# Altium project H3_PROTOTYPE_DDR3_16X2_V3_0_20141113.PrjPcb (part 1 of 2)
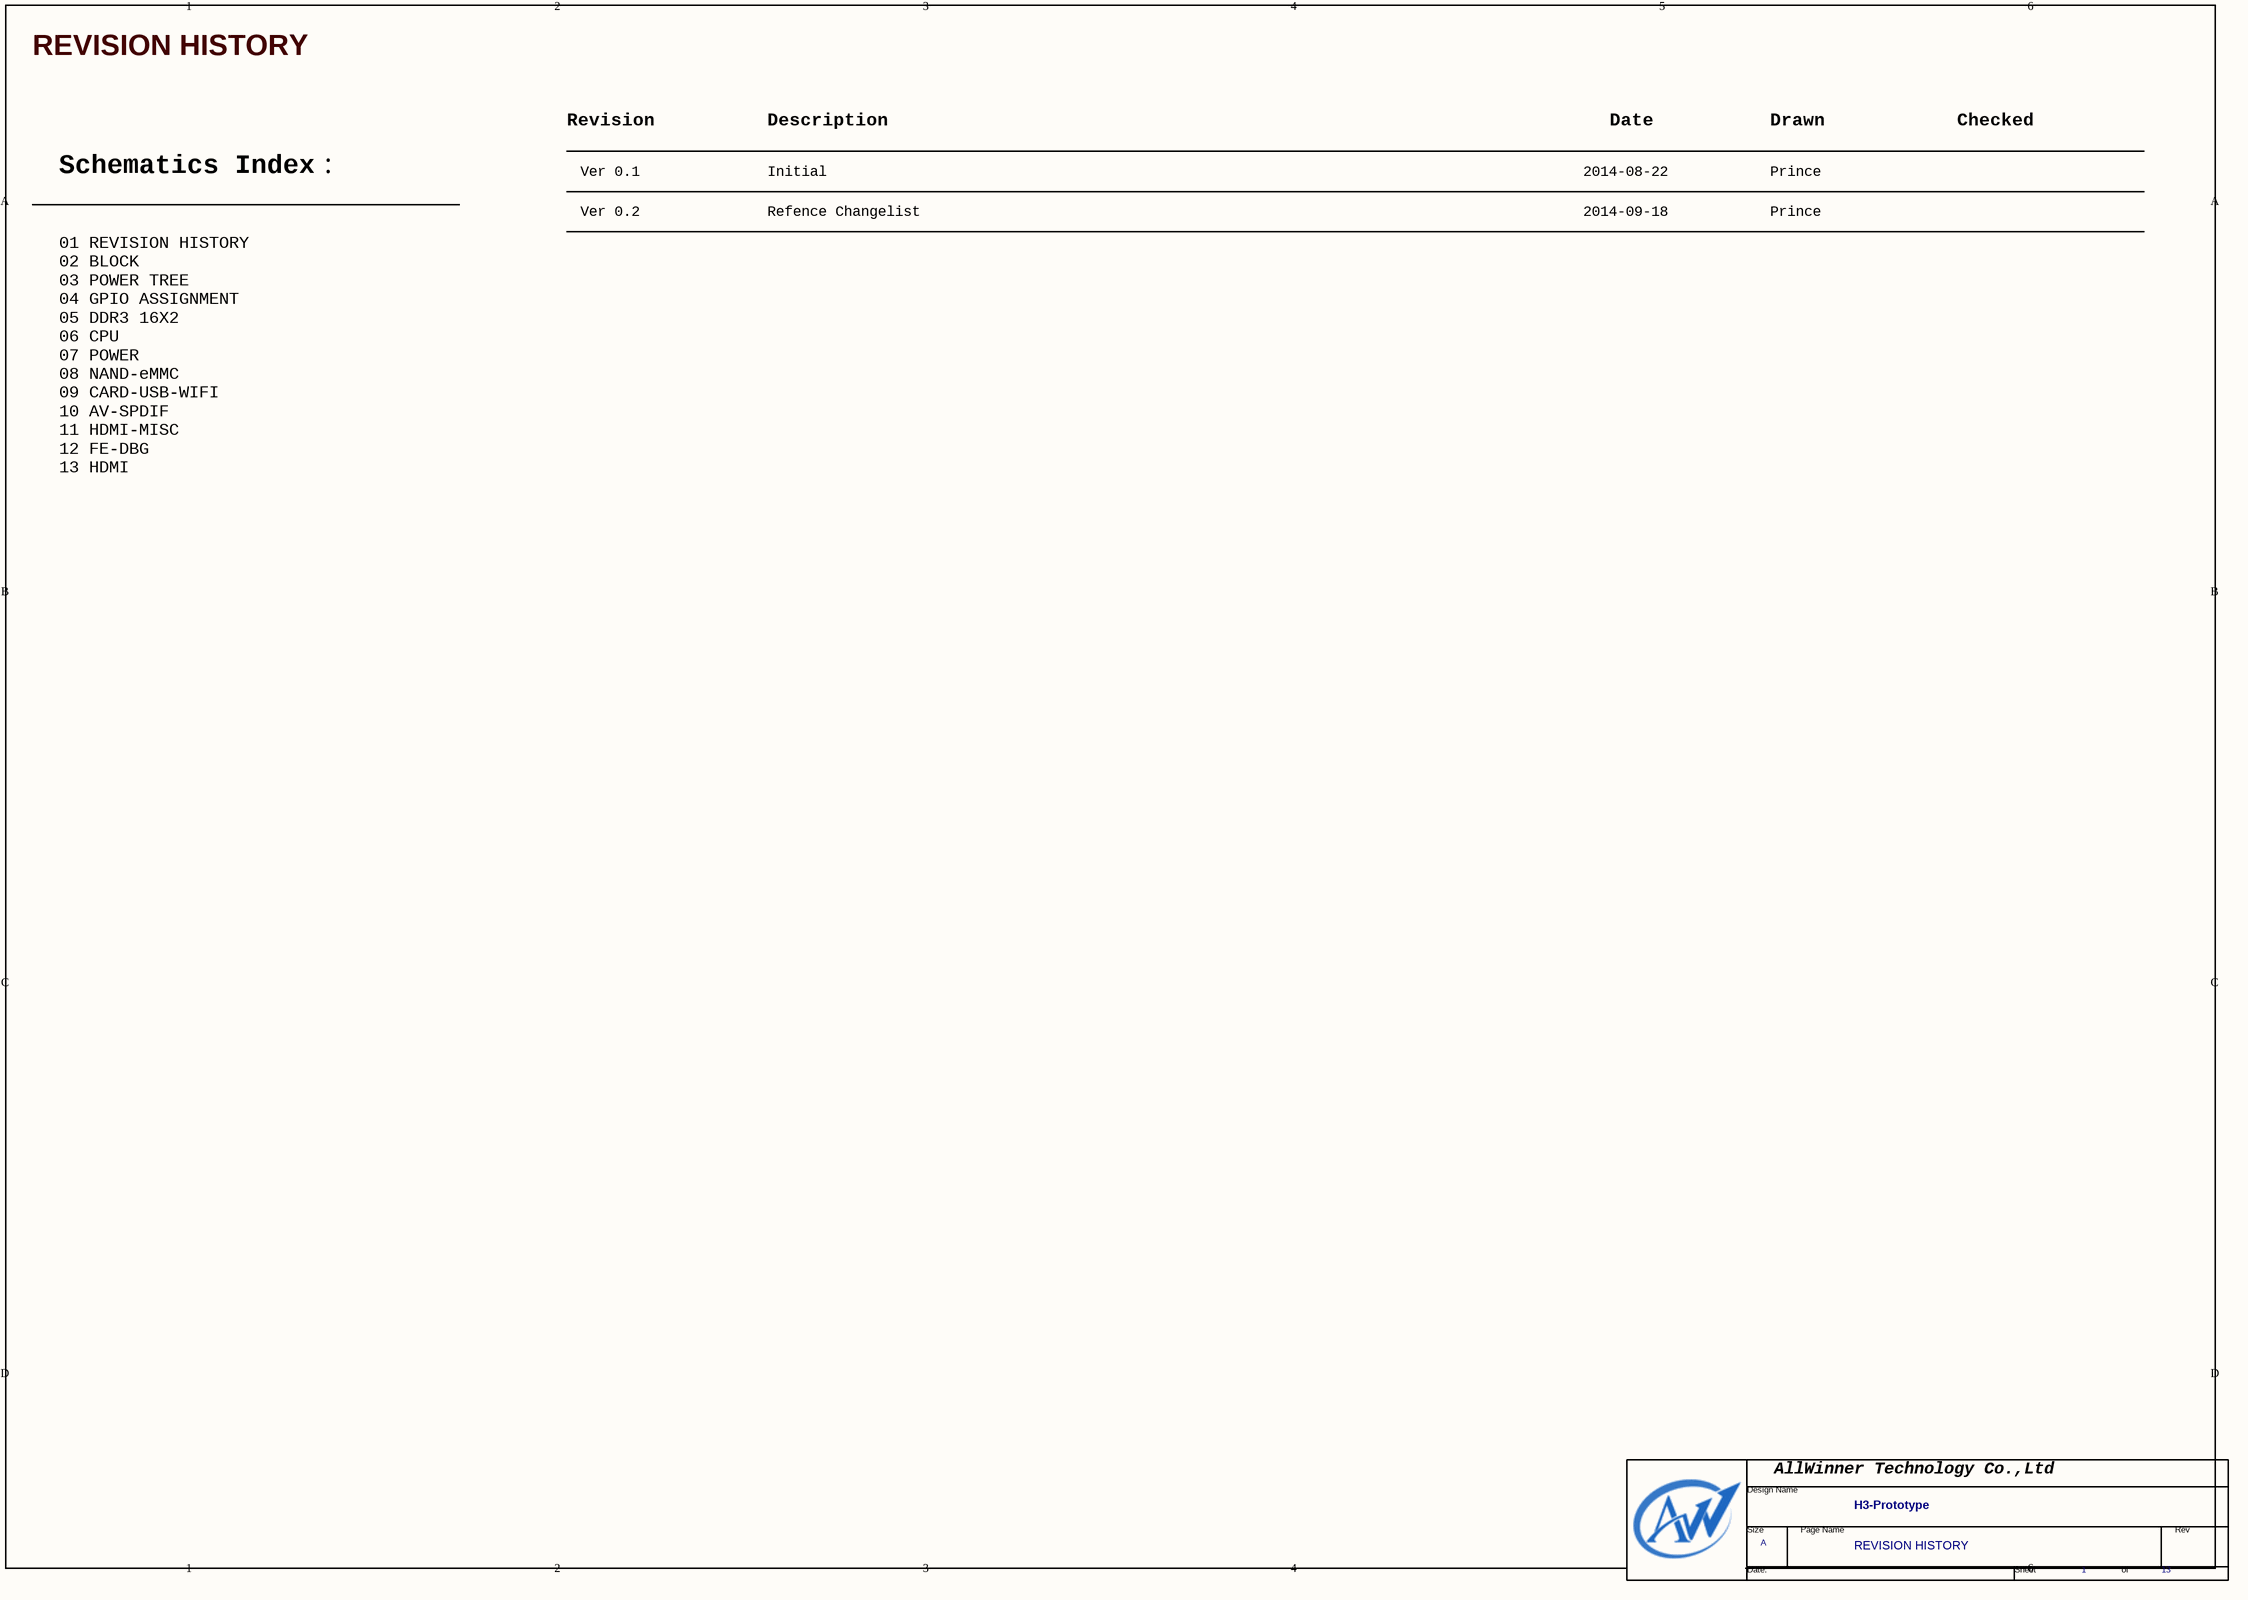
[diagram p0: 01 REVISION HISTORY.SchDoc]
13 sheets, 383 parts. Net scope: global (net labels, ports and power ports of the same name join across sheets).
Sheets:
  01 REVISION HISTORY.SchDoc
  02 BLOCK.SchDoc
  03 POWER TREE.SchDoc
  04 GPIO ASSIGNMENT.SchDoc
  05 DDR3 16X2.SchDoc
  06 CPU.SchDoc
  07 POWER.SchDoc
  08 NAND-eMMC.SchDoc
  09 CARD-USB-WIFI.SchDoc
  10 AV-SPDIF.SchDoc
  11 MISC.SchDoc
  12 FE-DBG.SchDoc
  13 HDMI.SchDoc

## Sheet 01 REVISION HISTORY.SchDoc
size 420 x 297 mm

### Parts
(Parts that share a designator on the sheet are numbered #1, #2 ... from top to bottom, then left to right.)
*#1  Page Count: 13  Page Number: 1  Page Size: A  Title: H3-Prototype  Doc: REVISION HISTORY  (hidden comment: TitleBlock0-AW)  (graphical)

### Notes on the sheet
- REVISION HISTORY
- Revision
- Description
- Date
- Drawn
- Checked
- Schematics Index：
- Ver 0.1
- Initial
- 2014-08-22
- Prince
- 01 REVISION HISTORY
  02 BLOCK
  03 POWER TREE
  04 GPIO ASSIGNMENT
  05 DDR3 16X2
  06 CPU
  07 POWER
  08 NAND-eMMC
  09 CARD-USB-WIFI
  10 AV-SPDIF
  11 HDMI-MISC
  12 FE-DBG
  13 HDMI
- Ver 0.2
- Refence Changelist
- 2014-09-18
- (in symbol TitleBlock0-AW) AllWinner Technology Co.,Ltd; Design Name; Size; Page Name; Rev; Date:; Sheet; of

### Library data of the parts
*#1 = TitleBlock0-AW: RevCode: 0.1; Page Create Date: March  8, 1995

## Sheet 02 BLOCK.SchDoc
size 420 x 297 mm
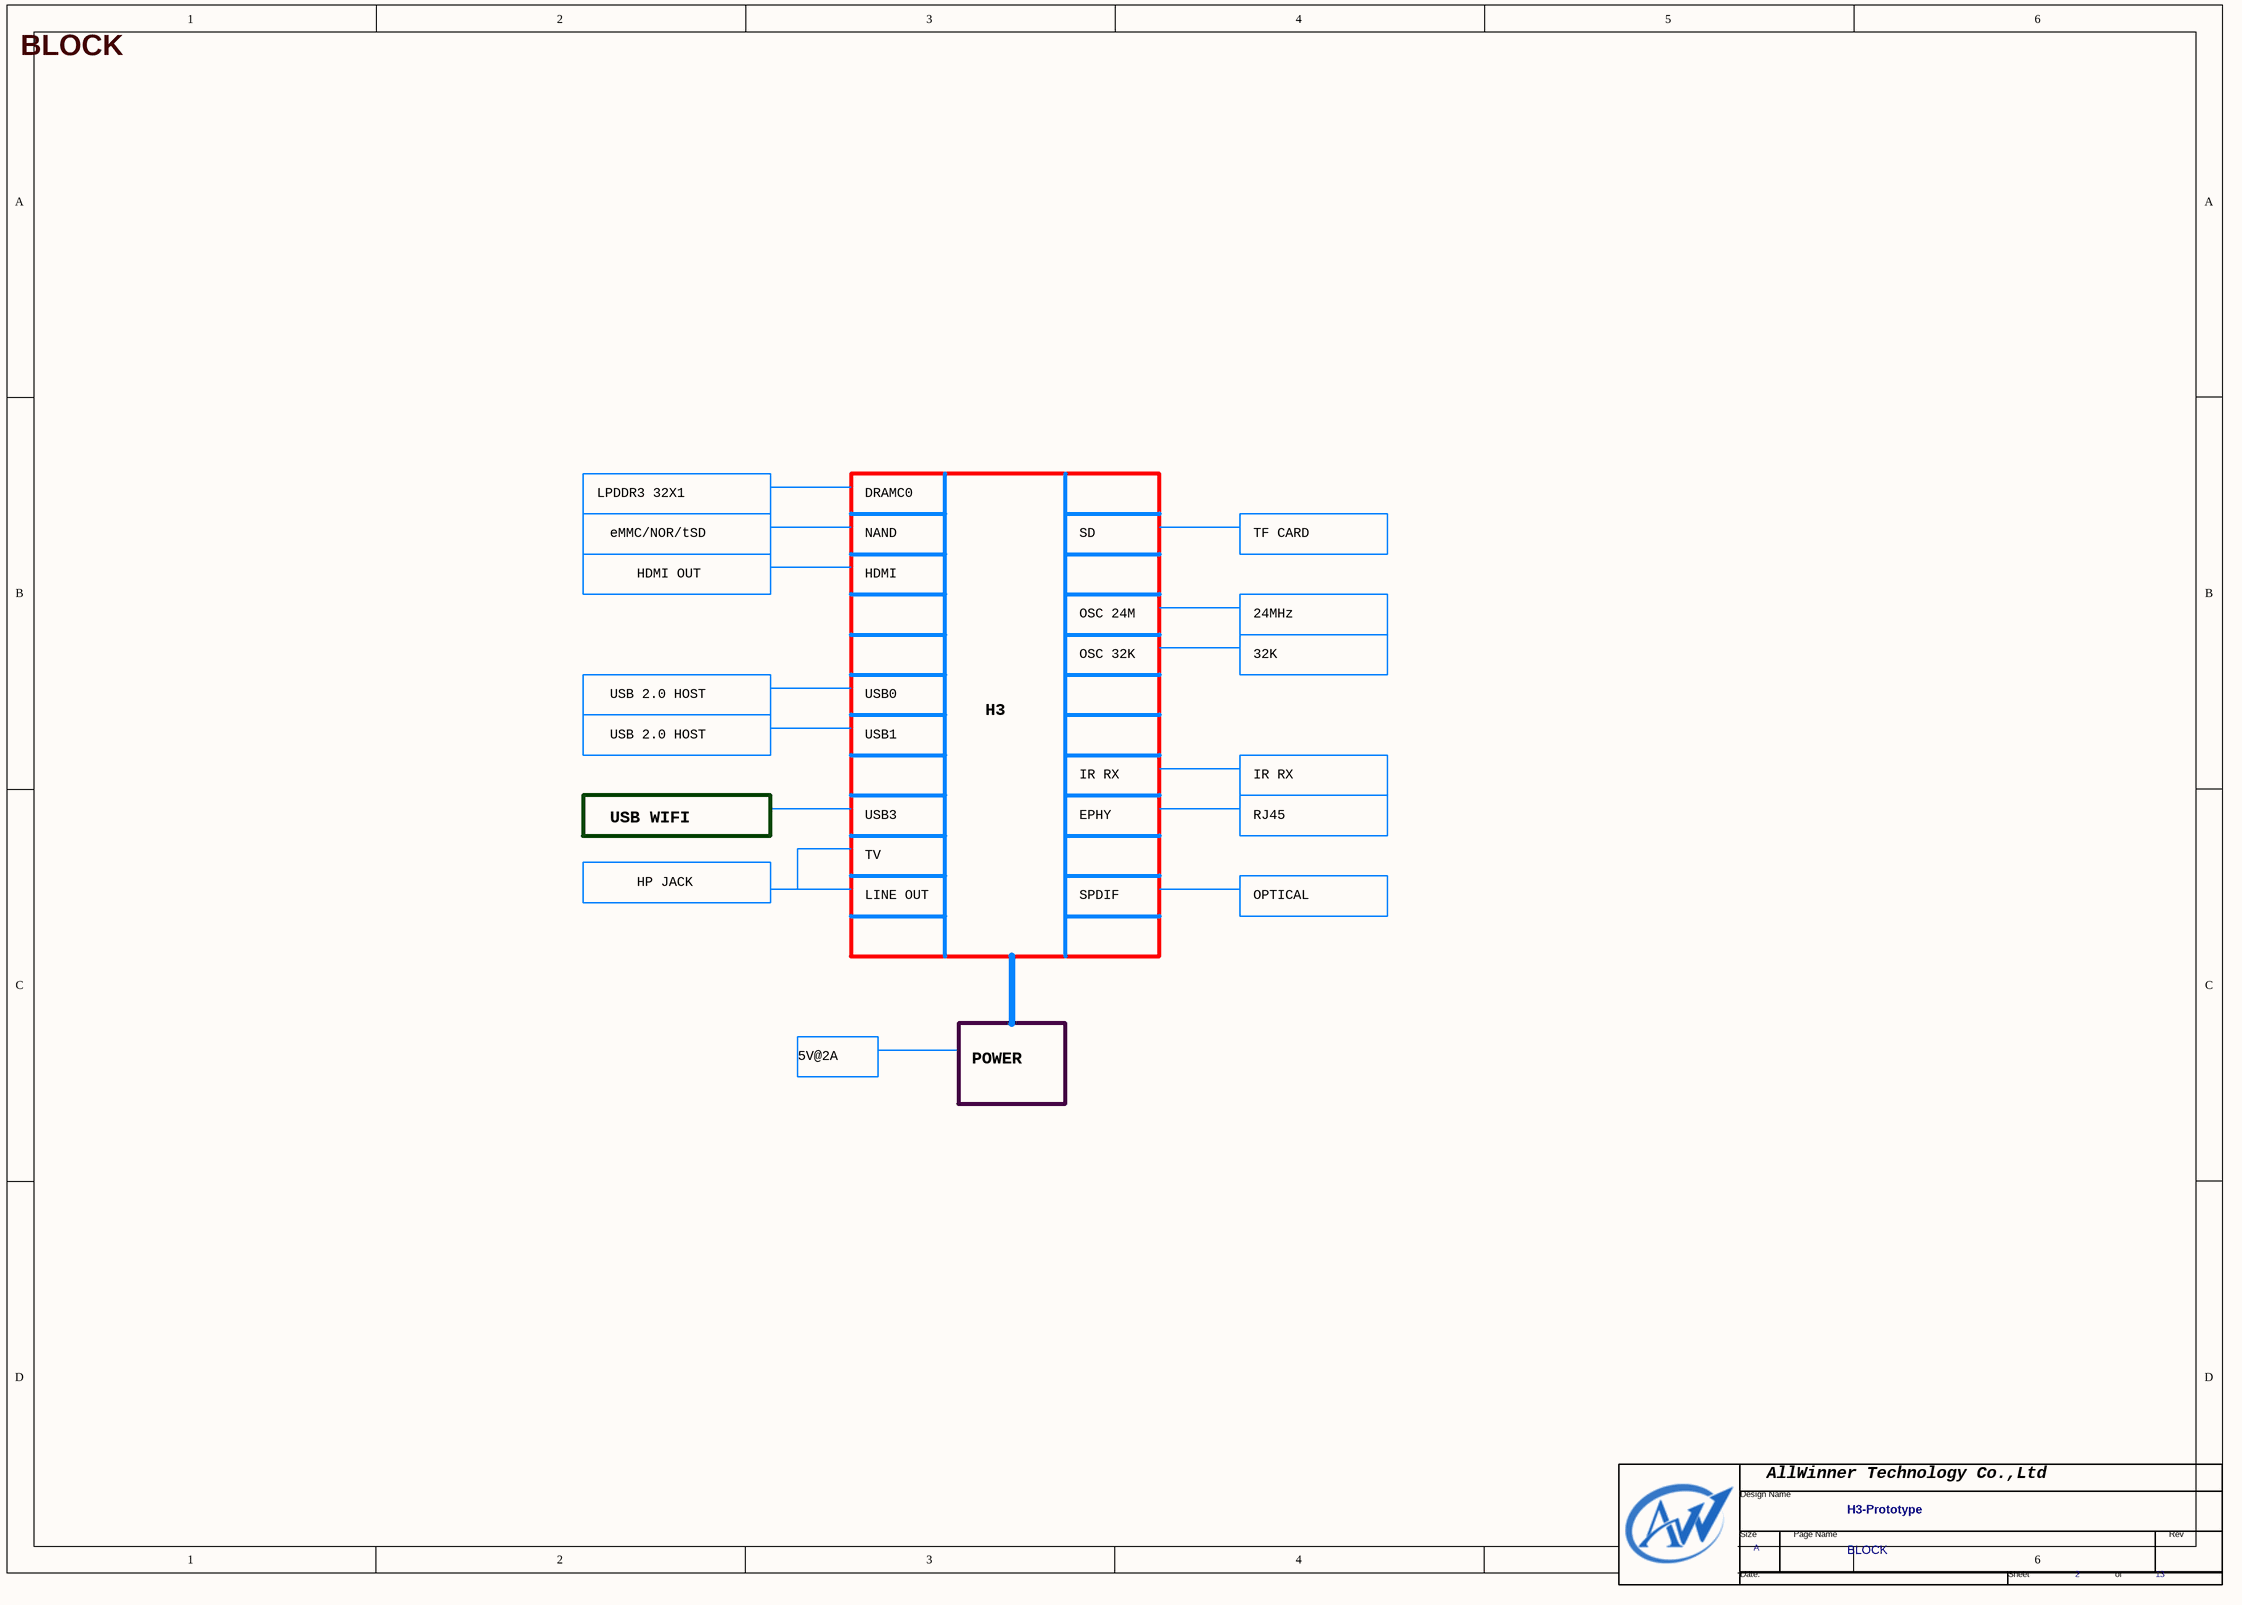
[diagram p1: 02 BLOCK.SchDoc]

### Parts
(Parts that share a designator on the sheet are numbered #1, #2 ... from top to bottom, then left to right.)
*#2  Page Count: 13  Page Number: 2  Page Size: A  Title: H3-Prototype  Doc: BLOCK  (hidden comment: TitleBlock0-AW)  (graphical)

### Notes on the sheet
- BLOCK
- LPDDR3 32X1
- DRAMC0
- eMMC/NOR/tSD
- HDMI OUT
- NAND
- HDMI
- SD
- TF CARD
- OSC 24M
- OSC 32K
- 24MHz
- 32K
- USB 2.0 HOST
- USB0
- H3
- USB1
- IR RX
- USB WIFI
- USB3
- TV
- EPHY
- RJ45
- HP JACK
- LINE OUT
- SPDIF
- OPTICAL
- 5V@2A
- POWER
- (in symbol TitleBlock0-AW) AllWinner Technology Co.,Ltd; Design Name; Size; Page Name; Rev; Date:; Sheet; of

### Library data of the parts
*#2 = TitleBlock0-AW: Page Create Date: March  8, 1995

## Sheet 03 POWER TREE.SchDoc
size 420 x 297 mm
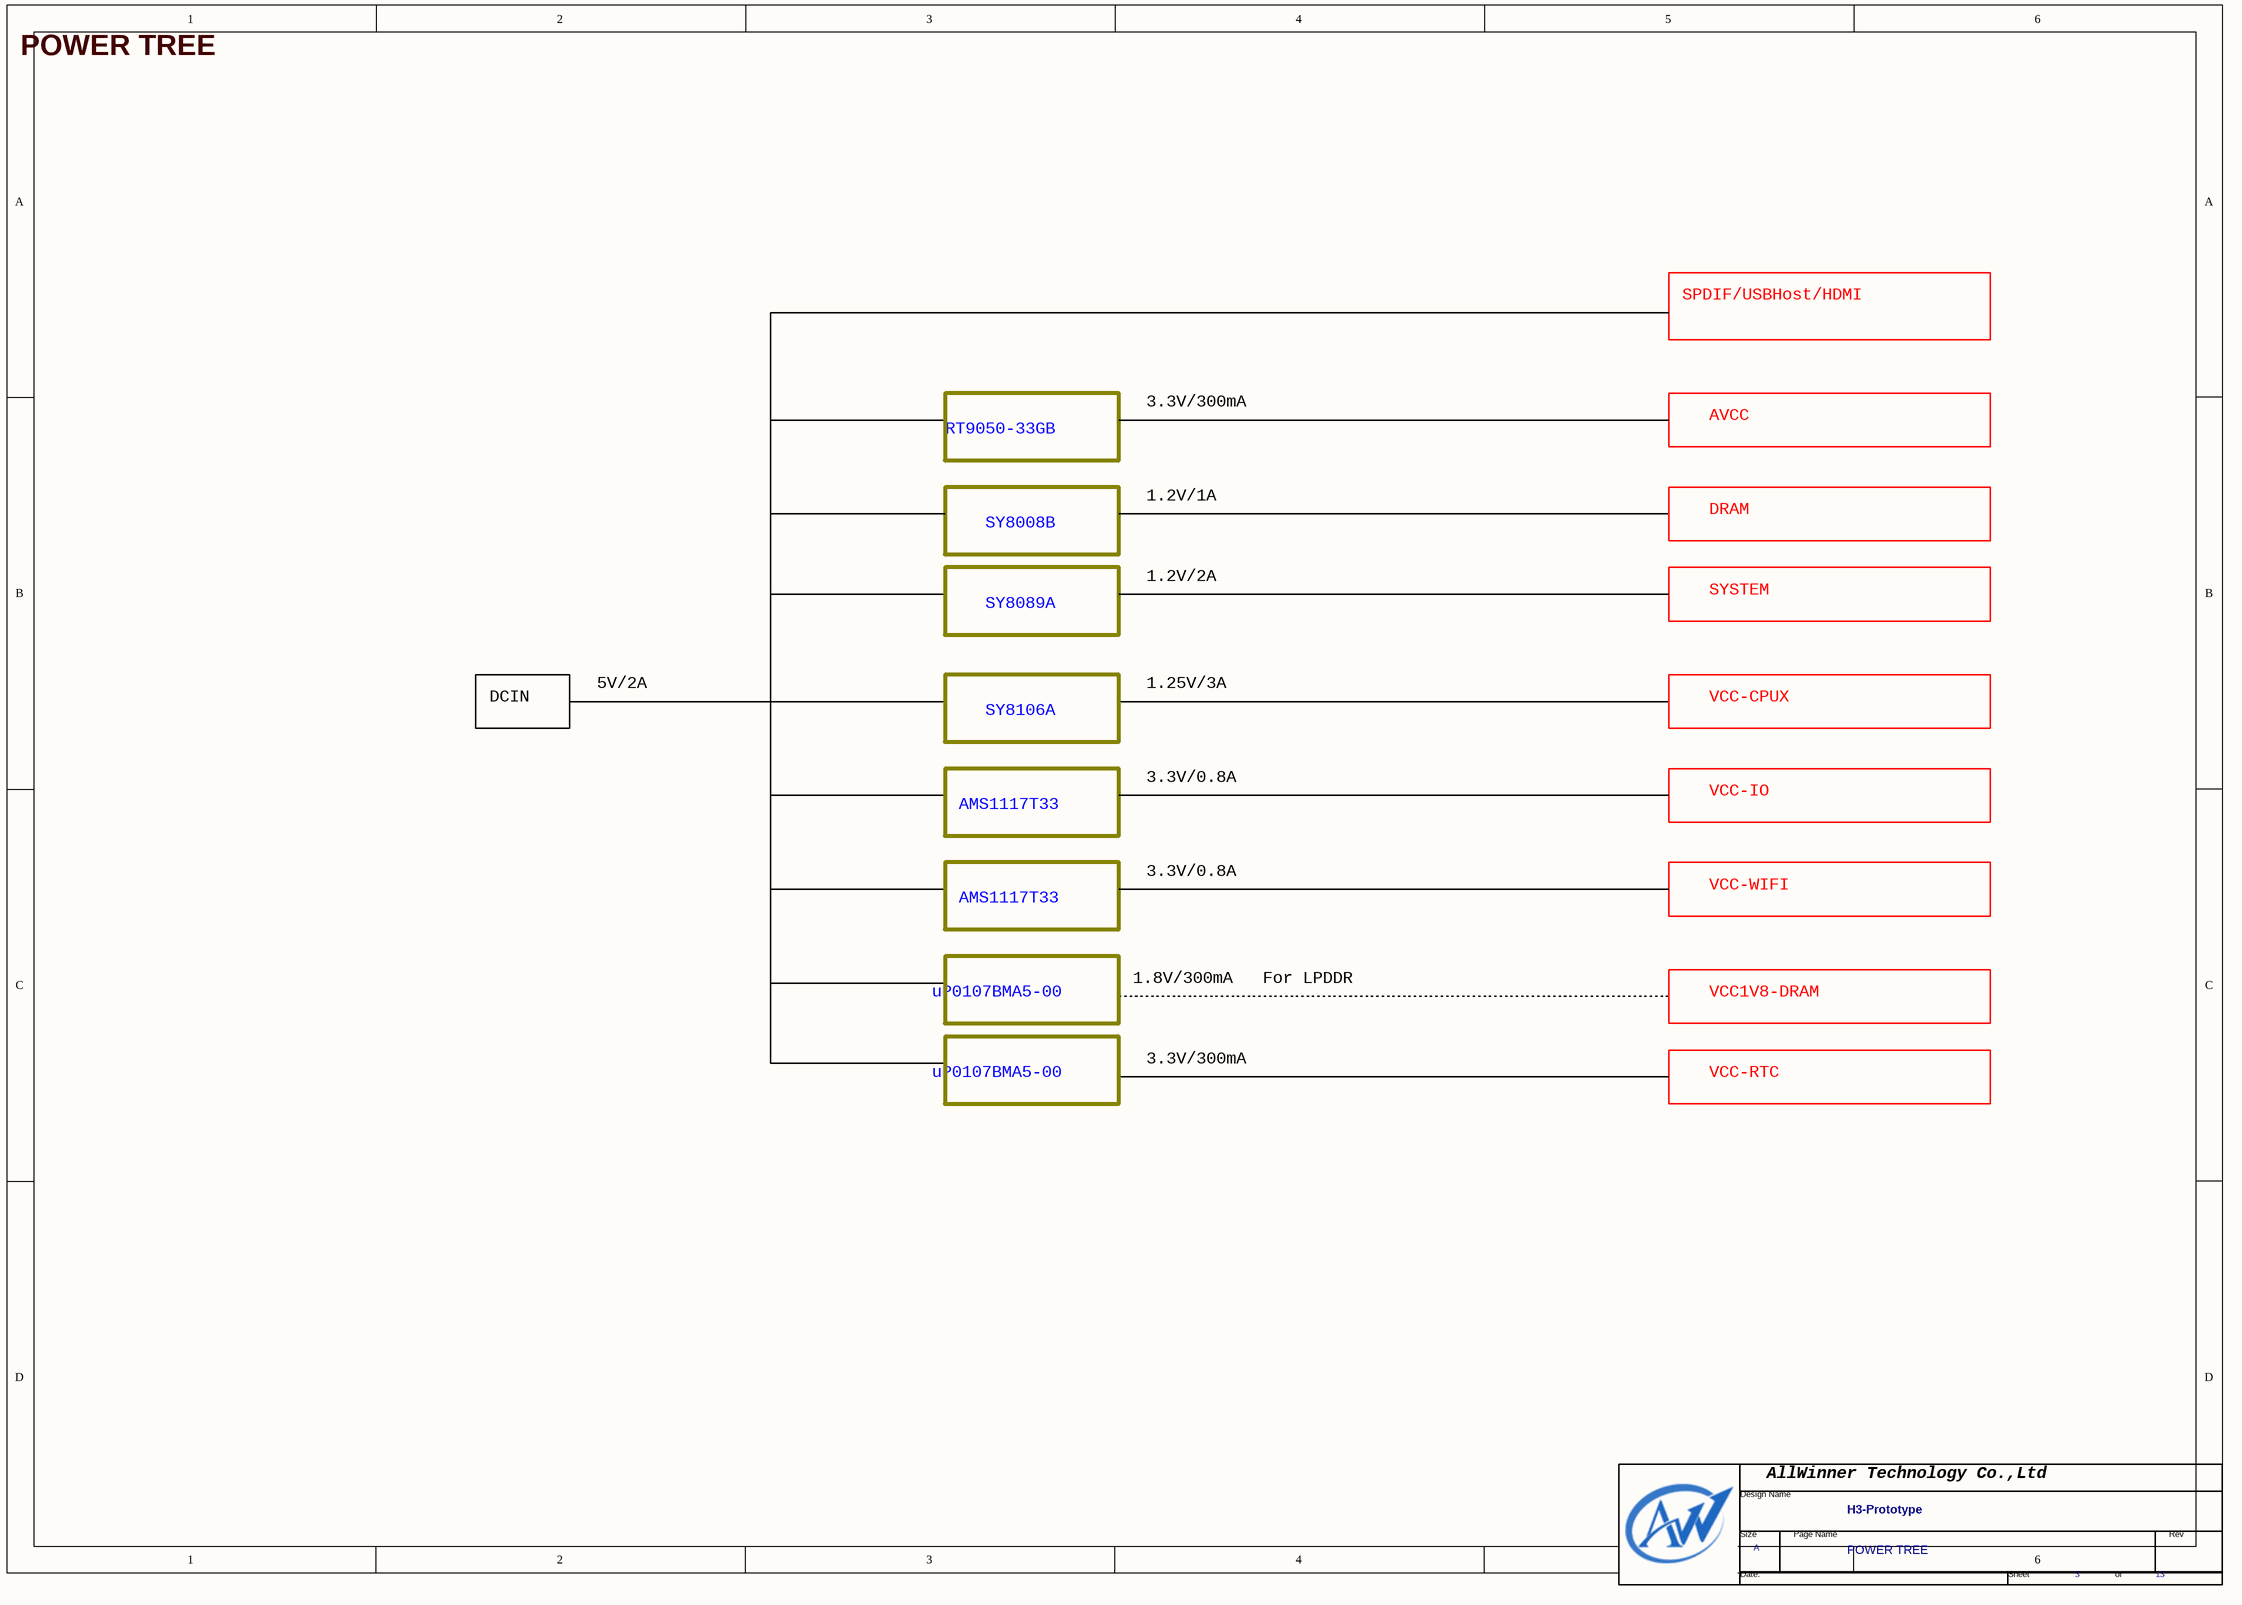
[diagram p2: 03 POWER TREE.SchDoc]

### Parts
(Parts that share a designator on the sheet are numbered #1, #2 ... from top to bottom, then left to right.)
*#3  Page Count: 13  Page Number: 3  Page Size: A  Title: H3-Prototype  Doc: POWER TREE  (hidden comment: TitleBlock0-AW)  (graphical)

### Notes on the sheet
- POWER TREE
- SPDIF/USBHost/HDMI
- RT9050-33GB
- 3.3V/300mA
- AVCC
- SY8008B
- 1.2V/1A
- DRAM
- 1.2V/2A
- SYSTEM
- SY8089A
- DCIN
- 5V/2A
- SY8106A
- 1.25V/3A
- VCC-CPUX
- 3.3V/0.8A
- VCC-IO
- AMS1117T33
- VCC-WIFI
- uP0107BMA5-00
- 1.8V/300mA   For LPDDR
- VCC1V8-DRAM
- VCC-RTC
- (in symbol TitleBlock0-AW) AllWinner Technology Co.,Ltd; Design Name; Size; Page Name; Rev; Date:; Sheet; of

### Library data of the parts
*#3 = TitleBlock0-AW: Page Create Date: March  8, 1995

## Sheet 04 GPIO ASSIGNMENT.SchDoc
size 420 x 297 mm
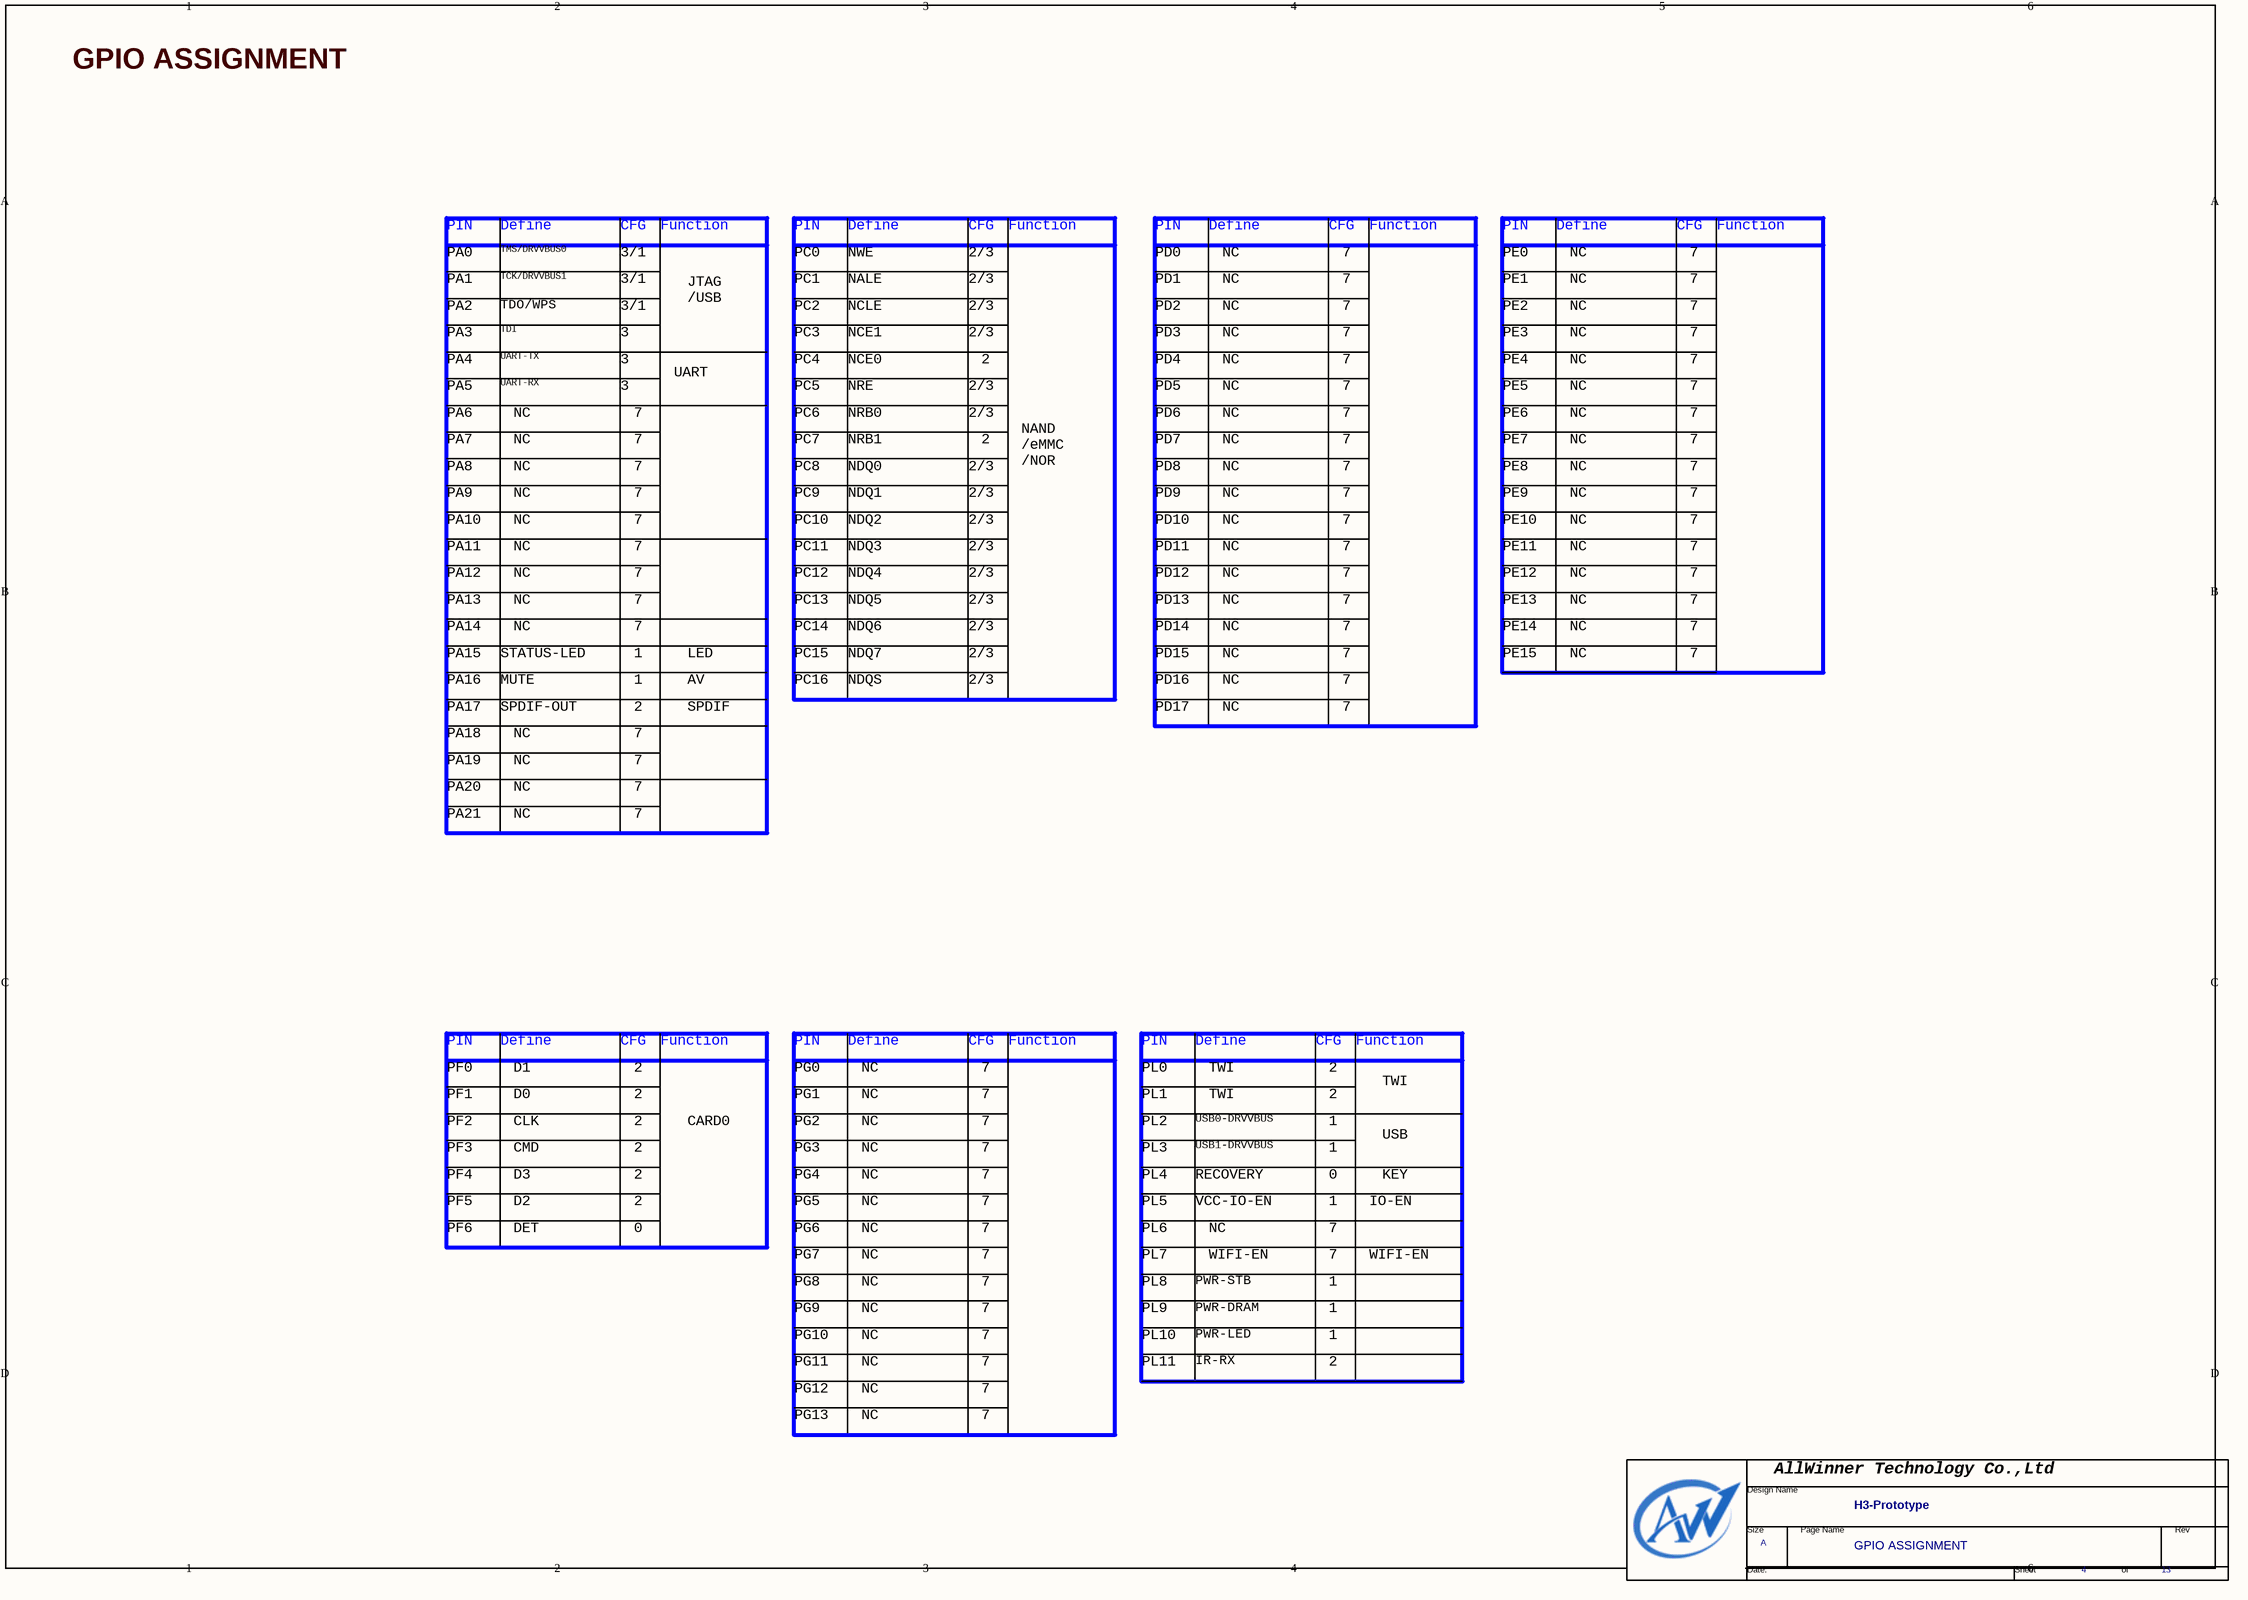
[diagram p3: 04 GPIO ASSIGNMENT.SchDoc]

### Parts
(Parts that share a designator on the sheet are numbered #1, #2 ... from top to bottom, then left to right.)
*#4  Page Count: 13  Page Number: 4  Page Size: A  Title: H3-Prototype  Doc: GPIO ASSIGNMENT  (hidden comment: TitleBlock0-AW)  (graphical)

### Notes on the sheet
- GPIO ASSIGNMENT
- PIN
- PA0
- Define
- TMS/DRVVBUS0
- CFG
- 3/1
- Function
- PC0
- NWE
- 2/3
- PD0
- NC
- 7
- PE0
- PA1
- PA2
- TCK/DRVVBUS1
- TDO/WPS
- JTAG
  /USB
- PC1
- PC2
- NALE
- NCLE
- PD1
- PD2
- PE1
- PE2
- PA3
- PA4
- PA5
- TDI
- UART-TX
- UART-RX
- 3
- UART
- PC3
- PC4
- PC5
- NCE1
- NCE0
- NRE
- 2
- PD3
- PD4
- PD5
- PE3
- PE4
- PE5
- PA6
- PA7
- PC6
- PC7
- NRB0
- NRB1
- NAND
  /eMMC
  /NOR
- PD6
- PD7
- PE6
- PE7
- PA8
- PA9
- PA10
- PC8
- PC9
- PC10
- NDQ1
- NDQ2
- NDQ0
- PD8
- PD9
- PD10
- PE8
- PE9
- PE10
- PA11
- PA12
- PC11
- PC12
- NDQ3
- NDQ4
- PD11
- PD12
- PE11
- PE12
- PA13
- PA14
- PA15
- STATUS-LED
- 1
- LED
- PC13
- PC14
- PC15
- NDQ5
- NDQ6
- NDQ7
- PD13
- PD14
- PD15
- PE13
- PE14
- PE15
- PA16
- PA17
- SPDIF-OUT
- MUTE
- SPDIF
- AV
- PC16
- NDQS
- PD16
- PD17
- PA18
- PA19
- PA20
- PA21
- PF0
- PF1
- PF2
- D0
- D1
- CLK
- CARD0
- PG0
- PG1
- PG2
- PL0
- PL1
- PL2
- USB0-DRVVBUS
- TWI
- PF3
- PF4
- D3
- CMD
- PG3
- PG4
- PL3
- PL4
- RECOVERY
- USB1-DRVVBUS
- 0
- KEY
- USB
- PF6
- PF5
- D2
- DET
- PG5
- PG6
- PG7
- PL5
- PL6
- PL7
- VCC-IO-EN
- WIFI-EN
- IO-EN
- PG8
- PG9
- PL8
- PL9
- PWR-DRAM
- PWR-STB
- PG10
- PG11
- PG12
- PL10
- PL11
- IR-RX
- PWR-LED
- PG13
- (in symbol TitleBlock0-AW) AllWinner Technology Co.,Ltd; Design Name; Size; Page Name; Rev; Date:; Sheet; of

### Library data of the parts
*#4 = TitleBlock0-AW: Page Create Date: March  8, 1995

## Sheet 05 DDR3 16X2.SchDoc
size 420 x 297 mm
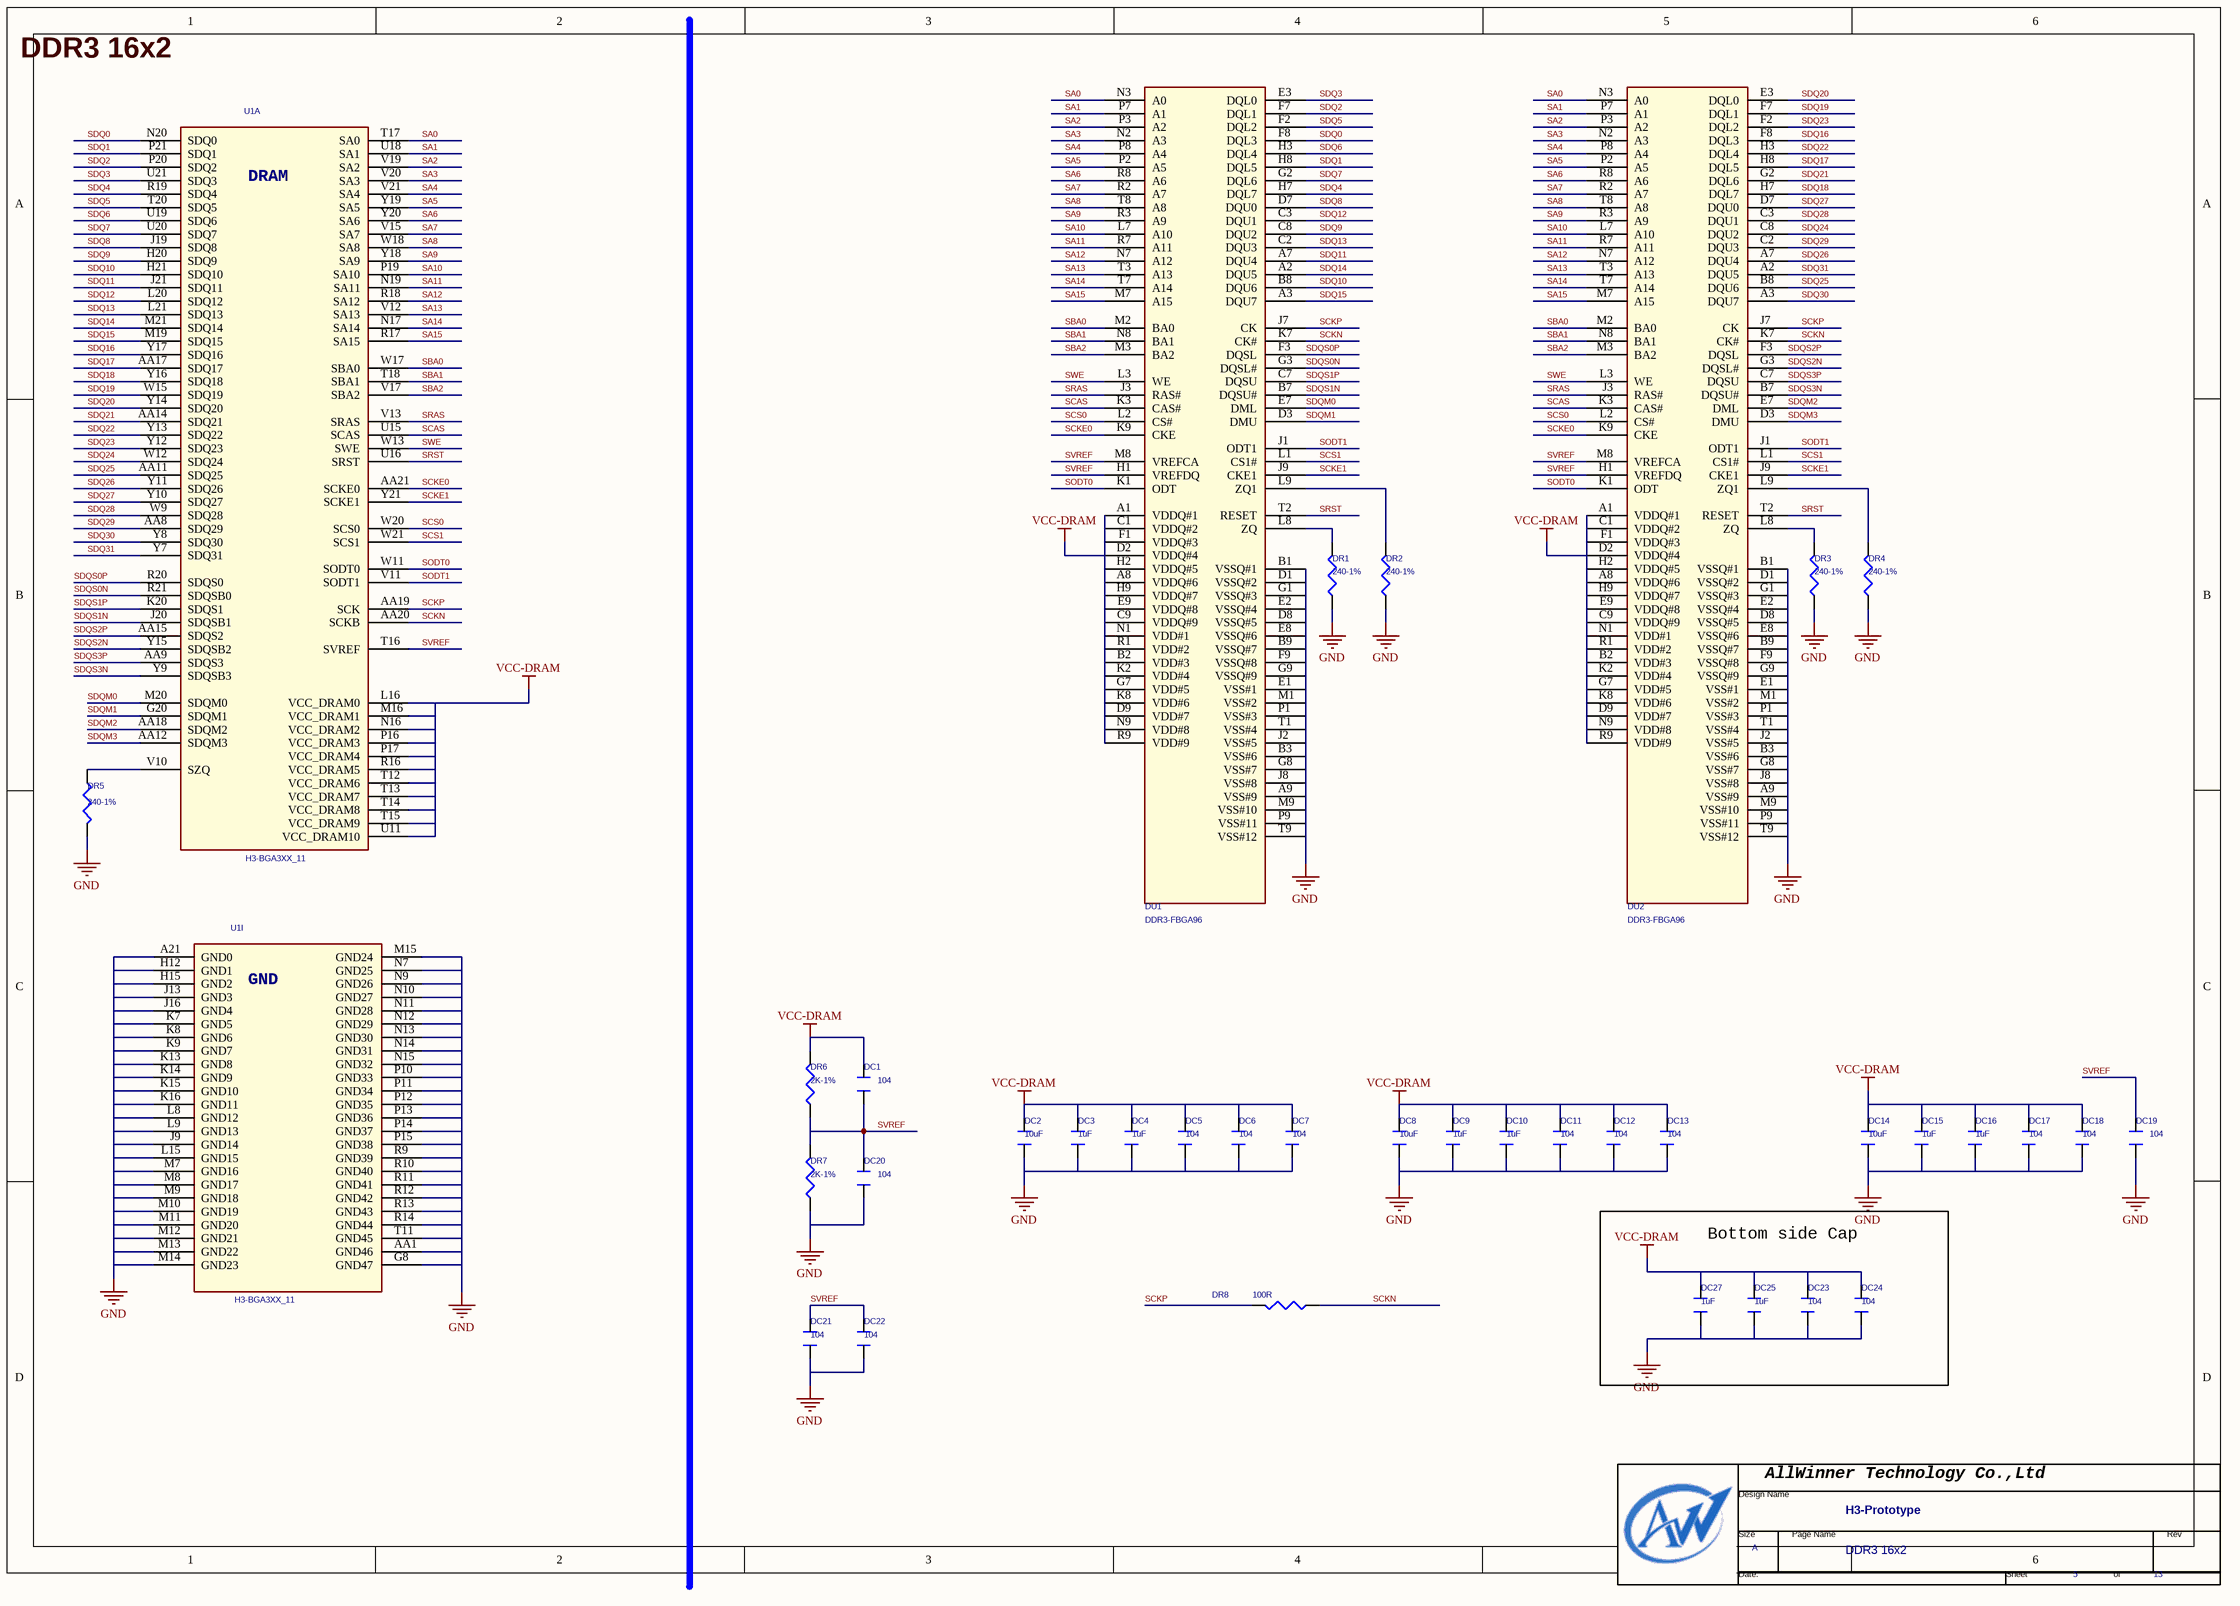
[diagram p4: 05 DDR3 16X2.SchDoc]

### Parts
(Parts that share a designator on the sheet are numbered #1, #2 ... from top to bottom, then left to right.)
*#5  Page Count: 13  Page Number: 5  Page Size: A  Title: H3-Prototype  Doc: DDR3 16x2  (hidden comment: TitleBlock0-AW)  (graphical)
DC1  104  [C0402]
DC2  10uF  [C0603]
DC3  1uF  [C0402]
DC4  1uF  [C0402]
DC5  104  [C0402]
DC6  104  [C0402]
DC7  104  [C0402]
DC8  10uF  [C0603]
DC9  1uF  [C0402]
DC10  1uF  [C0402]
DC11  104  [C0402]
DC12  104  [C0402]
DC13  104  [C0402]
DC14  10uF  [C0603]
DC15  1uF  [C0402]
DC16  1uF  [C0402]
DC17  104  [C0402]
DC18  104  [C0402]
DC19  104  [C0402]
DC20  104  [C0402]
DC21  104  [C0402]
DC22  104  [C0402]
DC23  104  [C0402]
DC24  104  [C0402]
DC25  1uF  [C0402]
DC27  1uF  [C0402]
DR1  240-1%  [R0402]
DR2  240-1%  [R0402]
DR3  240-1%  [R0402]
DR4  240-1%  [R0402]
DR5  240-1%  [R0402]
DR6  2K-1%  [R0402]
DR7  2K-1%  [R0402]
DR8  100R  [R0402]
DU1  DDR3-FBGA96  [FBGA96C80P9X13]
DU2  DDR3-FBGA96  [FBGA96C80P9X13]
U1  H3-BGA3XX_11  [BGA347P0_65B14X14]  (parts A,I of 9)

### Blocks framed on the sheet
Bottom side Cap: DC23-DC25 DC27

### Nets
GND: DC2.1 DC3.1 DC4.1 DC5.1 DC6.1 DC7.1 DC8.1 DC9.1 DC10.1 DC11.1 DC12.1 DC13.1 DC14.1 DC15.1 DC16.1 DC17.1 DC18.1 DC19.1 DC20.1 DC21.1 DC22.1 DC23.1 DC24.1 DC25.1 DC27.1 DR1.1 DR2.1 DR3.1 DR4.1 DR5.2 DR7.1 DU1.A9(VSS#9) DU1.B1(VSSQ#1) DU1.B3(VSS#6) DU1.B9(VSSQ#7) DU1.D1(VSSQ#2) DU1.D8(VSSQ#5) DU1.E1(VSS#1) DU1.E2(VSSQ#4) DU1.E8(VSSQ#6) DU1.F9(VSSQ#8) DU1.G1(VSSQ#3) DU1.G8(VSS#7) DU1.G9(VSSQ#9) DU1.J2(VSS#5) DU1.J8(VSS#8) DU1.M1(VSS#2) DU1.M9(VSS#10) DU1.P1(VSS#3) DU1.P9(VSS#11) DU1.T1(VSS#4) DU1.T9(VSS#12) DU2.A9(VSS#9) DU2.B1(VSSQ#1) DU2.B3(VSS#6) DU2.B9(VSSQ#7) DU2.D1(VSSQ#2) DU2.D8(VSSQ#5) DU2.E1(VSS#1) DU2.E2(VSSQ#4) DU2.E8(VSSQ#6) DU2.F9(VSSQ#8) DU2.G1(VSSQ#3) DU2.G8(VSS#7) DU2.G9(VSSQ#9) DU2.J2(VSS#5) DU2.J8(VSS#8) DU2.M1(VSS#2) DU2.M9(VSS#10) DU2.P1(VSS#3) DU2.P9(VSS#11) DU2.T1(VSS#4) DU2.T9(VSS#12) U1.A21(GND0) U1.AA1(GND46) U1.G8(GND47) U1.H12(GND1) U1.H15(GND2) U1.J9(GND14) U1.J13(GND3) U1.J16(GND4) U1.K7(GND5) U1.K8(GND6) U1.K9(GND7) U1.K13(GND8) U1.K14(GND9) U1.K15(GND10) U1.K16(GND11) U1.L8(GND12) U1.L9(GND13) U1.L15(GND15) U1.M7(GND16) U1.M8(GND17) U1.M9(GND18) U1.M10(GND19) U1.M11(GND20) U1.M12(GND21) U1.M13(GND22) U1.M14(GND23) U1.M15(GND24) U1.N7(GND25) U1.N9(GND26) U1.N10(GND27) U1.N11(GND28) U1.N12(GND29) U1.N13(GND30) U1.N14(GND31) U1.N15(GND32) U1.P10(GND33) U1.P11(GND34) U1.P12(GND35) U1.P13(GND36) U1.P14(GND37) U1.P15(GND38) U1.R9(GND39) U1.R10(GND40) U1.R11(GND41) U1.R12(GND42) U1.R13(GND43) U1.R14(GND44) U1.T11(GND45)
VCC-DRAM: DC1.2 DC2.2 DC3.2 DC4.2 DC5.2 DC6.2 DC7.2 DC8.2 DC9.2 DC10.2 DC11.2 DC12.2 DC13.2 DC14.2 DC15.2 DC16.2 DC17.2 DC18.2 DC23.2 DC24.2 DC25.2 DC27.2 DR6.2 DU1.A1(VDDQ#1) DU1.A8(VDDQ#6) DU1.B2(VDD#3) DU1.C1(VDDQ#2) DU1.C9(VDDQ#9) DU1.D2(VDDQ#4) DU1.D9(VDD#7) DU1.E9(VDDQ#8) DU1.F1(VDDQ#3) DU1.G7(VDD#5) DU1.H2(VDDQ#5) DU1.H9(VDDQ#7) DU1.K2(VDD#4) DU1.K8(VDD#6) DU1.N1(VDD#1) DU1.N9(VDD#8) DU1.R1(VDD#2) DU1.R9(VDD#9) DU2.A1(VDDQ#1) DU2.A8(VDDQ#6) DU2.B2(VDD#3) DU2.C1(VDDQ#2) DU2.C9(VDDQ#9) DU2.D2(VDDQ#4) DU2.D9(VDD#7) DU2.E9(VDDQ#8) DU2.F1(VDDQ#3) DU2.G7(VDD#5) DU2.H2(VDDQ#5) DU2.H9(VDDQ#7) DU2.K2(VDD#4) DU2.K8(VDD#6) DU2.N1(VDD#1) DU2.N9(VDD#8) DU2.R1(VDD#2) DU2.R9(VDD#9) U1.L16(VCC_DRAM0) U1.M16(VCC_DRAM1) U1.N16(VCC_DRAM2) U1.P16(VCC_DRAM3) U1.P17(VCC_DRAM4) U1.R16(VCC_DRAM5) U1.T12(VCC_DRAM6) U1.T13(VCC_DRAM7) U1.T14(VCC_DRAM8) U1.T15(VCC_DRAM9) U1.U11(VCC_DRAM10)
SA0: DU1.N3(A0) DU2.N3(A0) U1.T17(SA0)
SA1: DU1.P7(A1) DU2.P7(A1) U1.U18(SA1)
SA2: DU1.P3(A2) DU2.P3(A2) U1.V19(SA2)
SA3: DU1.N2(A3) DU2.N2(A3) U1.V20(SA3)
SA4: DU1.P8(A4) DU2.P8(A4) U1.V21(SA4)
SA5: DU1.P2(A5) DU2.P2(A5) U1.Y19(SA5)
SA6: DU1.R8(A6) DU2.R8(A6) U1.Y20(SA6)
SA7: DU1.R2(A7) DU2.R2(A7) U1.V15(SA7)
SA8: DU1.T8(A8) DU2.T8(A8) U1.W18(SA8)
SA9: DU1.R3(A9) DU2.R3(A9) U1.Y18(SA9)
SA10: DU1.L7(A10) DU2.L7(A10) U1.P19(SA10)
SA11: DU1.R7(A11) DU2.R7(A11) U1.N19(SA11)
SA12: DU1.N7(A12) DU2.N7(A12) U1.R18(SA12)
SA13: DU1.T3(A13) DU2.T3(A13) U1.V12(SA13)
SA14: DU1.T7(A14) DU2.T7(A14) U1.N17(SA14)
SA15: DU1.M7(A15) DU2.M7(A15) U1.R17(SA15)
SBA0: DU1.M2(BA0) DU2.M2(BA0) U1.W17(SBA0)
SBA1: DU1.N8(BA1) DU2.N8(BA1) U1.T18(SBA1)
SBA2: DU1.M3(BA2) DU2.M3(BA2) U1.V17(SBA2)
SCAS: DU1.K3(CAS#) DU2.K3(CAS#) U1.U15(SCAS)
SCKE0: DU1.K9(CKE) DU2.K9(CKE) U1.AA21(SCKE0)
SCKE1: DU1.J9(CKE1) DU2.J9(CKE1) U1.Y21(SCKE1)
SCKN: DR8.1 DU1.K7(CK#) DU2.K7(CK#) U1.AA20(SCKB)
SCKP: DR8.2 DU1.J7(CK) DU2.J7(CK) U1.AA19(SCK)
SCS0: DU1.L2(CS#) DU2.L2(CS#) U1.W20(SCS0)
SCS1: DU1.L1(CS1#) DU2.L1(CS1#) U1.W21(SCS1)
SDQ0: DU1.F8(DQL3) U1.N20(SDQ0)
SDQ1: DU1.H8(DQL5) U1.P21(SDQ1)
SDQ2: DU1.F7(DQL1) U1.P20(SDQ2)
SDQ3: DU1.E3(DQL0) U1.U21(SDQ3)
SDQ4: DU1.H7(DQL7) U1.R19(SDQ4)
SDQ5: DU1.F2(DQL2) U1.T20(SDQ5)
SDQ6: DU1.H3(DQL4) U1.U19(SDQ6)
SDQ7: DU1.G2(DQL6) U1.U20(SDQ7)
SDQ8: DU1.D7(DQU0) U1.J19(SDQ8)
SDQ9: DU1.C8(DQU2) U1.H20(SDQ9)
SDQ10: DU1.B8(DQU6) U1.H21(SDQ10)
SDQ11: DU1.A7(DQU4) U1.J21(SDQ11)
SDQ12: DU1.C3(DQU1) U1.L20(SDQ12)
SDQ13: DU1.C2(DQU3) U1.L21(SDQ13)
SDQ14: DU1.A2(DQU5) U1.M21(SDQ14)
SDQ15: DU1.A3(DQU7) U1.M19(SDQ15)
SDQ16: DU2.F8(DQL3) U1.Y17(SDQ16)
SDQ17: DU2.H8(DQL5) U1.AA17(SDQ17)
SDQ18: DU2.H7(DQL7) U1.Y16(SDQ18)
SDQ19: DU2.F7(DQL1) U1.W15(SDQ19)
SDQ20: DU2.E3(DQL0) U1.Y14(SDQ20)
SDQ21: DU2.G2(DQL6) U1.AA14(SDQ21)
SDQ22: DU2.H3(DQL4) U1.Y13(SDQ22)
SDQ23: DU2.F2(DQL2) U1.Y12(SDQ23)
SDQ24: DU2.C8(DQU2) U1.W12(SDQ24)
SDQ25: DU2.B8(DQU6) U1.AA11(SDQ25)
SDQ26: DU2.A7(DQU4) U1.Y11(SDQ26)
SDQ27: DU2.D7(DQU0) U1.Y10(SDQ27)
SDQ28: DU2.C3(DQU1) U1.W9(SDQ28)
SDQ29: DU2.C2(DQU3) U1.AA8(SDQ29)
SDQ30: DU2.A3(DQU7) U1.Y8(SDQ30)
SDQ31: DU2.A2(DQU5) U1.Y7(SDQ31)
SDQM0: DU1.E7(DML) U1.M20(SDQM0)
SDQM1: DU1.D3(DMU) U1.G20(SDQM1)
SDQM2: DU2.E7(DML) U1.AA18(SDQM2)
SDQM3: DU2.D3(DMU) U1.AA12(SDQM3)
SDQS0N: DU1.G3(DQSL#) U1.R21(SDQSB0)
SDQS0P: DU1.F3(DQSL) U1.R20(SDQS0)
SDQS1N: DU1.B7(DQSU#) U1.J20(SDQSB1)
SDQS1P: DU1.C7(DQSU) U1.K20(SDQS1)
SDQS2N: DU2.G3(DQSL#) U1.Y15(SDQSB2)
SDQS2P: DU2.F3(DQSL) U1.AA15(SDQS2)
SDQS3N: DU2.B7(DQSU#) U1.Y9(SDQSB3)
SDQS3P: DU2.C7(DQSU) U1.AA9(SDQS3)
SODT0: DU1.K1(ODT) DU2.K1(ODT) U1.W11(SODT0)
SODT1: DU1.J1(ODT1) DU2.J1(ODT1) U1.V11(SODT1)
SRAS: DU1.J3(RAS#) DU2.J3(RAS#) U1.V13(SRAS)
SRST: DU1.T2(RESET) DU2.T2(RESET) U1.U16(SRST)
SVREF: DC1.1 DC19.2 DC20.2 DC21.2 DC22.2 DR6.1 DR7.2 DU1.H1(VREFDQ) DU1.M8(VREFCA) DU2.H1(VREFDQ) DU2.M8(VREFCA) U1.T16(SVREF)
SWE: DU1.L3(WE) DU2.L3(WE) U1.W13(SWE)
NetDR1_2: DR1.2 DU1.L8(ZQ)
NetDR2_2: DR2.2 DU1.L9(ZQ1)
NetDR3_2: DR3.2 DU2.L8(ZQ)
NetDR4_2: DR4.2 DU2.L9(ZQ1)
NetDR5_1: DR5.1 U1.V10(SZQ)

### Notes on the sheet
- DDR3 16x2
- (in symbol H3-BGA3XX_12, part A) DRAM
- (in symbol H3-BGA3XX_12, part I) GND
- (in symbol TitleBlock0-AW) AllWinner Technology Co.,Ltd; Design Name; Size; Page Name; Rev; Date:; Sheet; of

### Library data of the parts
DC1 DC19 DC20 = CAPACITOR_0_Dup4: PAGE: 1
DC2-DC18 DC21-DC25 DC27 = CAPACITOR_0_Dup5: PAGE: 2
DR1-DR5 DR8 = R_Dup4
DR6 DR7 = ?_0
DU1 DU2 = DDR3_1
U1 = H3-BGA3XX_12
*#5 = TitleBlock0-AW: Page Create Date: March  8, 1995

## Sheet 06 CPU.SchDoc
size 420 x 297 mm
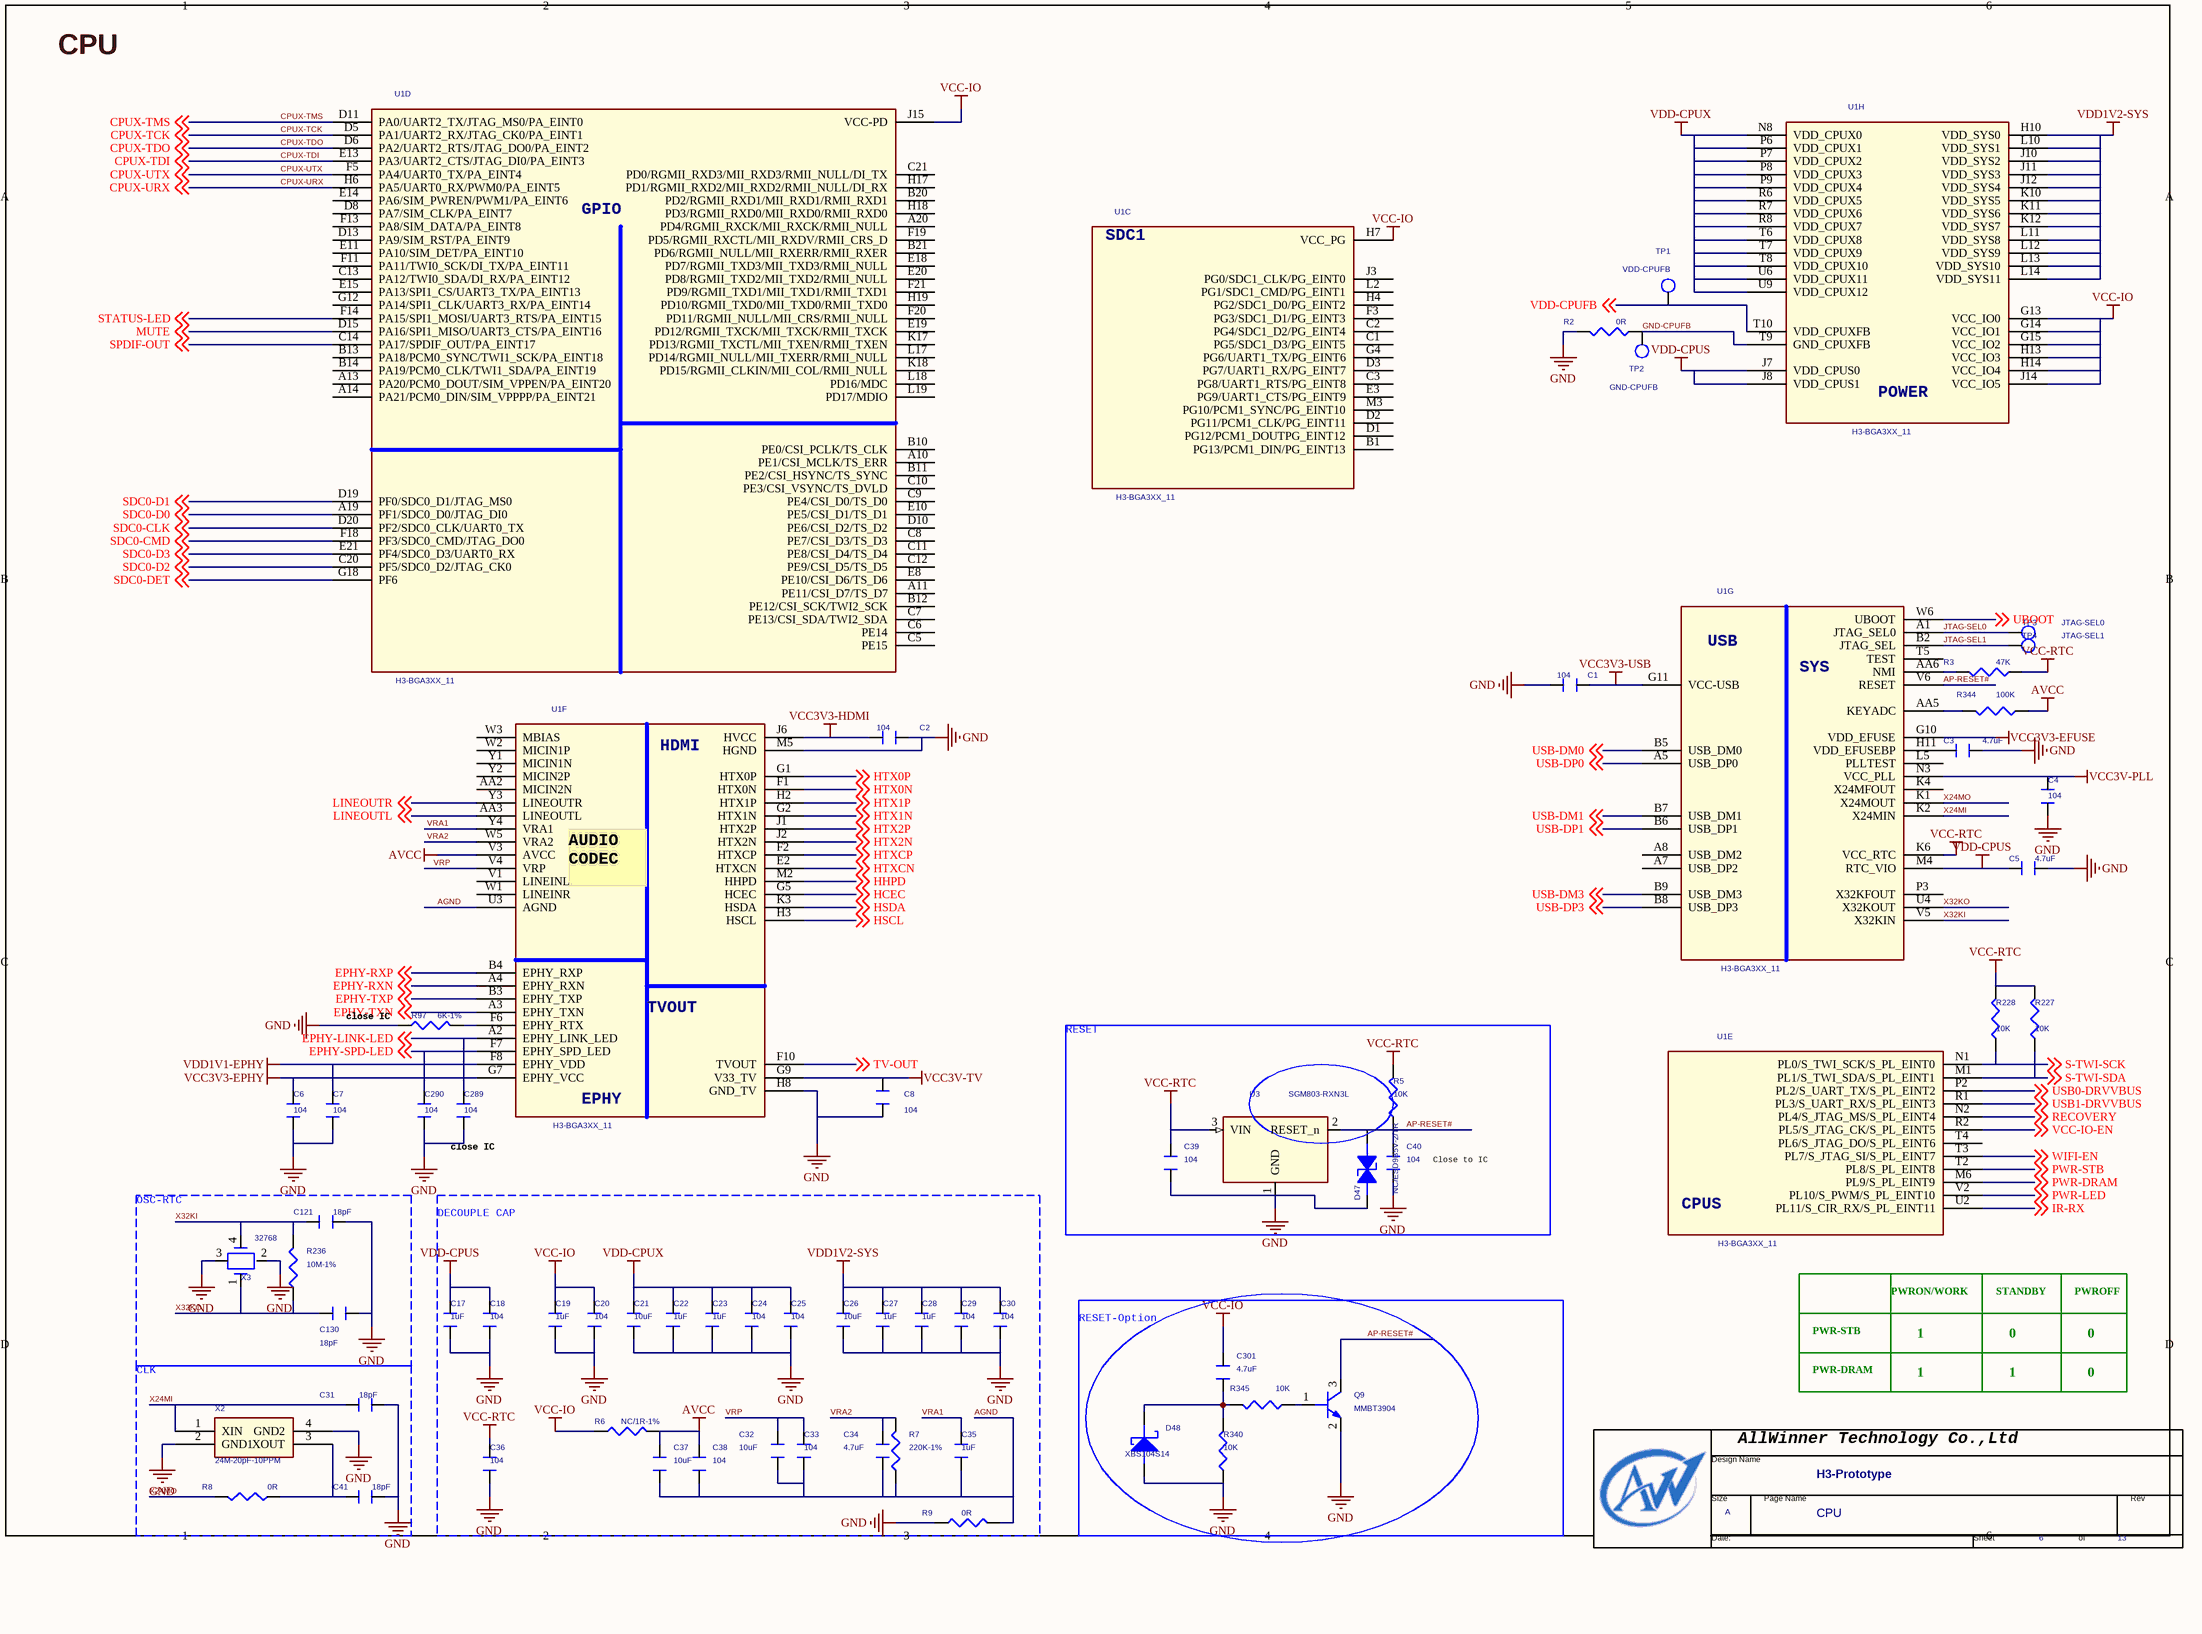
[diagram p5: 06 CPU.SchDoc]

### Parts
(Parts that share a designator on the sheet are numbered #1, #2 ... from top to bottom, then left to right.)
*#6  Page Count: 13  Page Number: 6  Page Size: A  Title: H3-Prototype  Doc: CPU  (hidden comment: TitleBlock0-AW)  (graphical)
C1  104  [C0402]
C2  104  [C0402]
C3  4.7uF  [C0402]
C4  104  [C0402]
C5  4.7uF  [C0402]
C6  104  [C0402]
C7  104  [C0402]
C8  104  [C0402]
C17  1uF  [C0402]
C18  104  [C0402]
C19  1uF  [C0402]
C20  104  [C0402]
C21  10uF  [C0603]
C22  1uF  [C0402]
C23  1uF  [C0402]
C24  104  [C0402]
C25  104  [C0402]
C26  10uF  [C0603]
C27  1uF  [C0402]
C28  1uF  [C0402]
C29  104  [C0402]
C30  104  [C0402]
C31  18pF  [C0402]
C32  10uF  [C0603]
C33  104  [C0402]
C34  4.7uF  [C0402]
C35  1uF  [C0402]
C36  104  [C0402]
C37  10uF  [C0603]
C38  104  [C0402]
C39  104  [C0402]
C40  104  [C0402]
C41  18pF  [C0402]
C121  18pF  [C0402]
C130  18pF  [C0402]
C289  104  [C0402]
C290  104  [C0402]
C301  4.7uF  [C0402]
D47  NC/ESD9B5V-2/TR  [C0402]
D48  XBS104S14  [SOD123]
Q9  MMBT3904  [SOT-23]
R2  0R  [R0402]
R3  47K  [R0402]
R5  10K  [0805]
R6  NC/1R-1%  [R0402]
R7  220K-1%  [R0402]
R8  0R  [R0402]
R9  0R  [R0402]
R97  6K-1%  [0805]
R227  10K  [R0402]
R228  10K  [R0402]
R236  10M-1%  [R0402]
R340  10K  [0805]
R344  100K  [R0402]
R345  10K  [0805]
TP1  VDD-CPUFB  [TP_SMD]
TP2  GND-CPUFB  [TP_SMD]
TP3  JTAG-SEL0  [TP_SMD]
TP4  JTAG-SEL1  [TP_SMD]
U1  H3-BGA3XX_11  [BGA347P0_65B14X14]  (parts C,D,E,F,G,H of 9)
U3  SGM803-RXN3L  [SOT-23]
X2  24M-20pF-10PPM  [CRY-3225]
X3  32768  [XCOL-3]

### Blocks framed on the sheet
RESET: C39 C40 D47 R5 U3
DECOUPLE CAP: C17-C30 C32-C38 R6 R7 R9
RESET-Option: C301 D48 Q9 R340 R345

### Nets
AVCC: C37.2 C38.2 R6.2 R344.1 U1.V3(AVCC)
GND: C1.1 C2.2 C3.2 C4.1 C5.2 C6.1 C7.1 C8.2 C17.1 C18.1 C19.1 C20.1 C21.1 C22.1 C23.1 C24.1 C25.1 C26.1 C27.1 C28.1 C29.1 C30.1 C31.1 C36.1 C39.1 C40.1 C41.1 C121.1 C130.1 C289.1 C290.1 D47.2(CATHODE) D48.A Q9.2(E) R2.2 R9.1 R97.1 R340.1 U1.H8(GND_TV) U1.M5(HGND) U3.1(GND) X2.2(GND1) X2.4(GND2) X3.2 X3.3(Shield)
VCC3V-PLL: C4.2 U1.N3(VCC_PLL)
VCC3V-TV: C8.1 U1.G9(V33_TV)
VCC-IO: C1.2 C2.1 C6.2 C19.2 C20.2 C301.2 R6.1 U1.G7(EPHY_VCC) U1.G10(VDD_EFUSE) U1.G11(VCC-USB) U1.G13(VCC_IO0) U1.G14(VCC_IO1) U1.G15(VCC_IO2) U1.H7(VCC_PG) U1.H13(VCC_IO3) U1.H14(VCC_IO4) U1.J6(HVCC) U1.J14(VCC_IO5) U1.J15(VCC-PD)  [also labelled VCC3V3-EFUSE, VCC3V3-EPHY, VCC3V3-HDMI, VCC3V3-USB]  [project net HDMI-3V]
VCC-RTC: C36.2 C39.2 R3.1 R5.2 R227.2 R228.2 U1.K6(VCC_RTC) U3.3(VIN)  [project net VCC-IR]
VDD1V1-EPHY: C7.2 U1.F8(EPHY_VDD)
VDD1V2-SYS: C26.2 C27.2 C28.2 C29.2 C30.2 U1.H10(VDD_SYS0) U1.J10(VDD_SYS2) U1.J11(VDD_SYS3) U1.J12(VDD_SYS4) U1.K10(VDD_SYS5) U1.K11(VDD_SYS6) U1.K12(VDD_SYS7) U1.L10(VDD_SYS1) U1.L11(VDD_SYS8) U1.L12(VDD_SYS9) U1.L13(VDD_SYS10) U1.L14(VDD_SYS11)
VDD-CPUS: C5.1 C17.2 C18.2 U1.J7(VDD_CPUS0) U1.J8(VDD_CPUS1) U1.M4(RTC_VIO)
VDD-CPUX: C21.2 C22.2 C23.2 C24.2 C25.2 U1.N8(VDD_CPUX0) U1.P6(VDD_CPUX1) U1.P7(VDD_CPUX2) U1.P8(VDD_CPUX3) U1.P9(VDD_CPUX4) U1.R6(VDD_CPUX5) U1.R7(VDD_CPUX6) U1.R8(VDD_CPUX7) U1.T6(VDD_CPUX8) U1.T7(VDD_CPUX9) U1.T8(VDD_CPUX10) U1.U6(VDD_CPUX11) U1.U9(VDD_CPUX12)
AGND: C32.1 C33.1 C34.1 C35.1 C37.1 C38.1 R7.1 R9.2 U1.U3(AGND)
AP-RESET#: C40.2 D47.1(ANODE) Q9.3(C) R5.1 U1.V6(RESET) U3.2(RESET_n)
CPUX-TCK: U1.D5(PA1/UART2_RX/JTAG_CK0/PA_EINT1) ; off-sheet CPUX-TCK
CPUX-TDI: U1.E13(PA3/UART2_CTS/JTAG_DI0/PA_EINT3) ; off-sheet CPUX-TDI
CPUX-TDO: U1.D6(PA2/UART2_RTS/JTAG_DO0/PA_EINT2) ; off-sheet CPUX-TDO
CPUX-TMS: U1.D11(PA0/UART2_TX/JTAG_MS0/PA_EINT0) ; off-sheet CPUX-TMS
CPUX-URX: U1.H6(PA5/UART0_RX/PWM0/PA_EINT5) ; off-sheet CPUX-URX
CPUX-UTX: U1.F5(PA4/UART0_TX/PA_EINT4) ; off-sheet CPUX-UTX
EPHY-LINK-LED: C289.2 U1.A2(EPHY_LINK_LED) ; off-sheet EPHY-LINK-LED
EPHY-RXN: U1.A4(EPHY_RXN) ; off-sheet EPHY-RXN
EPHY-RXP: U1.B4(EPHY_RXP) ; off-sheet EPHY-RXP
EPHY-SPD-LED: C290.2 U1.F7(EPHY_SPD_LED) ; off-sheet EPHY-SPD-LED
EPHY-TXN: U1.A3(EPHY_TXN) ; off-sheet EPHY-TXN
EPHY-TXP: U1.B3(EPHY_TXP) ; off-sheet EPHY-TXP
GND-CPUFB: R2.1 TP2.1(TP) U1.T9(GND_CPUXFB)
HCEC: U1.G5(HCEC) ; off-sheet HCEC
HHPD: U1.M2(HHPD) ; off-sheet HHPD  [project net TX1-HPD]
HSCL: U1.H3(HSCL) ; off-sheet HSCL  [project net TX1-DSCL]
HSDA: U1.K3(HSDA) ; off-sheet HSDA  [project net TX1-DSDA]
HTX0N: U1.F1(HTX0N) ; off-sheet HTX0N  [project net TX1-0-]
HTX0P: U1.G1(HTX0P) ; off-sheet HTX0P  [project net TX1-0+]
HTX1N: U1.G2(HTX1N) ; off-sheet HTX1N  [project net TX1-1-]
HTX1P: U1.H2(HTX1P) ; off-sheet HTX1P  [project net TX1-1+]
HTX2N: U1.J2(HTX2N) ; off-sheet HTX2N  [project net TX1-2-]
HTX2P: U1.J1(HTX2P) ; off-sheet HTX2P  [project net TX1-2+]
HTXCN: U1.E2(HTXCN) ; off-sheet HTXCN  [project net TX1-C-]
HTXCP: U1.F2(HTXCP) ; off-sheet HTXCP  [project net TX1-C+]
IR-RX: U1.U2(PL11/S_CIR_RX/S_PL_EINT11) ; off-sheet IR-RX
JTAG-SEL0: TP3.1(TP) U1.A1(JTAG_SEL0)
JTAG-SEL1: TP4.1(TP) U1.B2(JTAG_SEL)
LINEOUTL: U1.AA3(LINEOUTL) ; off-sheet LINEOUTL
LINEOUTR: U1.Y3(LINEOUTR) ; off-sheet LINEOUTR
MUTE: U1.D15(PA16/SPI1_MISO/UART3_CTS/PA_EINT16) ; off-sheet MUTE
PWR-DRAM: U1.M6(PL9/S_PL_EINT9) ; off-sheet PWR-DRAM
PWR-LED: U1.V2(PL10/S_PWM/S_PL_EINT10) ; off-sheet PWR-LED
PWR-STB: U1.T2(PL8/S_PL_EINT8) ; off-sheet PWR-STB
RECOVERY: U1.N2(PL4/S_JTAG_MS/S_PL_EINT4) ; off-sheet RECOVERY
S-TWI-SCK: R228.1 U1.N1(PL0/S_TWI_SCK/S_PL_EINT0) ; off-sheet S-TWI-SCK
S-TWI-SDA: R227.1 U1.M1(PL1/S_TWI_SDA/S_PL_EINT1) ; off-sheet S-TWI-SDA
SDC0-CLK: U1.D20(PF2/SDC0_CLK/UART0_TX) ; off-sheet SDC0-CLK
SDC0-CMD: U1.F18(PF3/SDC0_CMD/JTAG_DO0) ; off-sheet SDC0-CMD
SDC0-D0: U1.A19(PF1/SDC0_D0/JTAG_DI0) ; off-sheet SDC0-D0
SDC0-D1: U1.D19(PF0/SDC0_D1/JTAG_MS0) ; off-sheet SDC0-D1
SDC0-D2: U1.C20(PF5/SDC0_D2/JTAG_CK0) ; off-sheet SDC0-D2
SDC0-D3: U1.E21(PF4/SDC0_D3/UART0_RX) ; off-sheet SDC0-D3
SDC0-DET: U1.G18(PF6) ; off-sheet SDC0-DET
SPDIF-OUT: U1.C14(PA17/SPDIF_OUT/PA_EINT17) ; off-sheet SPDIF-OUT
STATUS-LED: U1.F14(PA15/SPI1_MOSI/UART3_RTS/PA_EINT15) ; off-sheet STATUS-LED
TV-OUT: U1.F10(TVOUT) ; off-sheet TV-OUT
UBOOT: U1.W6(UBOOT) ; off-sheet UBOOT
USB0-DRVVBUS: U1.P2(PL2/S_UART_TX/S_PL_EINT2) ; off-sheet USB0-DRVVBUS
USB1-DRVVBUS: U1.R1(PL3/S_UART_RX/S_PL_EINT3) ; off-sheet USB1-DRVVBUS
USB-DM0: U1.B5(USB_DM0) ; off-sheet USB-DM0
USB-DM1: U1.B7(USB_DM1) ; off-sheet USB-DM1
USB-DM3: U1.B9(USB_DM3) ; off-sheet USB-DM3
USB-DP0: U1.A5(USB_DP0) ; off-sheet USB-DP0
USB-DP1: U1.B6(USB_DP1) ; off-sheet USB-DP1
USB-DP3: U1.B8(USB_DP3) ; off-sheet USB-DP3
VCC-IO-EN: U1.R2(PL5/S_JTAG_CK/S_PL_EINT5) ; off-sheet VCC-IO-EN
VDD-CPUFB: TP1.1(TP) U1.T10(VDD_CPUXFB) ; off-sheet VDD-CPUFB
VRA1: C35.2 U1.Y4(VRA1)
VRA2: C34.2 R7.2 U1.W5(VRA2)
VRP: C32.2 C33.2 U1.V4(VRP)
WIFI-EN: U1.T3(PL7/S_JTAG_SI/S_PL_EINT7) ; off-sheet WIFI-EN
X24MI: C31.2 U1.K2(X24MIN) X2.1(XIN)
X24MO: R8.2 U1.K1(X24MOUT)
X32KI: C121.2 R236.2 U1.V5(X32KIN) X3.4
X32KO: C130.2 R236.1 U1.U4(X32KOUT) X3.1
NetC3_1: C3.1 U1.H11(VDD_EFUSEBP)
NetC41_2: C41.2 R8.1 X2.3(XOUT)
NetC301_1: C301.1 D48.C R340.2 R345.2
NetQ9_1: Q9.1(B) R345.1
NetR3_2: R3.2 U1.AA6(NMI)
NetR97_2: R97.2 U1.F6(EPHY_RTX)
NetR344_2: R344.2 U1.AA5(KEYADC)

Not connected (* = marked no-connect by the designer): U1 A7(USB_DP2) A8(USB_DM2) A10(PE1/CSI_MCLK/TS_ERR) A11(PE11/CSI_D7/TS_D7) A13(PA20/PCM0_DOUT/SIM_VPPEN/PA_EINT20) A14(PA21/PCM0_DIN/SIM_VPPPP/PA_EINT21) A20(PD4/RGMII_RXCK/MII_RXCK/RMII_NULL) AA2(MICIN2N) B1(PG13/PCM1_DIN/PG_EINT13) B10(PE0/CSI_PCLK/TS_CLK) B11(PE2/CSI_HSYNC/TS_SYNC) B12(PE12/CSI_SCK/TWI2_SCK) B13(PA18/PCM0_SYNC/TWI1_SCK/PA_EINT18) B14(PA19/PCM0_CLK/TWI1_SDA/PA_EINT19) B20(PD2/RGMII_RXD1/MII_RXD1/RMII_RXD1) B21(PD6/RGMII_NULL/MII_RXERR/RMII_RXER) C1(PG5/SDC1_D3/PG_EINT5) C2(PG4/SDC1_D2/PG_EINT4) C3(PG8/UART1_RTS/PG_EINT8) C5(PE15) C6(PE14) C7(PE13/CSI_SDA/TWI2_SDA) C8(PE7/CSI_D3/TS_D3) C9(PE4/CSI_D0/TS_D0) C10(PE3/CSI_VSYNC/TS_DVLD) C11(PE8/CSI_D4/TS_D4) C12(PE9/CSI_D5/TS_D5) C13(PA12/TWI0_SDA/DI_RX/PA_EINT12) C21(PD0/RGMII_RXD3/MII_RXD3/RMII_NULL/DI_TX) D1(PG12/PCM1_DOUTPG_EINT12) D2(PG11/PCM1_CLK/PG_EINT11) D3(PG7/UART1_RX/PG_EINT7) D8(PA7/SIM_CLK/PA_EINT7) D10(PE6/CSI_D2/TS_D2) D13(PA9/SIM_RST/PA_EINT9) E3(PG9/UART1_CTS/PG_EINT9) E8(PE10/CSI_D6/TS_D6) E10(PE5/CSI_D1/TS_D1) E11(PA10/SIM_DET/PA_EINT10) E14(PA6/SIM_PWREN/PWM1/PA_EINT6) E15(PA13/SPI1_CS/UART3_TX/PA_EINT13) E18(PD7/RGMII_TXD3/MII_TXD3/RMII_NULL) E19(PD12/RGMII_TXCK/MII_TXCK/RMII_TXCK) E20(PD8/RGMII_TXD2/MII_TXD2/RMII_NULL) F3(PG3/SDC1_D1/PG_EINT3) F11(PA11/TWI0_SCK/DI_TX/PA_EINT11) F13(PA8/SIM_DATA/PA_EINT8) F19(PD5/RGMII_RXCTL/MII_RXDV/RMII_CRS_D) F20(PD11/RGMII_NULL/MII_CRS/RMII_NULL) F21(PD9/RGMII_TXD1/MII_TXD1/RMII_TXD1) G4(PG6/UART1_TX/PG_EINT6) G12(PA14/SPI1_CLK/UART3_RX/PA_EINT14) H4(PG2/SDC1_D0/PG_EINT2) H17(PD1/RGMII_RXD2/MII_RXD2/RMII_NULL/DI_RX) H18(PD3/RGMII_RXD0/MII_RXD0/RMII_RXD0) H19(PD10/RGMII_TXD0/MII_TXD0/RMII_TXD0) J3(PG0/SDC1_CLK/PG_EINT0) K4(X24MFOUT) K17(PD13/RGMII_TXCTL/MII_TXEN/RMII_TXEN) K18(PD15/RGMII_CLKIN/MII_COL/RMII_NULL) L2(PG1/SDC1_CMD/PG_EINT1) L5(PLLTEST) L17(PD14/RGMII_NULL/MII_TXERR/RMII_NULL) L18(PD16/MDC) L19(PD17/MDIO) M3(PG10/PCM1_SYNC/PG_EINT10) P3(X32KFOUT) T4(PL6/S_JTAG_DO/S_PL_EINT6) T5(TEST) V1(LINEINL) W1(LINEINR) W2(MICIN1P) W3(MBIAS) Y1(MICIN1N) Y2(MICIN2P)

### Notes on the sheet
- CPU
- (near R97) close IC
- close IC
- Close to IC
- OSC-RTC
- PWRON/WORK
- STANDBY
- PWROFF
- PWR-STB
- 1
- 0
- CLK
- PWR-DRAM
- (in symbol H3-BGA3XX_12, part C) SDC1
- (in symbol H3-BGA3XX_12, part D) GPIO
- (in symbol H3-BGA3XX_12, part E) CPUS
- (in symbol H3-BGA3XX_12, part F) HDMI; AUDIO / CODEC; EPHY
- (in symbol H3-BGA3XX_12, part G) USB; SYS
- (in symbol H3-BGA3XX_12, part H) POWER
- (in symbol TitleBlock0-AW) AllWinner Technology Co.,Ltd; Design Name; Size; Page Name; Rev; Date:; Sheet; of

### Library data of the parts
C1-C8 C17-C30 C33-C36 C289 C290 = CAPACITOR_0_Dup5
C31 C32 C38 C41 C121 C130 = CAPACITOR_0_Dup5: PAGE: 2
C37 = CAPACITOR_0_Dup2: PAGE: 1
C39 C40 C301 = CAPACITOR_0_Dup1: PAGE: 6
D47 = 1_1.5KE100A_Dup1: 1ST PART DESCRIPTION: WILL ESD9B5V Bidirection ESD Protection
D48 = DIODE_SCHOTTKY_1
Q9 = NPN
R2 R3 R7-R9 R236 = R_Dup3
R5 R340 R345 = R1 0805_Dup1: PAGE: 6
R6 R227 R228 R344 = R_Dup4
R97 = R1_0805_Dup2
TP1-TP4 = T_POINT_R
U1 = H3-BGA3XX_12
U3 = MAX809RD_0: PAGE: 6
X2 = CRYSTAL-4_0: Crystal 24MHz 20pF 10ppm  -30 to +85; PART NUMBER: 7M24000004; Vendor: TXC; SPREADWIN PN: U3000019A
X3 = CRYSTAL_XCOL-3_2
*#6 = TitleBlock0-AW: Page Create Date: March  8, 1995

## Sheet 07 POWER.SchDoc
size 420 x 297 mm
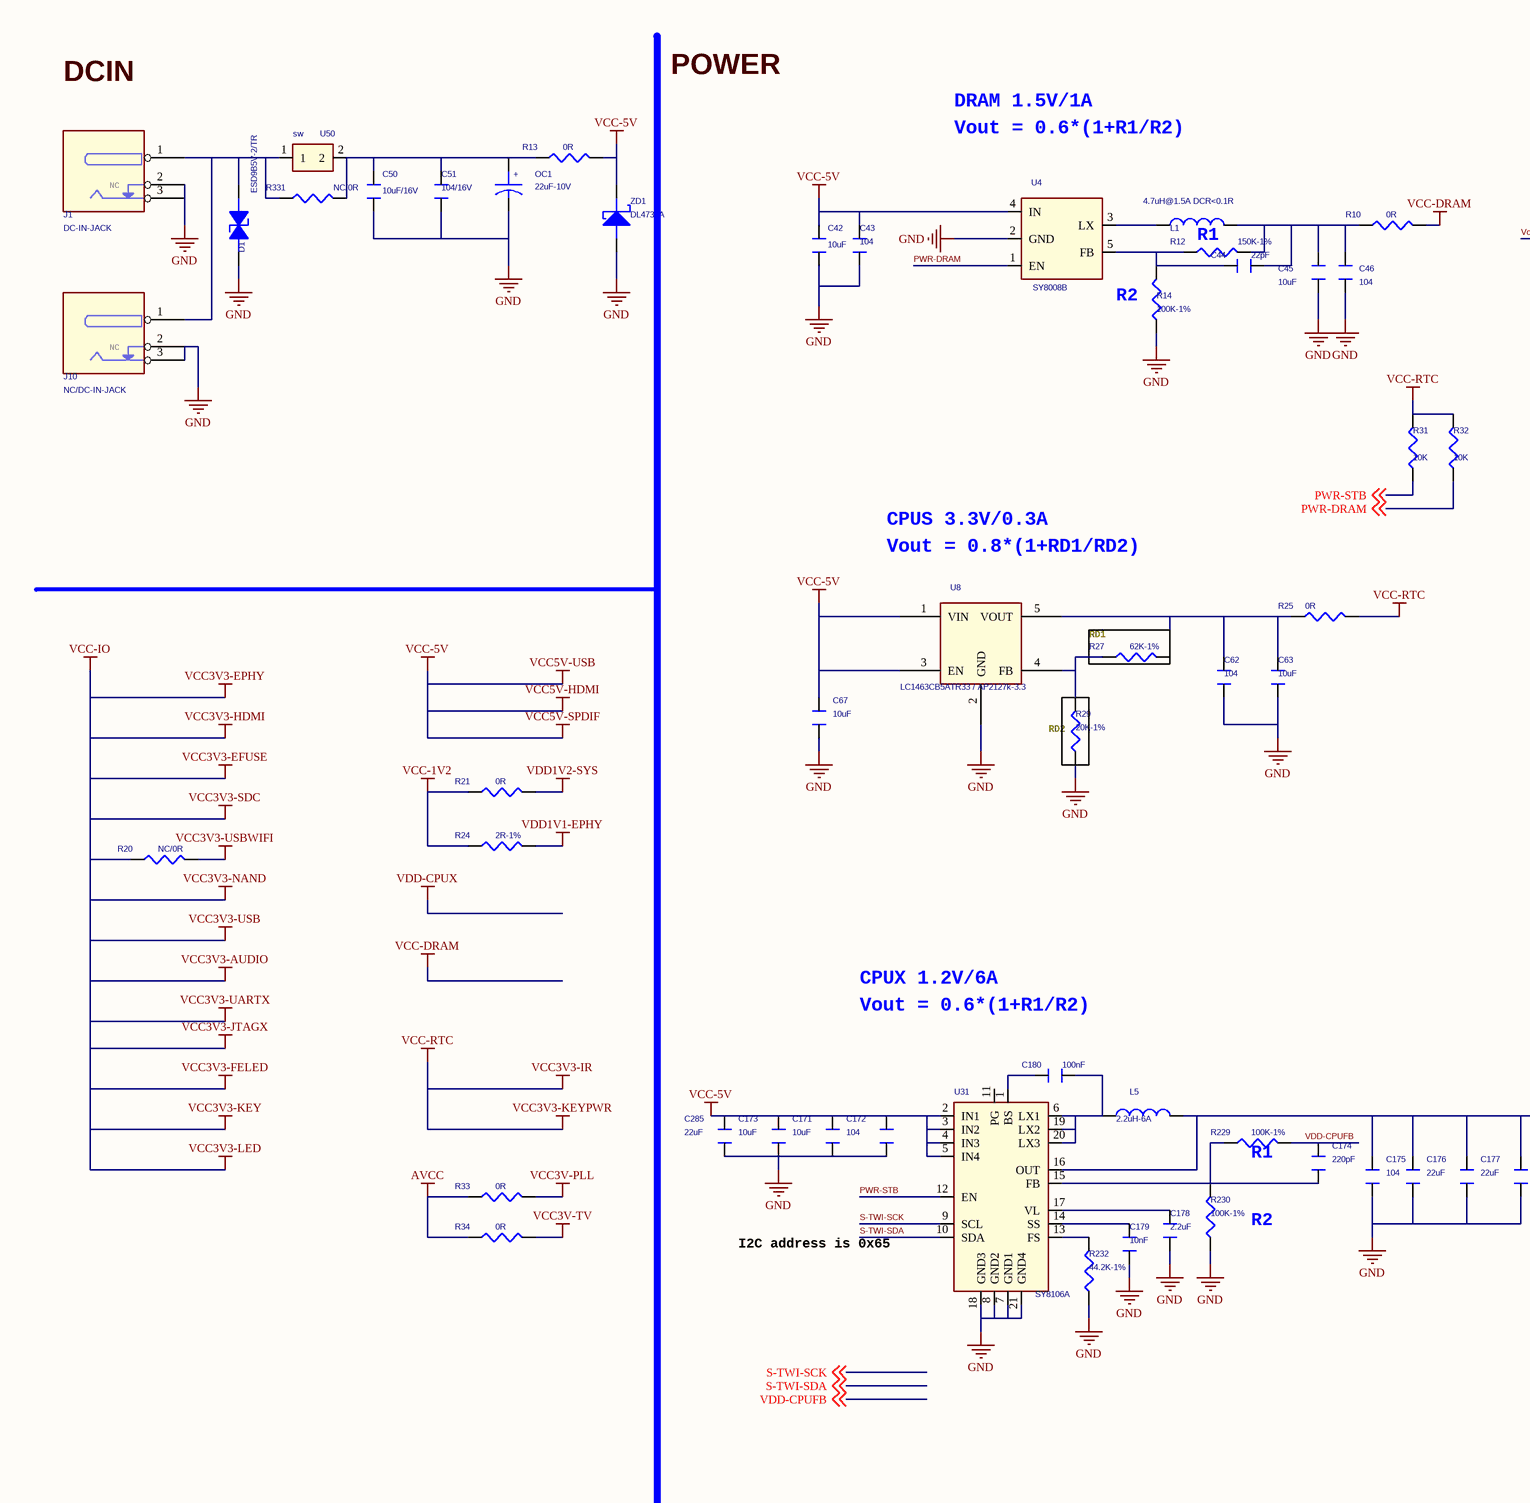
[diagram p6: 07 POWER.SchDoc, top left]
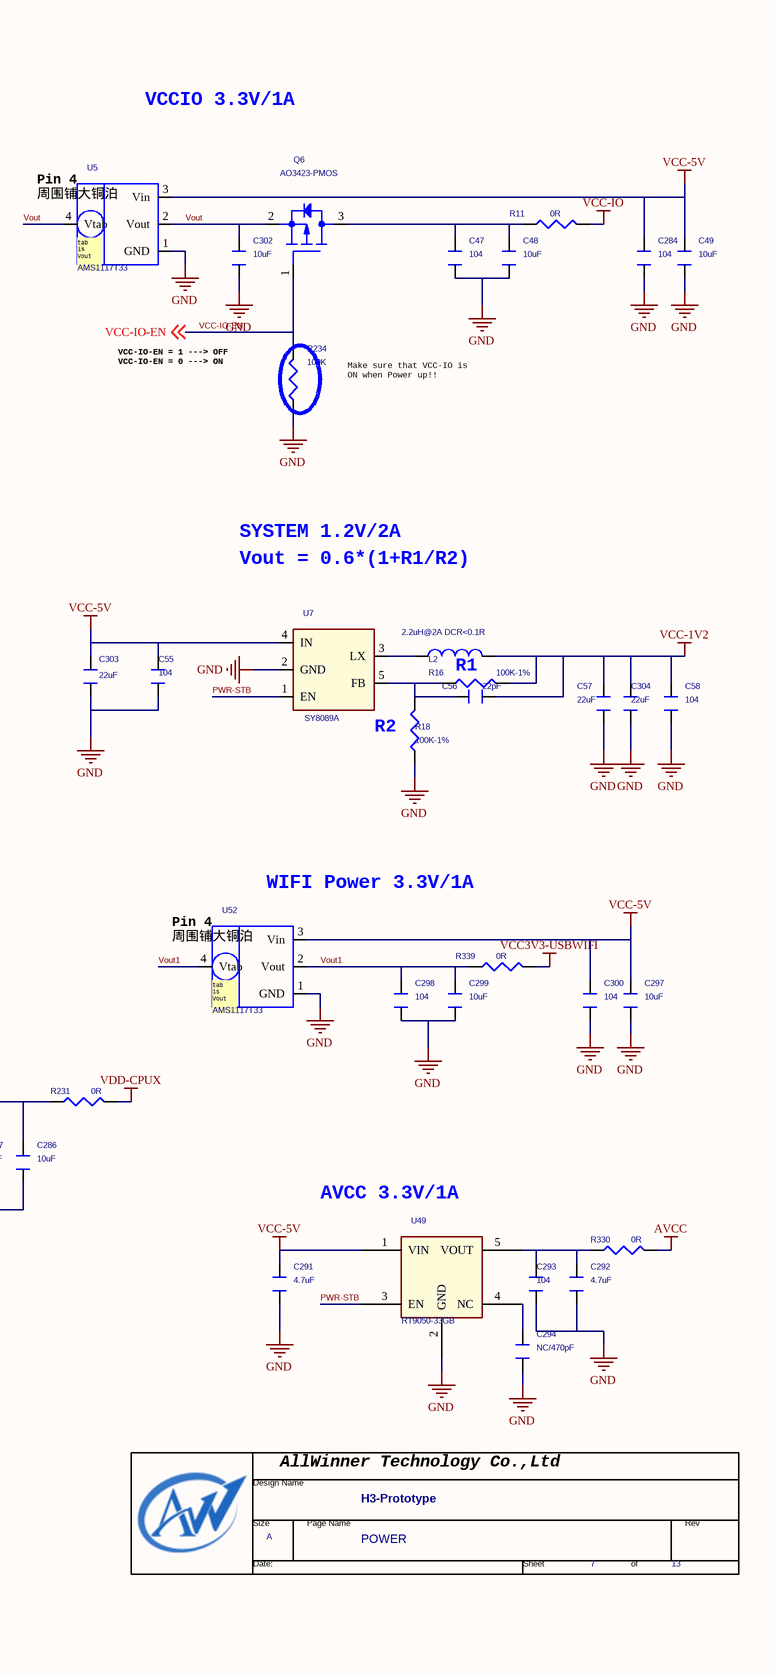
[diagram p7: 07 POWER.SchDoc, top right]
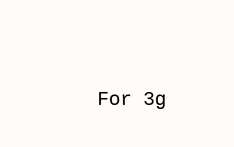
[diagram p8: 07 POWER.SchDoc, bottom left]

### Parts
(Parts that share a designator on the sheet are numbered #1, #2 ... from top to bottom, then left to right.)
*#7  Page Count: 13  Page Number: 7  Page Size: A  Title: H3-Prototype  Doc: POWER  (hidden comment: TitleBlock0-AW)  (graphical)
C42  10uF  [C0805]
C43  104  [C0402]
C44  22pF  [C0402]
C45  10uF  [C0805]
C46  104  [C0402]
C47  104  [C0402]
C48  10uF  [C0805]
C49  10uF  [C0805]
C50  10uF/16V  [C0805]
C51  104/16V  [C0402]
C55  104  [C0402]
C56  22pF  [C0402]
C57  22uF  [C0805]
C58  104  [C0402]
C62  104  [C0402]
C63  10uF  [C0805]
C67  10uF  [C0805]
C171  10uF  [C0805]
C172  104  [C0402]
C173  10uF  [C0805]
C174  220pF  [C0402]
C175  104  [C0402]
C176  22uF  [C0805]
C177  22uF  [C0805]
C178  2.2uF  [C0402]
C179  10nF  [C0402]
C180  100nF  [C0402]
C284  104  [C0402]
C285  22uF  [C0805]
C286  10uF  [C0805]
C291  4.7uF  [C0603]
C292  4.7uF  [C0603]
C293  104  [C0402]
C294  NC/470pF  [C0402]
C297  10uF  [C0805]
C298  104  [C0402]
C299  10uF  [C0805]
C300  104  [C0402]
C302  10uF  [C0805]
C303  22uF  [C0805]
C304  22uF  [C0805]
D1  ESD9B5V-2/TR  [C0402]
J1  DC-IN-JACK  [MJACK5PIN]
J10  NC/DC-IN-JACK  [MJACK5PIN]
L1  4.7uH@1.5A DCR<0.1R  [CD32]
L2  2.2uH@2A DCR<0.1R  [CD32]
L5  2.2uH-6A  [CD75]
OC1  22uF-10V  [C1210]
Q6  AO3423-PMOS  [SOT-23]
R10  0R  [R0603]
R11  0R  [R0603]
R12  150K-1%  [R0402]
R13  0R  [R0805]
R14  100K-1%  [R0402]
R16  100K-1%  [R0402]
R18  100K-1%  [R0402]
R20  NC/0R  [R0603]
R21  0R  [R0805]
R24  2R-1%  [R0402]
R25  0R  [R0603]
R27  62K-1%  [R0402]
R29  20K-1%  [R0402]
R31  10K  [R0402]
R32  10K  [R0402]
R33  0R  [R0603]
R34  0R  [R0603]
R229  100K-1%  [R0402]
R230  100K-1%  [R0402]
R231  0R  [R0603]
R232  44.2K-1%  [R0402]
R234  100K  [0805]
R330  0R  [R0603]
R331  NC/0R  [R1206]
R339  0R  [R0603]
U4  SY8008B  [SOT23-5]
U5  AMS1117T33  [SOT-223]
U7  SY8089A  [SOT23-5]
U8  LC1463CB5ATR33 / AP2127k-3.3  [SOT23-5]
U31  SY8106A  [QFN21P0_45B3_00X3_00H0_90]
U49  RT9050-33GB  [SOT23-5]
U50  sw  [XH-2-2_54]
U52  AMS1117T33  [SOT-223]
ZD1  DL4735A  [SOD123]

### Nets
AVCC: R33.1 R34.1 R330.2
GND: C42.2 C43.2 C45.2 C46.2 C47.1 C48.1 C49.1 C50.2 C51.2 C55.2 C57.2 C58.2 C62.1 C63.1 C67.1 C171.2 C172.2 C173.2 C175.1 C176.1 C177.1 C178.1 C179.1 C284.1 C285.2 C286.1 C291.1 C292.1 C293.1 C294.1 C297.1 C298.1 C299.1 C300.1 C302.1 C303.2 C304.2 D1.2(CATHODE) J1.2(GND0) J1.3(GND1) J10.2(GND0) J10.3(GND1) OC1.2 R14.1 R18.1 R29.1 R230.1 R232.1 R234.1 U4.2(GND) U5.1(GND) U7.2(GND) U8.2(GND) U31.7(GND1) U31.8(GND2) U31.18(GND3) U31.21(GND4) U49.2(GND) U52.1(GND) ZD1.A
VCC3V3-USBWIFI: R20.2 R339.2  [project net VCC-WIFI-IO]
VCC3V-PLL: R33.2
VCC3V-TV: R34.2
VCC-1V2: C56.2 C57.1 C58.1 C304.1 L2.2 R16.2 R21.1 R24.1
VCC-5V: C42.1 C43.1 C49.2 C55.1 C67.2 C171.1 C172.1 C173.1 C284.2 C285.1 C291.2 C297.2 C300.2 C303.1 R13.2 U4.4(IN) U5.3(Vin) U7.4(IN) U8.1(VIN) U8.3(EN) U31.2(IN1) U31.3(IN2) U31.4(IN3) U31.5(IN4) U49.1(VIN) U52.3(Vin) ZD1.C  [also labelled VCC5V-HDMI, VCC5V-SPDIF, VCC5V-USB]  [project net SPDIF-5V]
VCC-DRAM: R10.2
VCC-IO: R11.2 R20.1  [also labelled VCC3V3-AUDIO, VCC3V3-EFUSE, VCC3V3-EPHY, VCC3V3-FELED, VCC3V3-HDMI, VCC3V3-JTAGX, VCC3V3-KEY, VCC3V3-LED, VCC3V3-NAND, VCC3V3-SDC, VCC3V3-UARTX, VCC3V3-USB]  [project net HDMI-3V]
VCC-RTC: R25.2 R31.2 R32.2  [also labelled VCC3V3-IR, VCC3V3-KEYPWR]  [project net VCC-IR]
VDD1V1-EPHY: R24.2
VDD1V2-SYS: R21.2
VDD-CPUX: R231.2
PWR-DRAM: R32.1 U4.1(EN) ; off-sheet PWR-DRAM
PWR-STB: R31.1 U7.1(EN) U31.12(EN) U49.3(EN) ; off-sheet PWR-STB
S-TWI-SCK: U31.9(SCL) ; off-sheet S-TWI-SCK
S-TWI-SDA: U31.10(SDA) ; off-sheet S-TWI-SDA
VCC-IO-EN: Q6.1(GATE) R234.2 ; off-sheet VCC-IO-EN
VDD-CPUFB: C174.2 R229.2 ; off-sheet VDD-CPUFB
Vout: C302.2 Q6.2(SOURCE) U5.2(Vout) U5.4(Vtab)
Vout1: C298.2 C299.2 R339.1 U52.2(Vout) U52.4(Vtab)
NetC44_1: C44.1 R12.1 R14.2 U4.5(FB)
NetC44_2: C44.2 C45.1 C46.1 L1.2 R10.1 R12.2
NetC47_2: C47.2 C48.2 Q6.3(DRAIN) R11.1
NetC50_1: C50.1 C51.1 OC1.1 R13.1 R331.2 U50.2
NetC56_1: C56.1 R16.1 R18.2 U7.5(FB)
NetC62_2: C62.2 C63.2 R25.1 R27.2 U8.5(VOUT)
NetC174_1: C174.1 R229.1 R230.2 U31.15(FB)
NetC175_2: C175.2 C176.2 C177.2 C286.2 L5.2 R231.1 U31.16(OUT)
NetC178_2: C178.2 U31.17(VL)
NetC179_2: C179.2 U31.14(SS)
NetC180_1: C180.1 L5.1 U31.6(LX1) U31.19(LX2) U31.20(LX3)
NetC180_2: C180.2 U31.1(BS)
NetC292_2: C292.2 C293.2 R330.1 U49.5(VOUT)
NetC294_2: C294.2 U49.4(NC)
NetD1_1: D1.1(ANODE) J1.1(IN) J10.1(IN) R331.1 U50.1
NetL1_1: L1.1 U4.3(LX)
NetL2_1: L2.1 U7.3(LX)
NetR27_1: R27.1 R29.2 U8.4(FB)
NetR232_2: R232.2 U31.13(FS)

Not connected (* = marked no-connect by the designer): U31 11(PG)

### Notes on the sheet
- DCIN
- POWER
- DRAM 1.5V/1A
- VCCIO 3.3V/1A
- Vout = 0.6*(1+R1/R2)
- (near U5) Pin 4
  周围铺大铜泊
- (near L1) R1
- R2
- (near R234) VCC-IO-EN = 1 ---> OFF
  VCC-IO-EN = 0 ---> ON
- Make sure that VCC-IO is
  ON when Power up!!
- CPUS 3.3V/0.3A
- Vout = 0.8*(1+RD1/RD2)
- SYSTEM 1.2V/2A
- (near R27) RD1
- (near R29) RD2
- (near L2) R1
- (near U52) Pin 4
  周围铺大铜泊
- (near U52) WIFI Power 3.3V/1A
- CPUX 1.2V/6A
- (near R229) R1
- I2C address is 0x65
- (near U49) AVCC 3.3V/1A
- For 3g
- (in symbol AMS1117T33_2) tab / is / Vout
- (in symbol CAPACITOR_POL_0) +
- (in symbol PHONEJack_DCIN_0) NC
- (in symbol TitleBlock0-AW) AllWinner Technology Co.,Ltd; Design Name; Size; Page Name; Rev; Date:; Sheet; of

### Library data of the parts
C42 C45 C50 C57 C171 C173 C285 C303 = CAPACITOR_1: PAGE: 1
C43 C44 C46 C51 C55 C56 C58 C172 C304 = CAPACITOR_1_Dup1: PAGE: 1
C47-C49 C62 C63 C67 C174-C180 C284 C286 C291-C294 C297-C300 C302 = CAPACITOR
D1 = 1_1.5KE100A_Dup1: as D47 on sheet 06 CPU
J1 J10 = PHONEJack_DCIN_0: SDTSourceLibName: c:\tmp\LM4560.LIB; 02 DESC: CONN,  Power Jack F; 01 IPN: -; 03 MAN: -; 04 MPN: -
L1 L2 = INDUCTOR_1
L5 = INDUCTOR_5: RoHS Power Inductor 22uH 300mA H<1.8MM,CD32
OC1 = CAPACITOR_POL_0
Q6 = PMOS_0
R10-R13 R16 R20 R21 R24 R25 R31-R34 R231 R330 R331 R339 = R_Dup4
R14 R18 R27 R29 R229 R230 R232 = R_Dup3
R234 = R1_0805
U4 U7 = SY8088
U5 U52 = AMS1117T33_2
U8 = uP0107_0
U31 = SY8106a_0
U49 = RT9050
ZD1 = DIODE_SCHOTTKY_3
*#7 = TitleBlock0-AW: Page Create Date: March  8, 1995

## Sheet 08 NAND-eMMC.SchDoc
size 420 x 297 mm
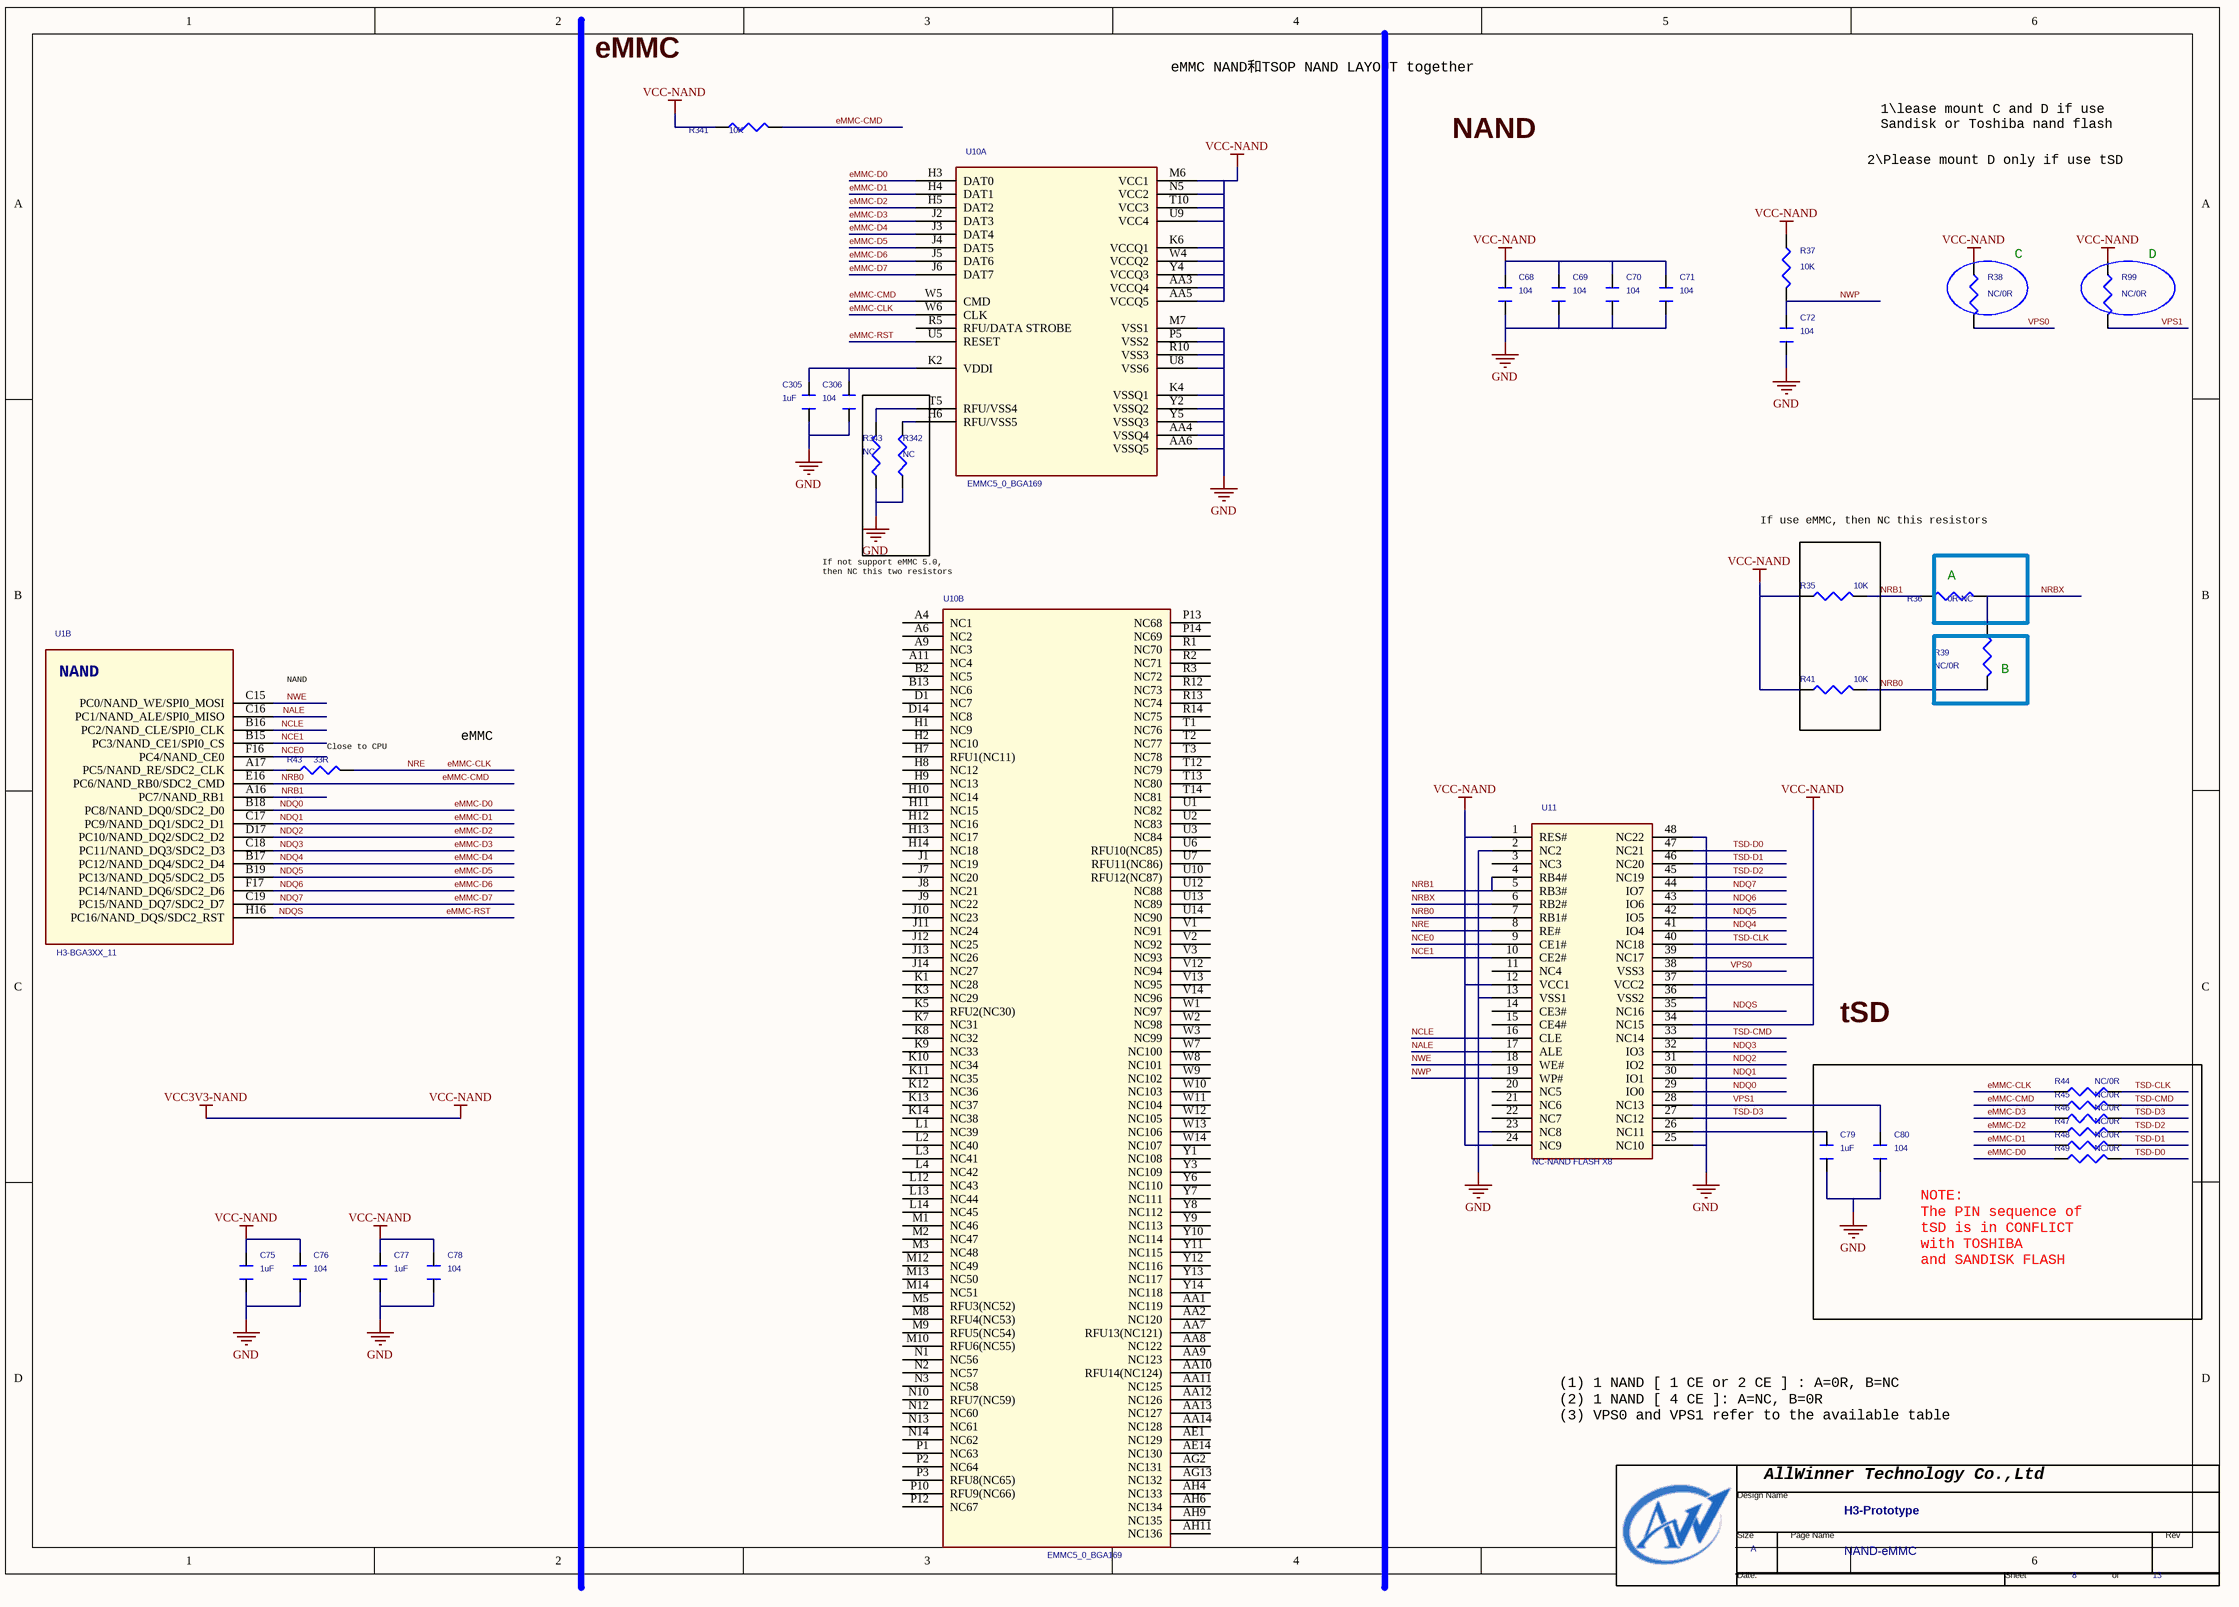
[diagram p9: 08 NAND-eMMC.SchDoc]

### Parts
(Parts that share a designator on the sheet are numbered #1, #2 ... from top to bottom, then left to right.)
*#8  Page Count: 13  Page Number: 8  Page Size: A  Title: H3-Prototype  Doc: NAND-eMMC  (hidden comment: TitleBlock0-AW)  (graphical)
C68  104  [C0402]
C69  104  [C0402]
C70  104  [C0402]
C71  104  [C0402]
C72  104  [C0402]
C75  1uF  [C0402]
C76  104  [C0402]
C77  1uF  [C0402]
C78  104  [C0402]
C79  1uF  [C0402]
C80  104  [C0402]
C305  1uF  [C0402]
C306  104  [C0402]
R35  10K  [R0402]
R36  0R-NC  [R0402]
R37  10K  [R0402]
R38  NC/0R  [R0402]
R39  NC/0R  [R0402]
R41  10K  [R0402]
R43  33R  [R0402]
R44  NC/0R  [R0402]
R45  NC/0R  [R0402]
R46  NC/0R  [R0402]
R47  NC/0R  [R0402]
R48  NC/0R  [R0402]
R49  NC/0R  [R0402]
R99  NC/0R  [R0402]
R341  10K  [R0402]
R342  NC  [R0402]
R343  NC  [R0402]
U1  H3-BGA3XX_11  [BGA347P0_65B14X14]  (part B of 9)
U10  EMMC5_0_BGA169  [BGA169P0_50B12_00X16_00H1_00]  (parts A,B of 2)
U11  NC-NAND FLASH X8  [TSOP-48]

### Blocks framed on the sheet
A: R36
B: R39

### Nets
GND: C68.1 C69.1 C70.1 C71.1 C72.1 C75.1 C76.1 C77.1 C78.1 C79.1 C80.1 C305.1 C306.1 R342.1 R343.1 U10.AA4(VSSQ4) U10.AA6(VSSQ5) U10.K4(VSSQ1) U10.M7(VSS1) U10.P5(VSS2) U10.R10(VSS3) U10.U8(VSS6) U10.Y2(VSSQ2) U10.Y5(VSSQ3) U11.2(NC2) U11.13(VSS1) U11.23(NC8) U11.25(NC10) U11.36(VSS2) U11.48(NC22)
VCC-NAND: C68.2 C69.2 C70.2 C71.2 C75.2 C76.2 C77.2 C78.2 R35.1 R37.1 R38.1 R41.1 R99.1 R341.1 U10.AA3(VCCQ4) U10.AA5(VCCQ5) U10.K6(VCCQ1) U10.M6(VCC1) U10.N5(VCC2) U10.T10(VCC3) U10.U9(VCC4) U10.W4(VCCQ2) U10.Y4(VCCQ3) U11.1(RES#) U11.12(VCC1) U11.24(NC9) U11.34(NC15) U11.37(VCC2) U11.39(NC17)  [also labelled VCC3V3-NAND]  [project net HDMI-3V]
eMMC-CLK: R43.2 R44.1 U10.W6(CLK) U11.8(RE#)  [also labelled NRE]
eMMC-CMD: R39.2 R41.2 R45.1 R341.2 U1.E16(PC6/NAND_RB0/SDC2_CMD) U10.W5(CMD) U11.7(RB1#)  [also labelled NRB0]
eMMC-D0: R49.1 U1.B18(PC8/NAND_DQ0/SDC2_D0) U10.H3(DAT0) U11.29(IO0)  [also labelled NDQ0]
eMMC-D1: R48.1 U1.C17(PC9/NAND_DQ1/SDC2_D1) U10.H4(DAT1) U11.30(IO1)  [also labelled NDQ1]
eMMC-D2: R47.1 U1.D17(PC10/NAND_DQ2/SDC2_D2) U10.H5(DAT2) U11.31(IO2)  [also labelled NDQ2]
eMMC-D3: R46.1 U1.C18(PC11/NAND_DQ3/SDC2_D3) U10.J2(DAT3) U11.32(IO3)  [also labelled NDQ3]
eMMC-D4: U1.B17(PC12/NAND_DQ4/SDC2_D4) U10.J3(DAT4) U11.41(IO4)  [also labelled NDQ4]
eMMC-D5: U1.B19(PC13/NAND_DQ5/SDC2_D5) U10.J4(DAT5) U11.42(IO5)  [also labelled NDQ5]
eMMC-D6: U1.F17(PC14/NAND_DQ6/SDC2_D6) U10.J5(DAT6) U11.43(IO6)  [also labelled NDQ6]
eMMC-D7: U1.C19(PC15/NAND_DQ7/SDC2_D7) U10.J6(DAT7) U11.44(IO7)  [also labelled NDQ7]
eMMC-RST: U1.H16(PC16/NAND_DQS/SDC2_RST) U10.U5(RESET) U11.35(NC16)  [also labelled NDQS]
NALE: U1.C16(PC1/NAND_ALE/SPI0_MISO) U11.17(ALE)
NCE0: U1.F16(PC4/NAND_CE0) U11.9(CE1#)
NCE1: U1.B15(PC3/NAND_CE1/SPI0_CS) U11.10(CE2#)
NCLE: U1.B16(PC2/NAND_CLE/SPI0_CLK) U11.16(CLE)
NRB1: R35.2 R36.1 U1.A16(PC7/NAND_RB1) U11.4(RB4#) U11.5(RB3#)
NRBX: R36.2 R39.1 U11.6(RB2#)
NWE: U1.C15(PC0/NAND_WE/SPI0_MOSI) U11.18(WE#)
NWP: C72.2 R37.2 U11.19(WP#)
TSD-CLK: R44.2 U11.40(NC18)
TSD-CMD: R45.2 U11.33(NC14)
TSD-D0: R49.2 U11.47(NC21)
TSD-D1: R48.2 U11.46(NC20)
TSD-D2: R47.2 U11.45(NC19)
TSD-D3: R46.2 U11.27(NC12)
VPS0: R38.2 U11.38(VSS3)
VPS1: C80.2 R99.2 U11.28(NC13)
NetC79_2: C79.2 U11.26(NC11)
NetC305_2: C305.2 C306.2 U10.K2(VDDI)
NetR43_1: R43.1 U1.A17(PC5/NAND_RE/SDC2_CLK)
NetR342_2: R342.2 U10.H6(RFU/VSS5)
NetR343_2: R343.2 U10.T5(RFU/VSS4)

Not connected (* = marked no-connect by the designer): U10 A4(NC1) A6(NC2) A9(NC3) A11(NC4) AA1(NC119) AA2(NC120) AA7(RFU13(NC121)) AA8(NC122) AA9(NC123) AA10(RFU14(NC124)) AA11(NC125) AA12(NC126) AA13(NC127) AA14(NC128) AE1(NC129) AE14(NC130) AG2(NC131) AG13(NC132) AH4(NC133) AH6(NC134) AH9(NC135) AH11(NC136) B2(NC5) B13(NC6) D1(NC7) D14(NC8) H1(NC9) H2(NC10) H7(RFU1(NC11)) H8(NC12) H9(NC13) H10(NC14) H11(NC15) H12(NC16) H13(NC17) H14(NC18) J1(NC19) J7(NC20) J8(NC21) J9(NC22) J10(NC23) J11(NC24) J12(NC25) J13(NC26) J14(NC27) K1(NC28) K3(NC29) K5(RFU2(NC30)) K7(NC31) K8(NC32) K9(NC33) K10(NC34) K11(NC35) K12(NC36) K13(NC37) K14(NC38) L1(NC39) L2(NC40) L3(NC41) L4(NC42) L12(NC43) L13(NC44) L14(NC45) M1(NC46) M2(NC47) M3(NC48) M5(RFU3(NC52)) M8(RFU4(NC53)) M9(RFU5(NC54)) M10(RFU6(NC55)) M12(NC49) M13(NC50) M14(NC51) N1(NC56) N2(NC57) N3(NC58) N10(RFU7(NC59)) N12(NC60) N13(NC61) N14(NC62) P1(NC63) P2(NC64) P3(RFU8(NC65)) P10(RFU9(NC66)) P12(NC67) P13(NC68) P14(NC69) R1(NC70) R2(NC71) R3(NC72) R5(RFU/DATA_STROBE) R12(NC73) R13(NC74) R14(NC75) T1(NC76) T2(NC77) T3(NC78) T12(NC79) T13(NC80) T14(NC81) U1(NC82) U2(NC83) U3(NC84) U6(RFU10(NC85)) U7(RFU11(NC86)) U10(RFU12(NC87)) U12(NC88) U13(NC89) U14(NC90) V1(NC91) V2(NC92) V3(NC93) V12(NC94) V13(NC95) V14(NC96) W1(NC97) W2(NC98) W3(NC99) W7(NC100) W8(NC101) W9(NC102) W10(NC103) W11(NC104) W12(NC105) W13(NC106) W14(NC107) Y1(NC108) Y3(NC109) Y6(NC110) Y7(NC111) Y8(NC112) Y9(NC113) Y10(NC114) Y11(NC115) Y12(NC116) Y13(NC117) Y14(NC118); U11 3(NC3) 11(NC4) 14(CE3#) 15(CE4#) 20(NC5) 21(NC6) 22(NC7)

### Notes on the sheet
- eMMC
- eMMC NAND和TSOP NAND LAYOUT together
- 1\lease mount C and D if use
  Sandisk or Toshiba nand flash
- NAND
- 2\Please mount D only if use tSD
- (near R38) C
- (near R99) D
- If use eMMC, then NC this resistors
- (near U10) If not support eMMC 5.0,
  then NC this two resistors
- (near R43) Close to CPU
- tSD
- NOTE:
  The PIN sequence of
  tSD is in CONFLICT
  with TOSHIBA
  and SANDISK FLASH
- (near *#8) (1) 1 NAND [ 1 CE or 2 CE ] : A=0R, B=NC
  (2) 1 NAND [ 4 CE ]: A=NC, B=0R
  (3) VPS0 and VPS1 refer to the available table
- (in symbol H3-BGA3XX_12, part B) NAND
- (in symbol TitleBlock0-AW) AllWinner Technology Co.,Ltd; Design Name; Size; Page Name; Rev; Date:; Sheet; of

### Library data of the parts
C68-C71 C75 C77 C79 C80 C305 = CAPACITOR_0_Dup5: PAGE: 2; mypage: 08
C72 C76 C78 C306 = CAPACITOR_0_Dup5: mypage: 08; PAGE: 2
R35 R37 R38 R41 R43-R49 R99 R341-R343 = R_Dup4: mypage: 08
R36 R39 = R_Dup3: mypage: 08
U1 = H3-BGA3XX_12
U11 = NAND_FLASH_X8: mypage: 08
*#8 = TitleBlock0-AW: Page Create Date: March  8, 1995

## Sheet 09 CARD-USB-WIFI.SchDoc
size 420 x 297 mm
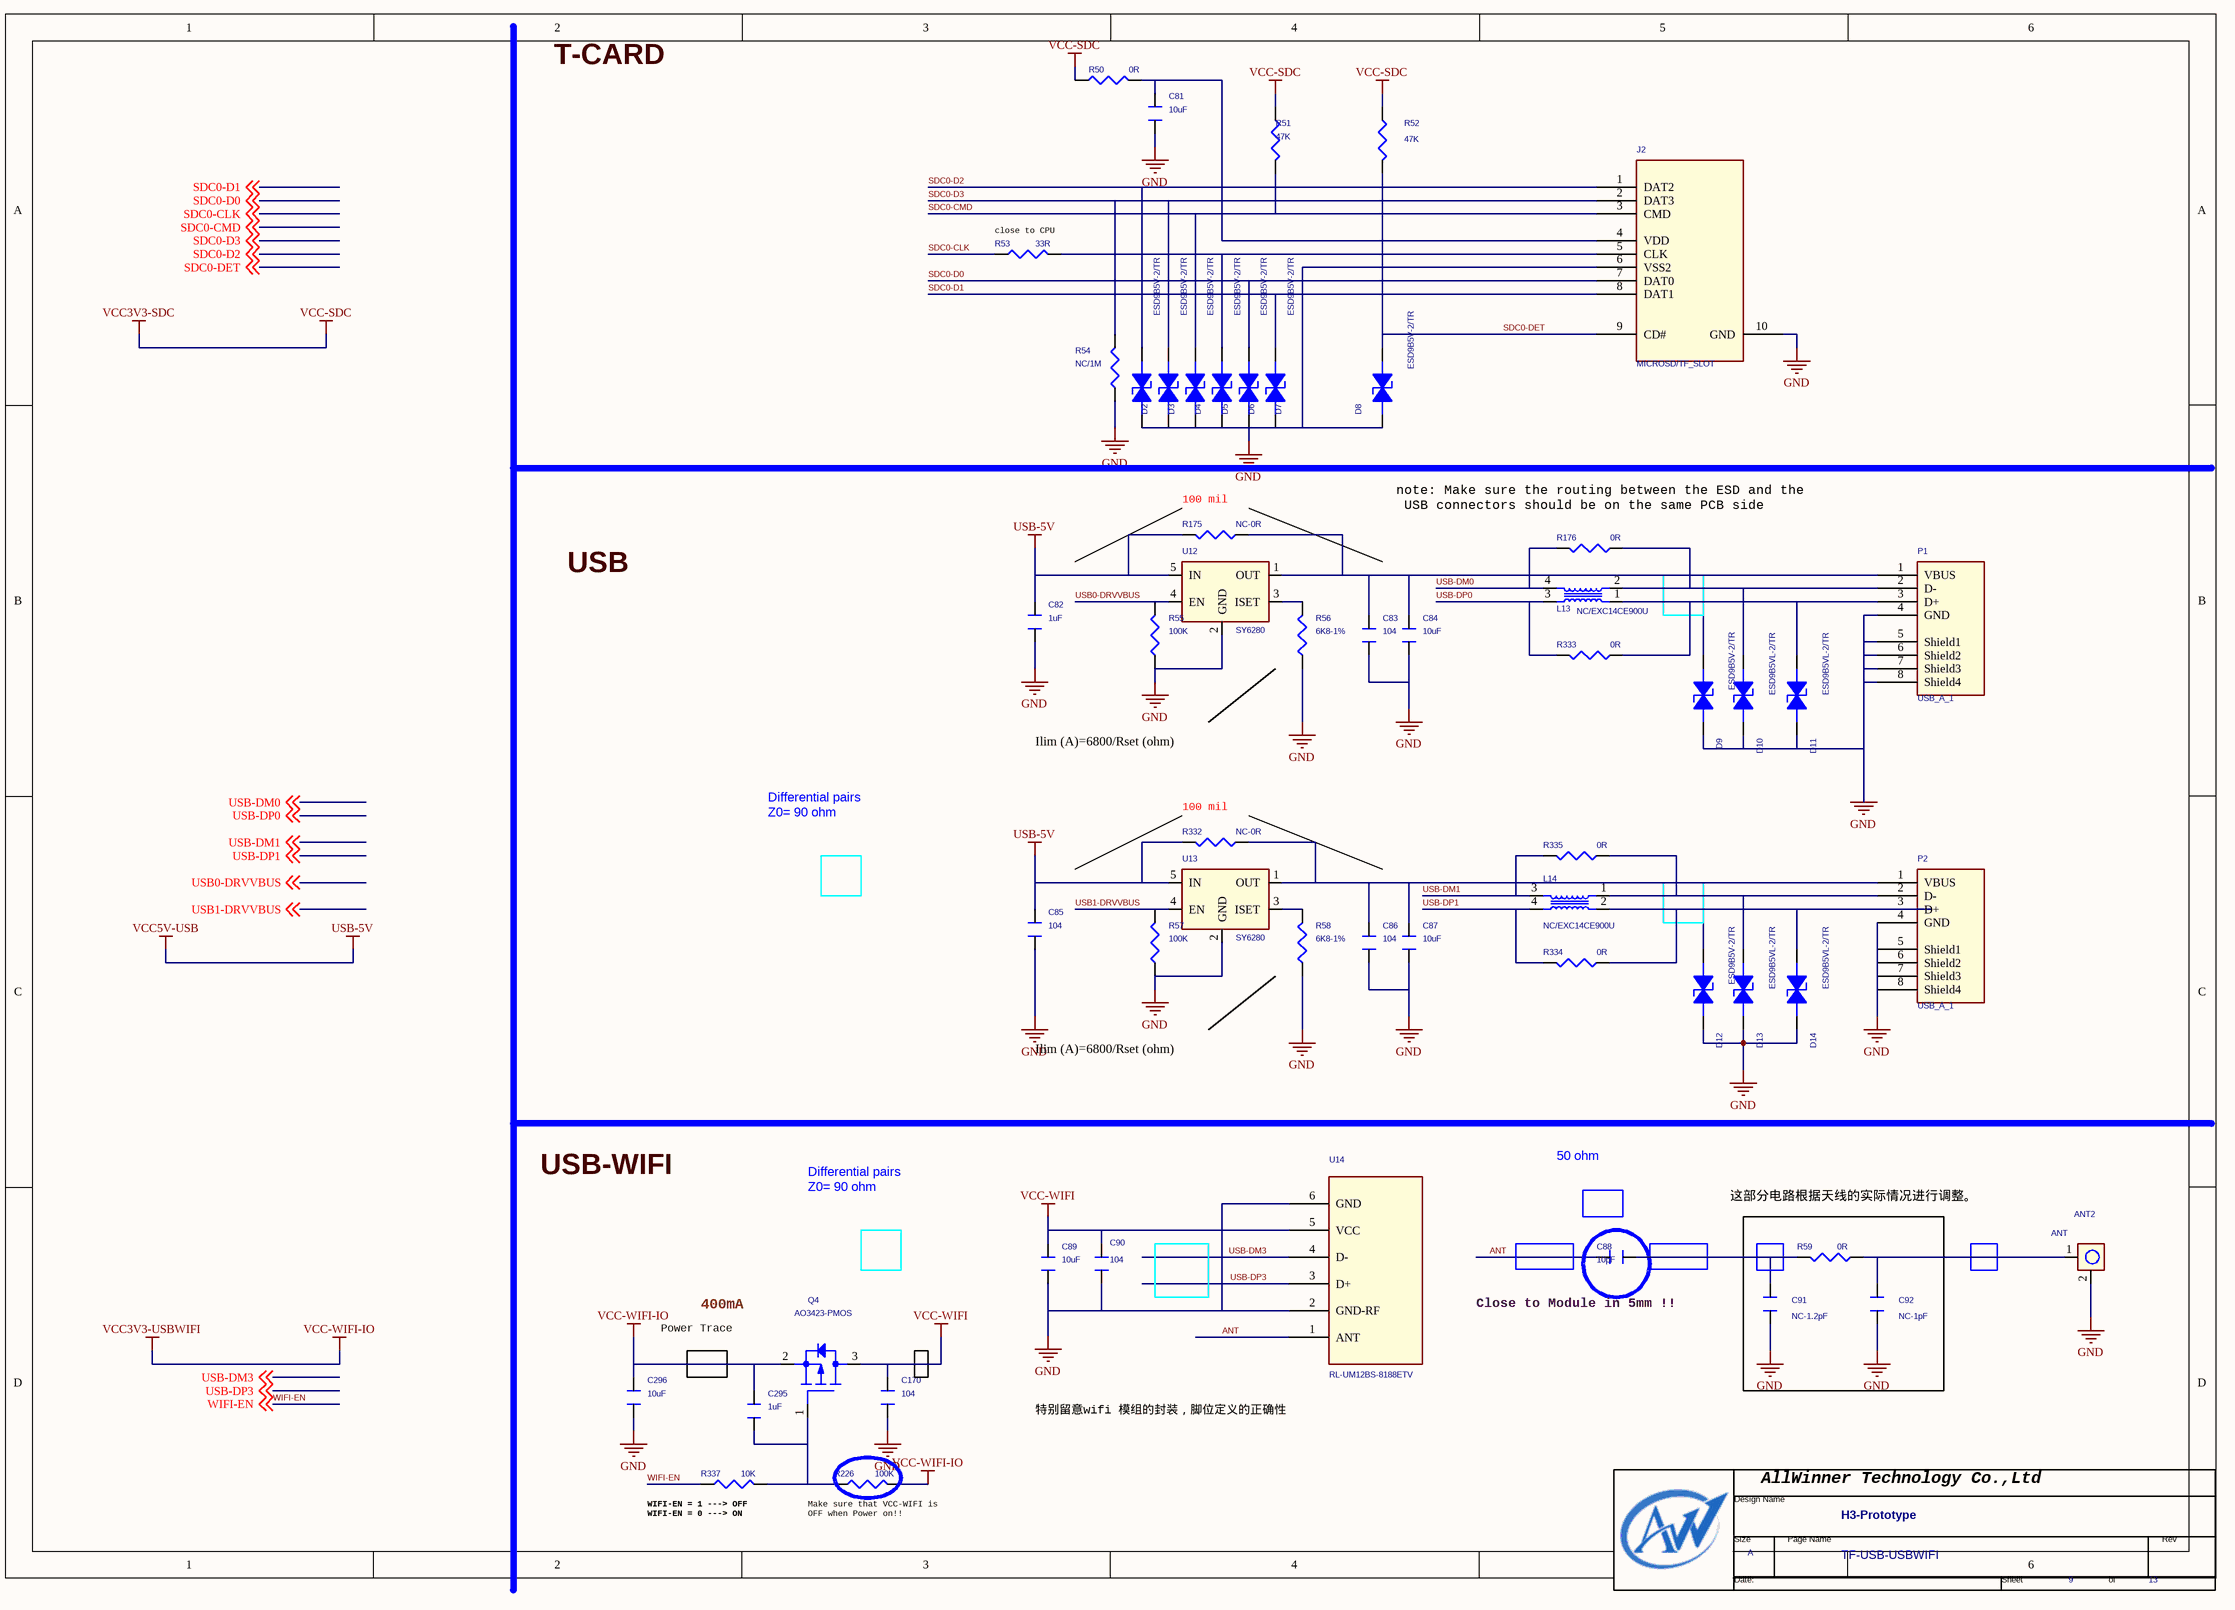
[diagram p10: 09 CARD-USB-WIFI.SchDoc]

### Parts
(Parts that share a designator on the sheet are numbered #1, #2 ... from top to bottom, then left to right.)
*#9  Page Count: 13  Page Number: 9  Page Size: A  Title: H3-Prototype  Doc: TF-USB-USBWIFI  (hidden comment: TitleBlock0-AW)  (graphical)
ANT2  ANT  [ANT30]
C81  10uF  [C0402]
C82  1uF  [C0402]
C83  104  [C0402]
C84  10uF  [C0603]
C85  104  [C0402]
C86  104  [C0402]
C87  10uF  [C0603]
C88  10pF  [C0402]
C89  10uF  [C0603]
C90  104  [C0402]
C91  NC-1.2pF  [C0402]
C92  NC-1pF  [C0402]
C170  104  [C0402]
C295  1uF  [C0402]
C296  10uF  [C0805]
D2  ESD9B5V-2/TR  [TVS0402]
D3  ESD9B5V-2/TR  [TVS0402]
D4  ESD9B5V-2/TR  [TVS0402]
D5  ESD9B5V-2/TR  [TVS0402]
D6  ESD9B5V-2/TR  [TVS0402]
D7  ESD9B5V-2/TR  [TVS0402]
D8  ESD9B5V-2/TR  [TVS0402]
D9  ESD9B5V-2/TR  [C0402]
D10  ESD9B5VL-2/TR  [C0402]
D11  ESD9B5VL-2/TR  [C0402]
D12  ESD9B5V-2/TR  [C0402]
D13  ESD9B5VL-2/TR  [C0402]
D14  ESD9B5VL-2/TR  [C0402]
J2  MICROSD/TF_SLOT  [TF9P]
L13  NC/EXC14CE900U  [esd4p0_8b1_6x3_0]
L14  NC/EXC14CE900U  [esd4p0_8b1_6x3_0]
P1  USB_A_1  [USB_A_1]
P2  USB_A_1  [USB_A_1]
Q4  AO3423-PMOS  [SOT-23]
R50  0R  [R0402]
R51  47K  [R0402]
R52  47K  [R0402]
R53  33R  [R0402]
R54  NC/1M  [R0402]
R55  100K  [R0402]
R56  6K8-1%  [R0402]
R57  100K  [R0402]
R58  6K8-1%  [R0402]
R59  0R  [R0402]
R175  NC-0R  [R1206]
R176  0R  [R0402]
R226  100K  [0805]
R332  NC-0R  [R1206]
R333  0R  [R0402]
R334  0R  [R0402]
R335  0R  [R0402]
R337  10K  [0805]
U12  SY6280  [SOT23-6]
U13  SY6280  [SOT23-6]
U14  RL-UM12BS-8188ETV  [SOP6P2_00B12_96X_22]

### Nets
GND: ANT2.2 C81.1 C82.1 C83.1 C84.1 C85.1 C86.1 C87.1 C89.1 C90.2 C91.2 C92.2 C170.2 C296.2 D2.2(CATHODE) D3.2(CATHODE) D4.2(CATHODE) D5.2(CATHODE) D6.2(CATHODE) D7.2(CATHODE) D8.2(CATHODE) D9.2(CATHODE) D10.2(CATHODE) D11.2(CATHODE) D12.2(CATHODE) D13.2(CATHODE) D14.2(CATHODE) J2.6(VSS2) J2.10(GND) P1.4(GND) P1.5(Shield1) P1.6(Shield2) P1.7(Shield3) P1.8(Shield4) P2.4(GND) P2.5(Shield1) P2.6(Shield2) P2.7(Shield3) P2.8(Shield4) R54.1 R55.1 R56.1 R57.1 R58.1 U12.2(GND) U13.2(GND) U14.2(GND-RF) U14.6(GND)
USB-5V: C82.2 C85.2 R175.2 R332.2 U12.5(IN) U13.5(IN)  [also labelled VCC5V-USB]  [project net SPDIF-5V]
VCC-SDC: R50.1 R51.1 R52.1  [also labelled VCC3V3-SDC]  [project net HDMI-3V]
VCC-WIFI: C89.2 C90.1 C170.1 Q4.3(DRAIN) U14.5(VCC)
VCC-WIFI-IO: C295.1 C296.1 Q4.2(SOURCE) R226.2  [also labelled VCC3V3-USBWIFI]
ANT: C88.2 U14.1(ANT)
SDC0-CLK: R53.1 ; off-sheet SDC0-CLK
SDC0-CMD: D4.1(ANODE) J2.3(CMD) R51.2 ; off-sheet SDC0-CMD
SDC0-D0: D6.1(ANODE) J2.7(DAT0) ; off-sheet SDC0-D0
SDC0-D1: D7.1(ANODE) J2.8(DAT1) ; off-sheet SDC0-D1
SDC0-D2: D2.1(ANODE) J2.1(DAT2) ; off-sheet SDC0-D2
SDC0-D3: D3.1(ANODE) J2.2(DAT3) R54.2 ; off-sheet SDC0-D3
SDC0-DET: D8.1(ANODE) J2.9(CD#) R52.2 ; off-sheet SDC0-DET
USB0-DRVVBUS: R55.2 U12.4(EN) ; off-sheet USB0-DRVVBUS
USB1-DRVVBUS: R57.2 U13.4(EN) ; off-sheet USB1-DRVVBUS
USB-DM0: L13.4(R4) R176.2 ; off-sheet USB-DM0
USB-DM1: L14.3(R3) R335.2 ; off-sheet USB-DM1
USB-DM3: U14.4(D-) ; off-sheet USB-DM3
USB-DP0: L13.3(R3) R333.2 ; off-sheet USB-DP0
USB-DP1: L14.4(R4) R334.2 ; off-sheet USB-DP1
USB-DP3: U14.3(D+) ; off-sheet USB-DP3
WIFI-EN: R337.1 ; off-sheet WIFI-EN
NetANT2_1: ANT2.1 C92.1 R59.2
NetC81_2: C81.2 J2.4(VDD) R50.2
NetC83_2: C83.2 C84.2 D9.1(ANODE) P1.1(VBUS) R175.1 U12.1(OUT)
NetC86_2: C86.2 C87.2 D12.1(ANODE) P2.1(VBUS) R332.1 U13.1(OUT)
NetC88_1: C88.1 C91.1 R59.1
NetC295_2: C295.2 Q4.1(GATE) R226.1 R337.2
NetD5_1: D5.1(ANODE) J2.5(CLK) R53.2
NetD10_1: D10.1(ANODE) L13.2(R2) P1.2(D-) R176.1
NetD11_1: D11.1(ANODE) L13.1(R1) P1.3(D+) R333.1
NetD13_1: D13.1(ANODE) L14.1(R1) P2.2(D-) R335.1
NetD14_1: D14.1(ANODE) L14.2(R2) P2.3(D+) R334.1
NetR56_2: R56.2 U12.3(ISET)
NetR58_2: R58.2 U13.3(ISET)

### Notes on the sheet
- T-CARD
- (near R53) close to CPU
- (near R175) 100 mil
- (near R176) note: Make sure the routing between the ESD and the
  USB connectors should be on the same PCB side
- USB
- Differential pairs
  Z0= 90 ohm
- Ilim (A)=6800/Rset (ohm)
- (near R332) 100 mil
- USB-WIFI
- 50 ohm
- (near R59) 这部分电路根据天线的实际情况进行调整。
- Power Trace
- 400mA
- (near C88) Close to Module in 5mm !!
- 特别留意wifi 模组的封装，脚位定义的正确性
- (near R337) WIFI-EN = 1 ---> OFF
  WIFI-EN = 0 ---> ON
- (near R226) Make sure that VCC-WIFI is
  OFF when Power on!!
- (in symbol TitleBlock0-AW) AllWinner Technology Co.,Ltd; Design Name; Size; Page Name; Rev; Date:; Sheet; of

### Library data of the parts
ANT2 = ANT_0: WIFI_ANT
C81 = CAPACITOR: PAGE: 3
C82-C87 = CAPACITOR
C88 C90-C92 = CAPACITOR_0_Dup3: PAGE: 2
C89 = CAPACITOR_0_Dup3: PAGE: 1
C170 C295 C296 = CAPACITOR_0: PAGE: 1
D2-D14 = 1_1.5KE100A_Dup1: as D47 on sheet 06 CPU
J2 = SDMMC SLOT_11
L13 L14 = R-PACK4_1
Q4 = PMOS_0
R50-R54 = R_Dup4
R55-R58 R175 R176 R332-R335 = R_Dup3
R59 = R_Dup2
R226 R337 = R1_0805
U12 U13 = RT9266PE_2
U14 = MINI USB-B_5
*#9 = TitleBlock0-AW: Page Create Date: March  8, 1995

## Sheet 10 AV-SPDIF.SchDoc
size 420 x 297 mm
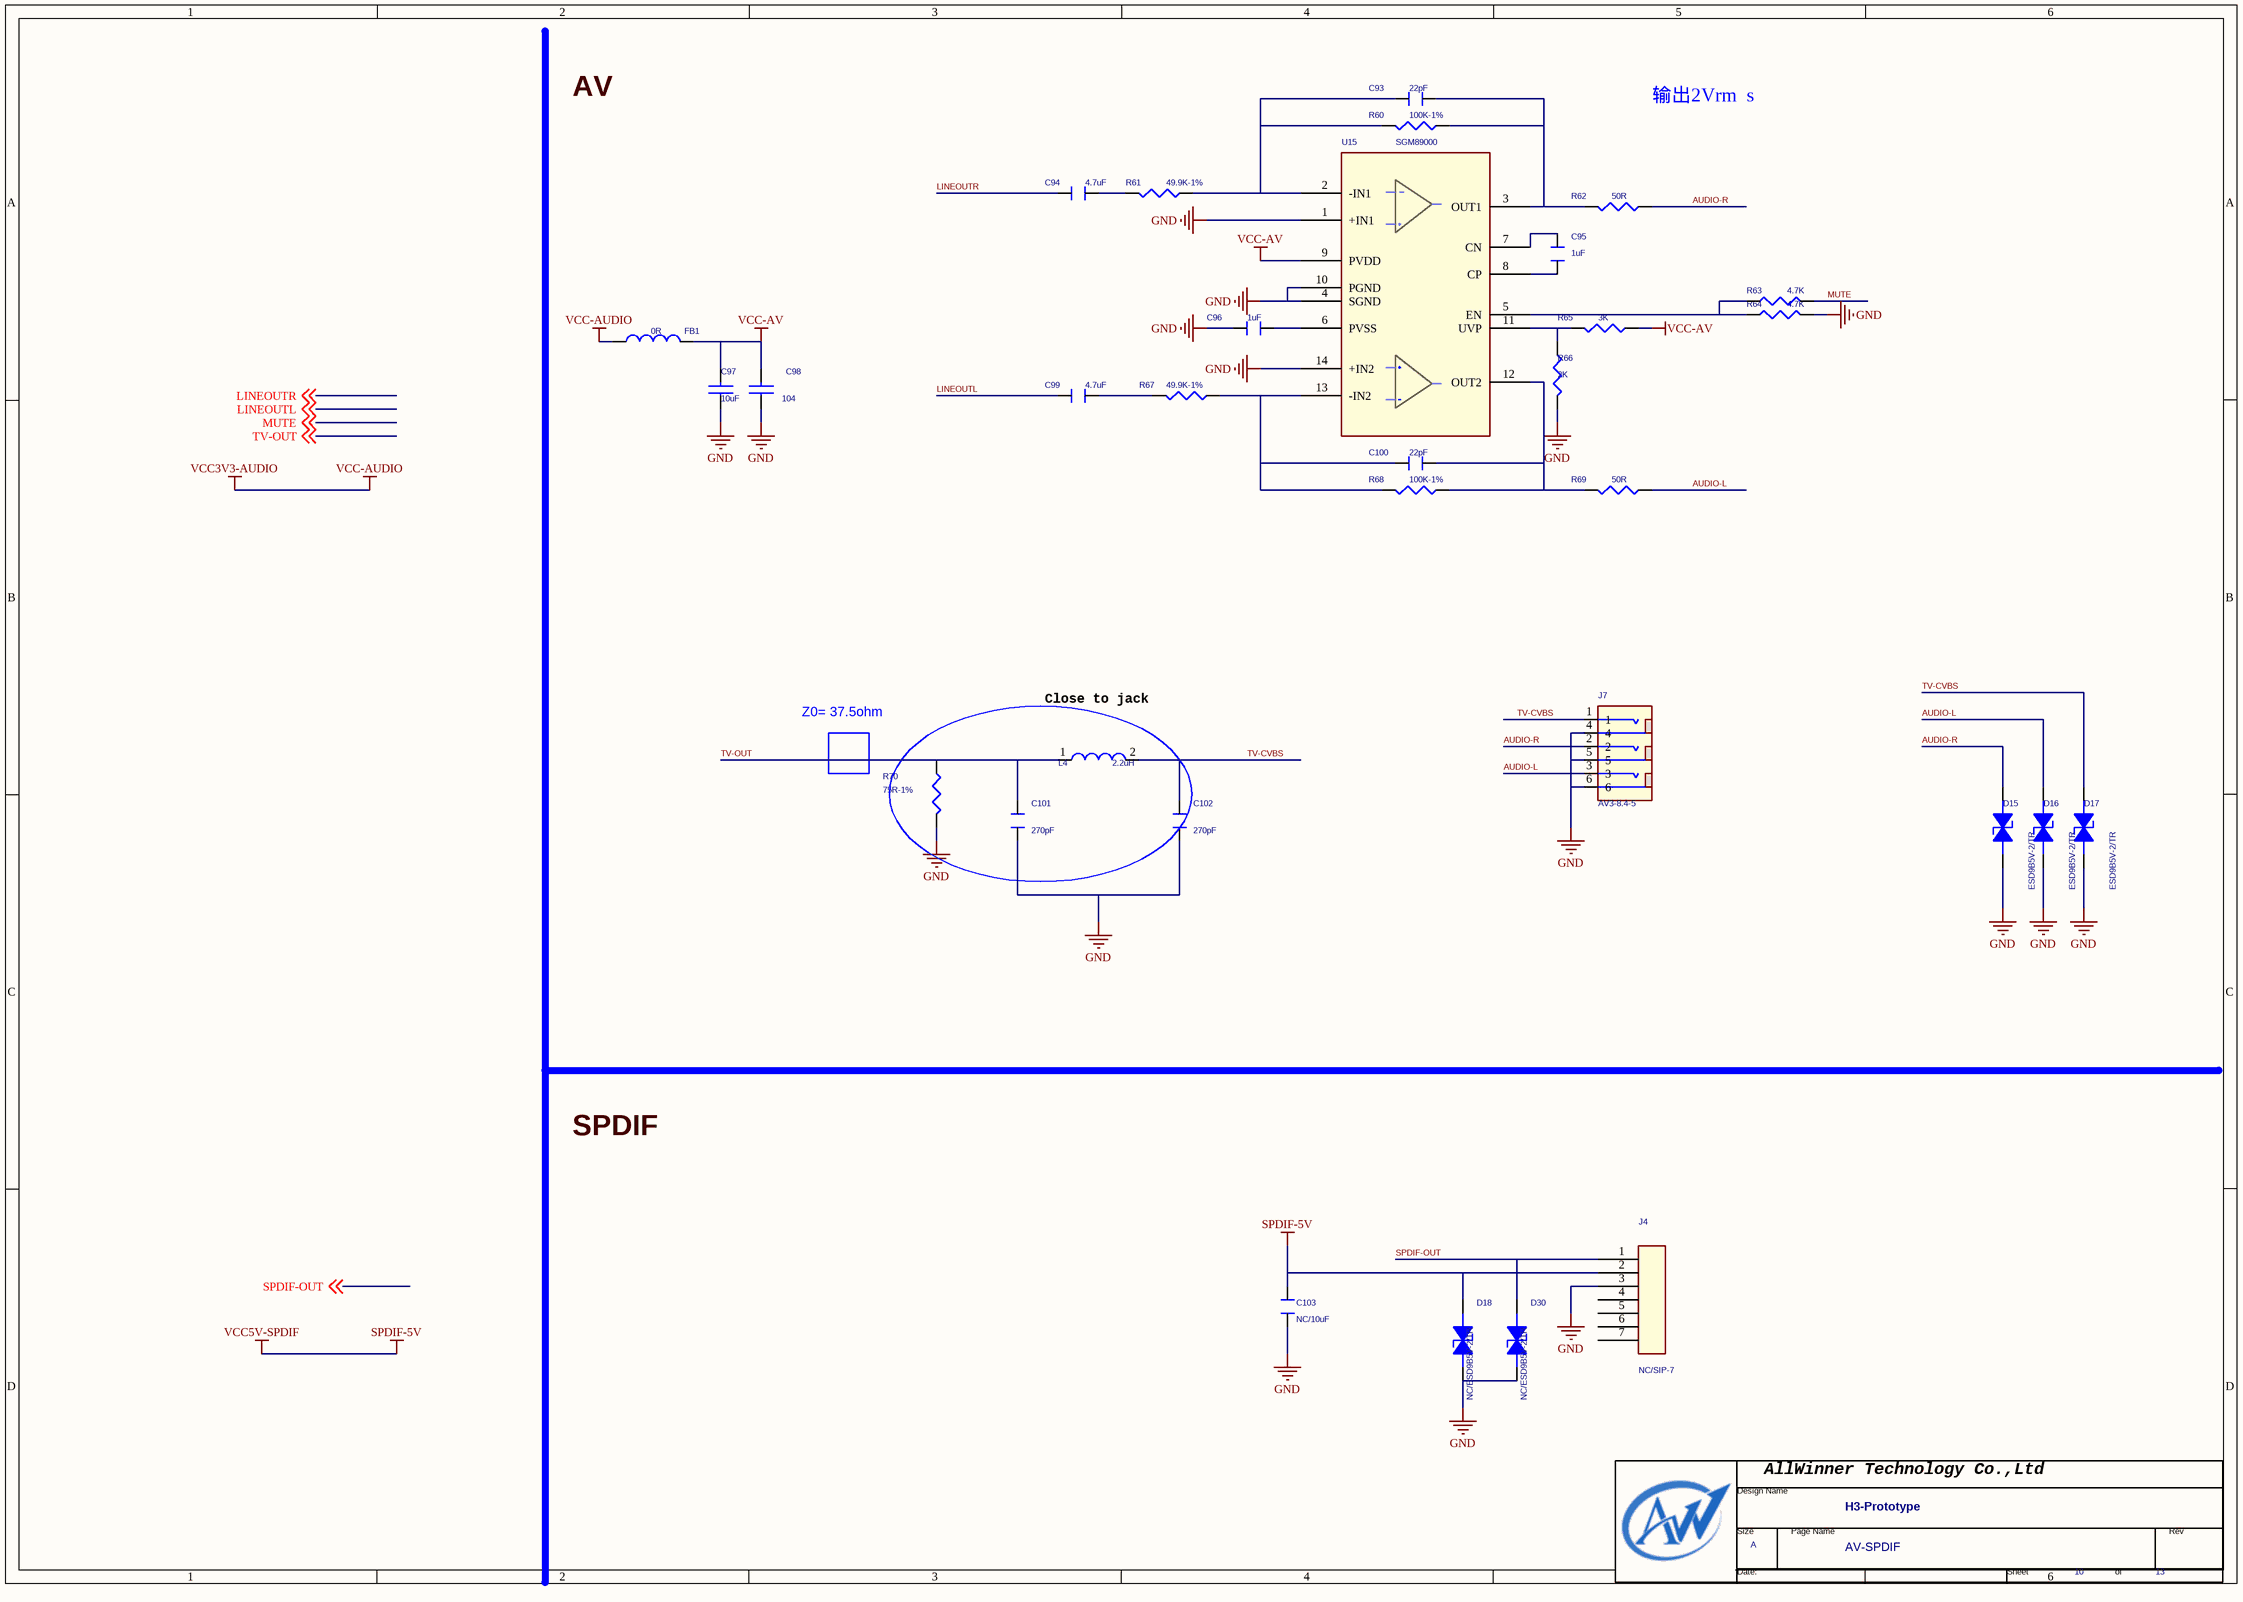
[diagram p11: 10 AV-SPDIF.SchDoc]

### Parts
(Parts that share a designator on the sheet are numbered #1, #2 ... from top to bottom, then left to right.)
*#10  Page Count: 13  Page Number: 10  Page Size: A  Title: H3-Prototype  Doc: AV-SPDIF  (hidden comment: TitleBlock0-AW)  (graphical)
C93  22pF  [C0402]
C94  4.7uF  [C0402]
C95  1uF  [C0402]
C96  1uF  [C0402]
C97  10uF  [C0603]
C98  104  [C0402]
C99  4.7uF  [C0402]
C100  22pF  [C0402]
C101  270pF  [C0402]
C102  270pF  [C0402]
C103  NC/10uF  [C0603]
D15  ESD9B5V-2/TR  [C0402]
D16  ESD9B5V-2/TR  [C0402]
D17  ESD9B5V-2/TR  [C0402]
D18  NC/ESD9B5V-2/TR  [C0402]
D30  NC/ESD9B5V-2/TR  [C0402]
FB1  0R  [0805]
J4  NC/SIP-7  [SIP-7]
J7  AV3-8.4-5  [B2.0V-L4P]
L4  2.2uH  [L0603]
R60  100K-1%  [R0402]
R61  49.9K-1%  [R0402]
R62  50R  [R0402]
R63  4.7K  [0805]
R64  4.7K  [0805]
R65  3K  [R0402]
R66  2K  [R0402]
R67  49.9K-1%  [R0402]
R68  100K-1%  [R0402]
R69  50R  [R0402]
R70  75R-1%  [R0402]
U15  SGM89000  [TSSOP14]

### Nets
GND: C96.2 C97.1 C98.1 C101.1 C102.1 C103.2 D15.1(ANODE) D16.1(ANODE) D17.1(ANODE) D18.2(CATHODE) D30.2(CATHODE) J4.3 J7.4 J7.5 J7.6 R64.1 R66.2 R70.2 U15.1(+IN1) U15.4(SGND) U15.10(PGND) U15.14(+IN2)
SPDIF-5V: C103.1 D18.1(ANODE) J4.2  [also labelled VCC5V-SPDIF]
VCC-AUDIO: FB1.2  [also labelled VCC3V3-AUDIO]  [project net HDMI-3V]
VCC-AV: C97.2 C98.2 FB1.1 R65.1 U15.9(PVDD)
AUDIO-L: D16.2(CATHODE) J7.3 R69.1
AUDIO-R: D15.2(CATHODE) J7.2 R62.1
LINEOUTL: C99.2 ; off-sheet LINEOUTL
LINEOUTR: C94.2 ; off-sheet LINEOUTR
MUTE: R63.1 ; off-sheet MUTE
SPDIF-OUT: D30.1(ANODE) J4.1 ; off-sheet SPDIF-OUT
TV-CVBS: C102.2 D17.2(CATHODE) J7.1 L4.2
TV-OUT: C101.2 L4.1 R70.1 ; off-sheet TV-OUT
NetC93_1: C93.1 R60.1 R62.2 U15.3(OUT1)
NetC93_2: C93.2 R60.2 R61.1 U15.2(-IN1)
NetC94_1: C94.1 R61.2
NetC95_1: C95.1 U15.7(CN)
NetC95_2: C95.2 U15.8(CP)
NetC96_1: C96.1 U15.6(PVSS)
NetC99_1: C99.1 R67.2
NetC100_1: C100.1 R68.1 R69.2 U15.12(OUT2)
NetC100_2: C100.2 R67.1 R68.2 U15.13(-IN2)
NetR63_2: R63.2 R64.2 U15.5(EN)
NetR65_2: R65.2 R66.1 U15.11(UVP)

Not connected (* = marked no-connect by the designer): J4 4 5 6 7

### Notes on the sheet
- AV
- 输出2Vrm  s
- Z0= 37.5ohm
- (near L4) Close to jack
- SPDIF
- (in symbol TitleBlock0-AW) AllWinner Technology Co.,Ltd; Design Name; Size; Page Name; Rev; Date:; Sheet; of

### Library data of the parts
C93 C96 C100 = CAPACITOR: mypage: 13; PAGE: 2
C94 C95 C99 = CAPACITOR: PAGE: 2; mypage: 13
C97 C98 = CAP NP
C101-C103 = CAPACITOR
D15-D18 D30 = 1_1.5KE100A_Dup1: as D47 on sheet 06 CPU
FB1 = INDUCTOR_4
J4 = SIP-7
J7 = HEADER_1x4-2mm_0
L4 = INDUCTOR
R60-R62 R65-R69 = R_Dup4: mypage: 13
R63 R64 = R1 0805
R70 = RESISTOR_Dup1: ROOM: TVLCD
U15 = SGM8900
*#10 = TitleBlock0-AW: Page Create Date: March  8, 1995

## Sheet 11 MISC.SchDoc
size 420 x 297 mm
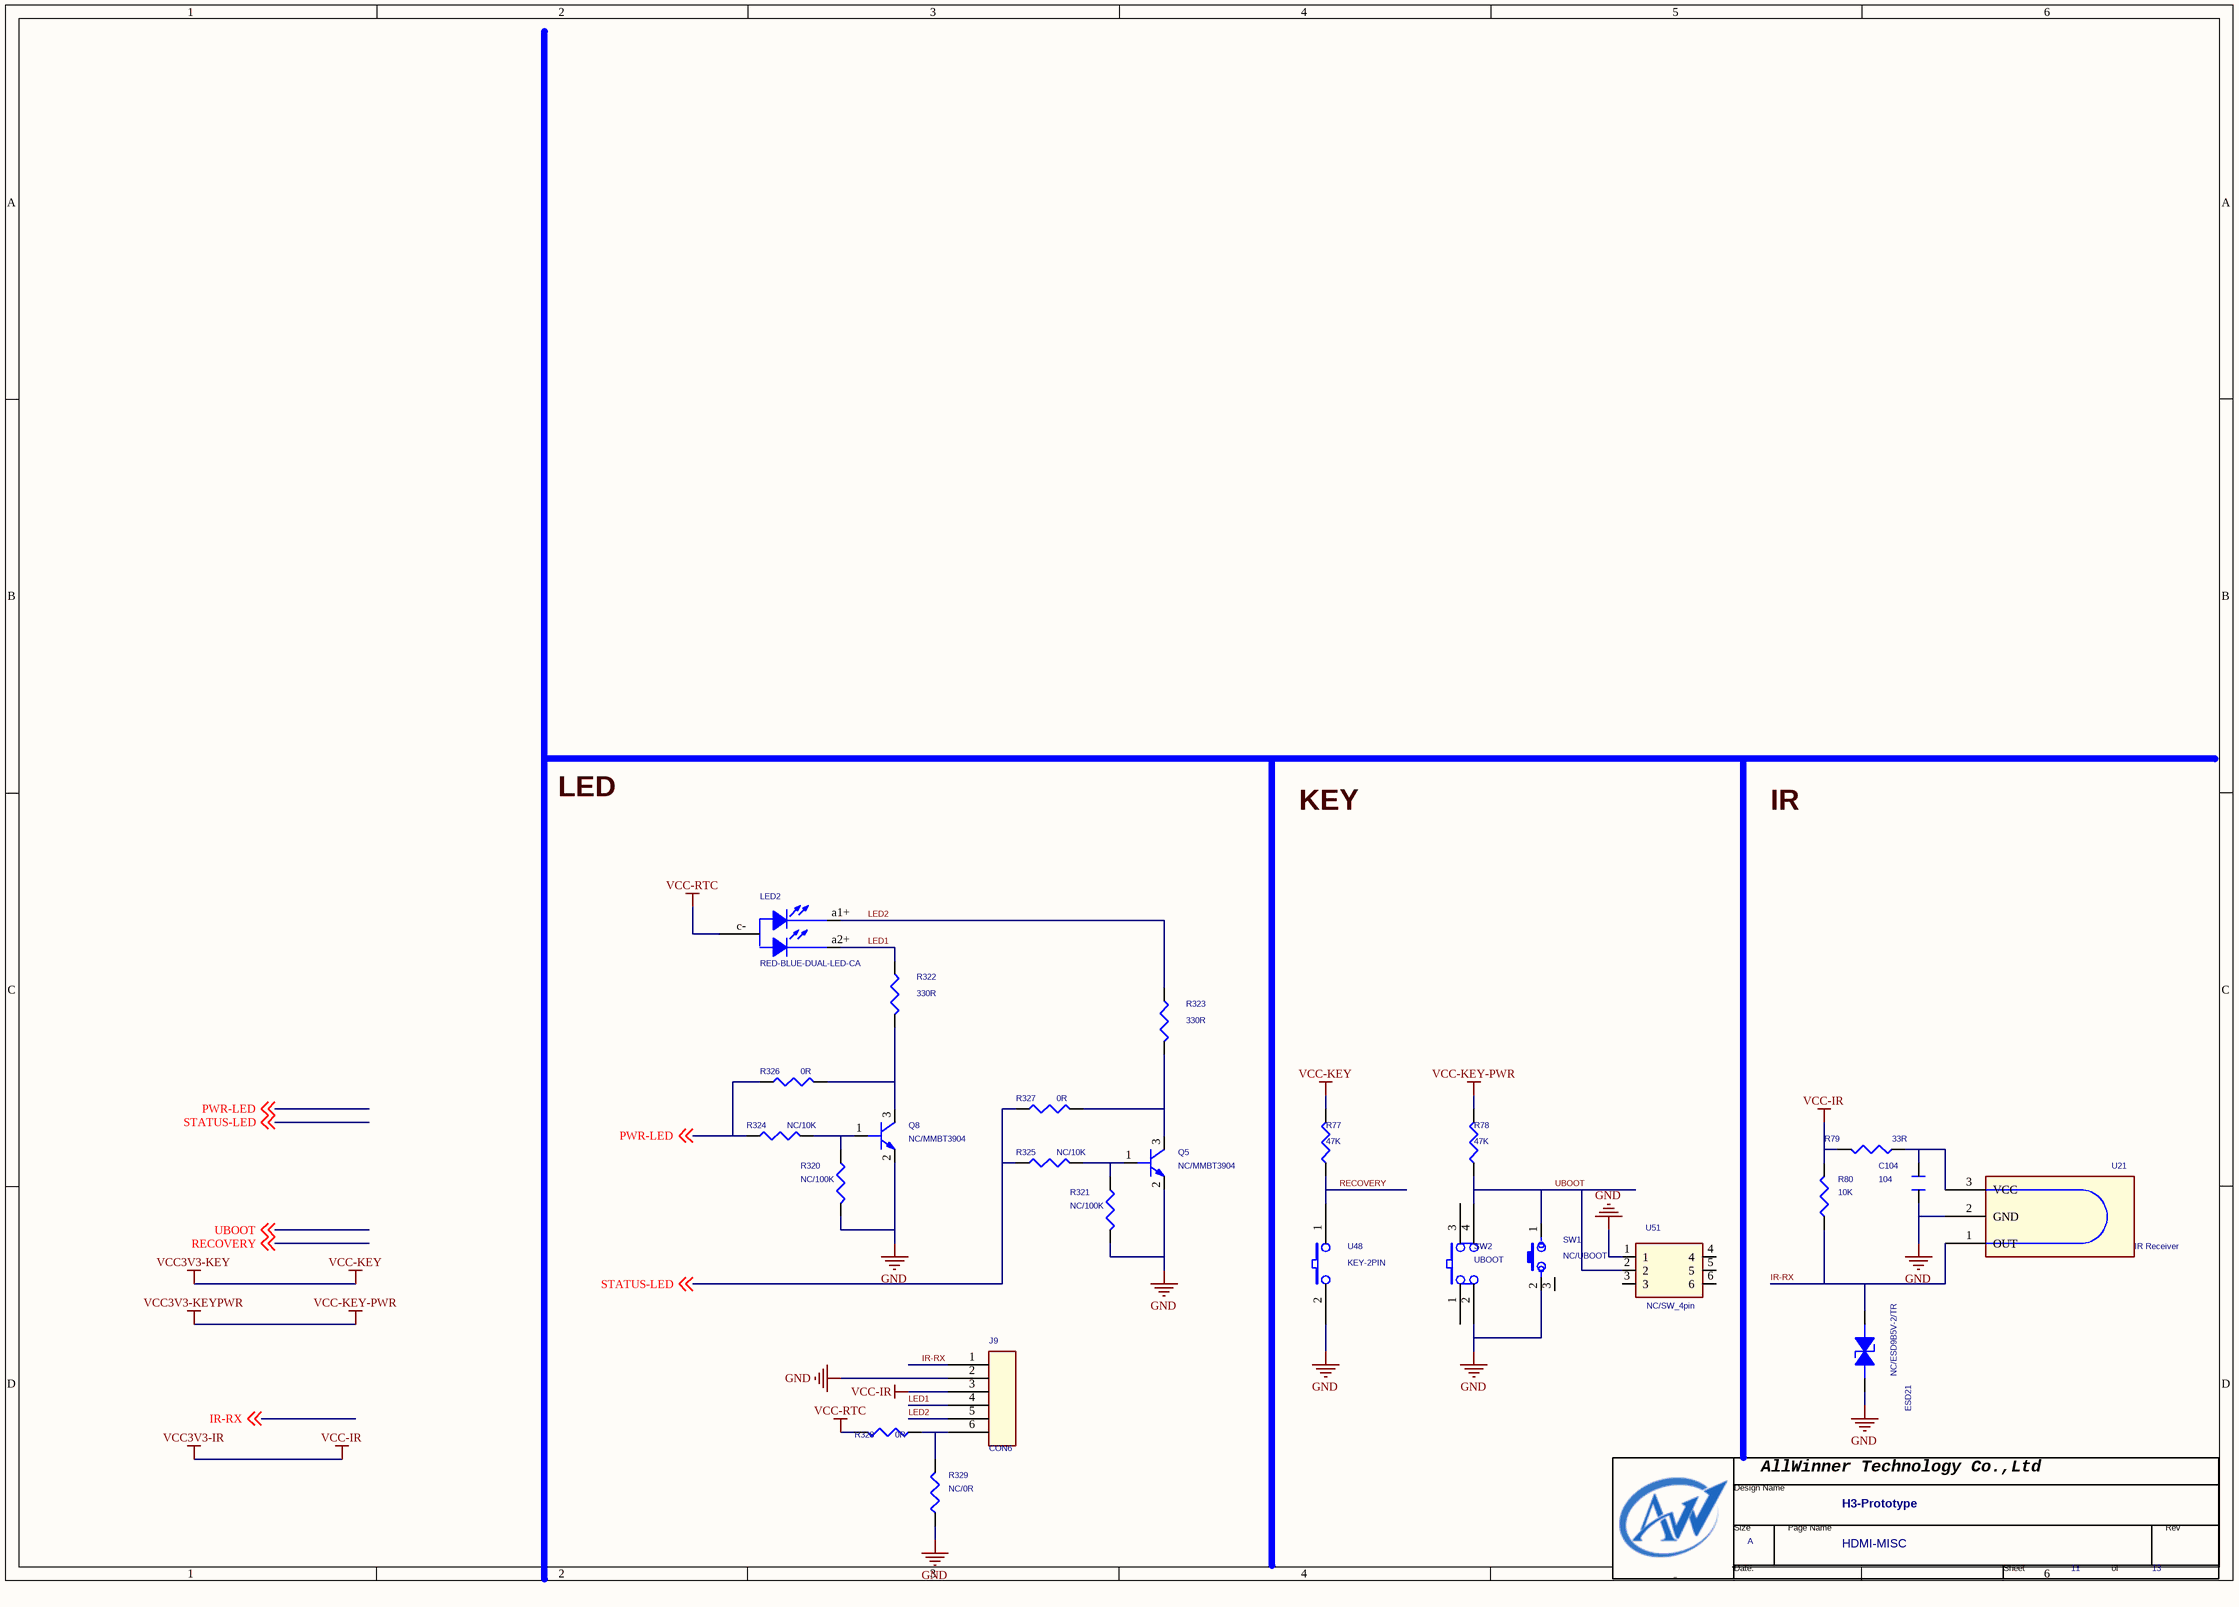
[diagram p12: 11 MISC.SchDoc]

### Parts
(Parts that share a designator on the sheet are numbered #1, #2 ... from top to bottom, then left to right.)
*#11  Page Count: 13  Page Number: 11  Page Size: A  Title: H3-Prototype  Doc: HDMI-MISC  (hidden comment: TitleBlock0-AW)  (graphical)
C104  104  [C0402]
ESD21  NC/ESD9B5V-2/TR  [tvs0402]
J9  CON6  [HDR6P2_00]
LED2  RED-BLUE-DUAL-LED-CA  [led3p2_4b8_1x12_1]
Q5  NC/MMBT3904  [SOT-23]
Q8  NC/MMBT3904  [SOT-23]
R77  47K  [0805]
R78  47K  [0805]
R79  33R  [R0402]
R80  10K  [R0402]
R320  NC/100K  [R0402]
R321  NC/100K  [R0402]
R322  330R  [R0402]
R323  330R  [R0402]
R324  NC/10K  [R0402]
R325  NC/10K  [R0402]
R326  0R  [R0402]
R327  0R  [R0402]
R328  0R  [R0402]
R329  NC/0R  [R0402]
SW1  NC/UBOOT  [KEY0.3]
SW2  UBOOT  [SW4]
U21  IR_MODULE  [IR3P2_50B7_00X3_50]  (value not drawn)
U48  KEY-2PIN  [SW3X4_2P]
U51  NC/SW_4pin  [KEY6P3_40]

### Nets
GND: C104.1 ESD21.2(CATHODE) J9.2 Q5.2(E) Q8.2(E) R320.2 R321.2 R329.1 SW1.2 SW2.2 U21.2(GND) U48.2 U51.1
VCC-IR: J9.3 LED2.c- R78.2 R79.2 R80.2 R328.2  [also labelled VCC-KEY-PWR, VCC-RTC, VCC3V3-IR, VCC3V3-KEYPWR]
VCC-KEY: R77.2  [also labelled VCC3V3-KEY]  [project net HDMI-3V]
IR-RX: ESD21.1(ANODE) J9.1 R80.1 U21.1(OUT) ; off-sheet IR-RX
LED1: J9.4 LED2.a2+ R322.1
LED2: J9.5 LED2.a1+ R323.1
PWR-LED: R324.1 R326.1 ; off-sheet PWR-LED
RECOVERY: R77.1 U48.1 ; off-sheet RECOVERY
STATUS-LED: R325.1 R327.1 ; off-sheet STATUS-LED
UBOOT: R78.1 SW1.1 SW2.4 U51.2 ; off-sheet UBOOT
NetC104_2: C104.2 R79.1 U21.3(VCC)
NetJ9_6: J9.6 R328.1 R329.2
NetQ5_1: Q5.1(B) R321.1 R325.2
NetQ5_3: Q5.3(C) R323.2 R327.2
NetQ8_1: Q8.1(B) R320.1 R324.2
NetQ8_3: Q8.3(C) R322.2 R326.2

Not connected (* = marked no-connect by the designer): SW1 3; SW2 1 3; U51 3 4 5 6

### Notes on the sheet
- LED
- KEY
- IR
- (in symbol IR_Module_0) IR Receiver
- (in symbol TitleBlock0-AW) AllWinner Technology Co.,Ltd; Design Name; Size; Page Name; Rev; Date:; Sheet; of

### Library data of the parts
C104 = CAPACITOR_0_Dup5
ESD21 = 1_1.5KE100A: 1ST PART DESCRIPTION: WILL ESD9B5V Bidirection ESD Protection
J9 = CON2_2
LED2 = LED_1
Q5 Q8 = NPN
R77 R78 = R1 0805_Dup2
R79 R80 R328 R329 = R_Dup3
R320-R327 = R
SW1 = SW-_0
SW2 = SW_PUSH: SDTSourceLibName: C:\WIND95\TEMP\6200.LIB
U21 = IR_Module_0
U48 = KEY-2PIN: SDTSourceLibName: C:\WIND95\TEMP\6200.LIB
U51 = SW_4pin
*#11 = TitleBlock0-AW: Page Create Date: March  8, 1995

## Sheet 12 FE-DBG.SchDoc
size 420 x 297 mm
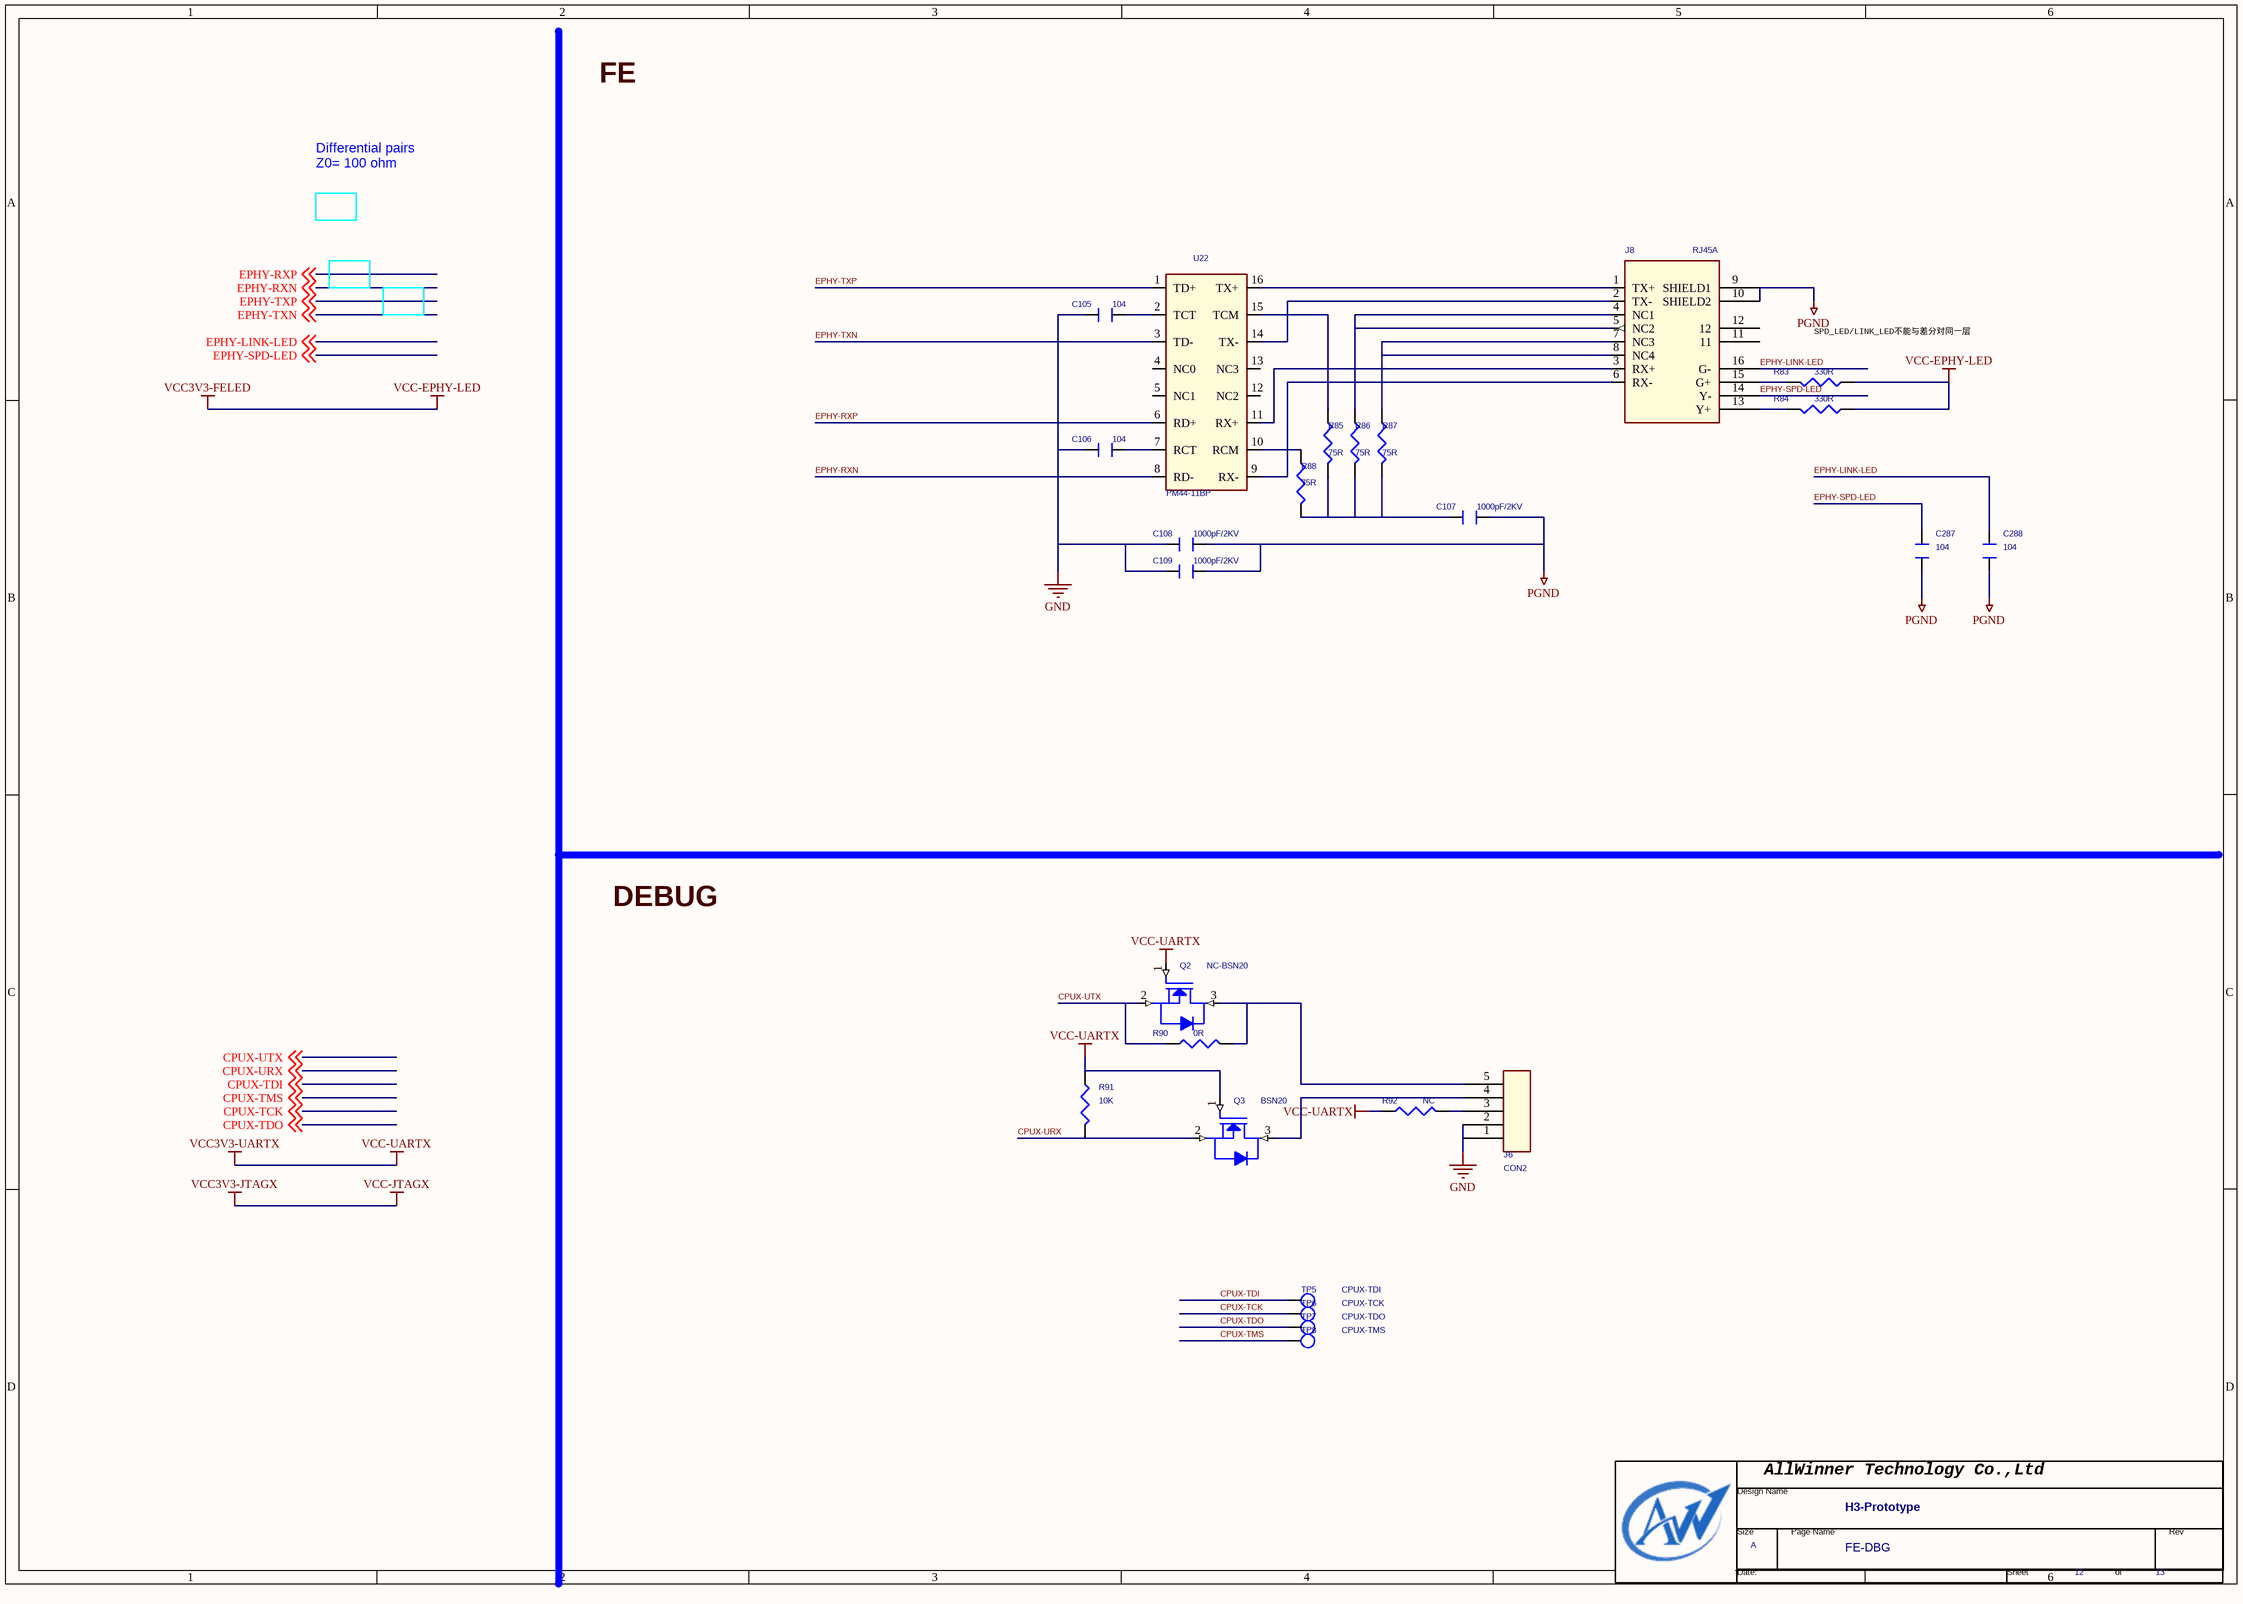
[diagram p13: 12 FE-DBG.SchDoc]

### Parts
(Parts that share a designator on the sheet are numbered #1, #2 ... from top to bottom, then left to right.)
*#12  Page Count: 13  Page Number: 12  Page Size: A  Title: H3-Prototype  Doc: FE-DBG  (hidden comment: TitleBlock0-AW)  (graphical)
C105  104  [0805]
C106  104  [0805]
C107  1000pF/2KV  [0805]
C108  1000pF/2KV  [0805]
C109  1000pF/2KV  [0805]
C287  104  [C0402]
C288  104  [C0402]
J6  CON2  [CON5]
J8  RJ45A  [LU1SO41A]
Q2  NC-BSN20  [sot-23]
Q3  BSN20  [sot-23]
R83  330R  [0805]
R84  330R  [0805]
R85  75R  [0805]
R86  75R  [0805]
R87  75R  [0805]
R88  75R  [0805]
R90  0R  [0805]
R91  10K  [0805]
R92  NC  [0805]
TP5  CPUX-TDI  [TP_SMD]
TP6  CPUX-TCK  [TP_SMD]
TP7  CPUX-TDO  [TP_SMD]
TP8  CPUX-TMS  [TP_SMD]
U22  PM44-11BP  [SOP16P1_27B6_86X12_70H6_0]

### Nets
GND: C105.2 C106.2 C108.2 C109.2 J6.1 J6.2
PGND: C107.1 C108.1 C109.1 C287.1 C288.1 J8.9(SHIELD1) J8.10(SHIELD2)
VCC-EPHY-LED: Q2.1(GATE) Q3.1(GATE) R83.1 R84.1 R91.1 R92.1  [also labelled VCC-JTAGX, VCC-UARTX, VCC3V3-FELED, VCC3V3-JTAGX, VCC3V3-UARTX]  [project net HDMI-3V]
CPUX-TCK: TP6.1(TP) ; off-sheet CPUX-TCK
CPUX-TDI: TP5.1(TP) ; off-sheet CPUX-TDI
CPUX-TDO: TP7.1(TP) ; off-sheet CPUX-TDO
CPUX-TMS: TP8.1(TP) ; off-sheet CPUX-TMS
CPUX-URX: Q3.2(SOURCE) R91.2 ; off-sheet CPUX-URX
CPUX-UTX: Q2.2(SOURCE) R90.1 ; off-sheet CPUX-UTX
EPHY-LINK-LED: C288.2 J8.16(G-) ; off-sheet EPHY-LINK-LED
EPHY-RXN: U22.8(RD-) ; off-sheet EPHY-RXN
EPHY-RXP: U22.6(RD+) ; off-sheet EPHY-RXP
EPHY-SPD-LED: C287.2 J8.14(Y-) ; off-sheet EPHY-SPD-LED
EPHY-TXN: U22.3(TD-) ; off-sheet EPHY-TXN
EPHY-TXP: U22.1(TD+) ; off-sheet EPHY-TXP
NetC105_1: C105.1 U22.2(TCT)
NetC106_1: C106.1 U22.7(RCT)
NetC107_2: C107.2 R85.2 R86.2 R87.2 R88.2
NetJ6_3: J6.3 R92.2
NetJ6_4: J6.4 Q3.3(DRAIN)
NetJ6_5: J6.5 Q2.3(DRAIN) R90.2
NetJ8_1: J8.1(TX+) U22.16(TX+)
NetJ8_2: J8.2(TX-) U22.14(TX-)
NetJ8_3: J8.3(RX+) U22.11(RX+)
NetJ8_4: J8.4(NC1) J8.5(NC2) R86.1
NetJ8_6: J8.6(RX-) U22.9(RX-)
NetJ8_7: J8.7(NC3) J8.8(NC4) R87.1
NetJ8_13: J8.13(Y+) R84.2
NetJ8_15: J8.15(G+) R83.2
NetR85_1: R85.1 U22.15(TCM)
NetR88_1: R88.1 U22.10(RCM)

Not connected (* = marked no-connect by the designer): J8 11 12; U22 4(NC0) 5(NC1) 12(NC2) 13(NC3)

### Notes on the sheet
- FE
- Differential pairs
  Z0= 100 ohm
- (near R83) SPD_LED/LINK_LED不能与差分对同一层
- DEBUG
- (in symbol TitleBlock0-AW) AllWinner Technology Co.,Ltd; Design Name; Size; Page Name; Rev; Date:; Sheet; of

### Library data of the parts
C105-C109 = CAP_1
C287 C288 = CAPACITOR_0_Dup1: PAGE: 6
J6 = CON2_2_Dup1
J8 = LU1S041A_0: Single RJ45 Connector Module with Integrated 10/100 Base-Tx magnetics; MANUFACTURER#: LU1S041A-43; Manufacturer: Bothhand; Part Number: LU1S041A-43
Q2 Q3 = NMOS_0_Dup1
R83-R88 = R1_0805_Dup2
R90-R92 = R1_0805_Dup1: ROOM: DRAM
TP5-TP8 = T_POINT_R
U22 = J_0
*#12 = TitleBlock0-AW: Page Create Date: March  8, 1995

## Sheet 13 HDMI.SchDoc
size 420 x 297 mm
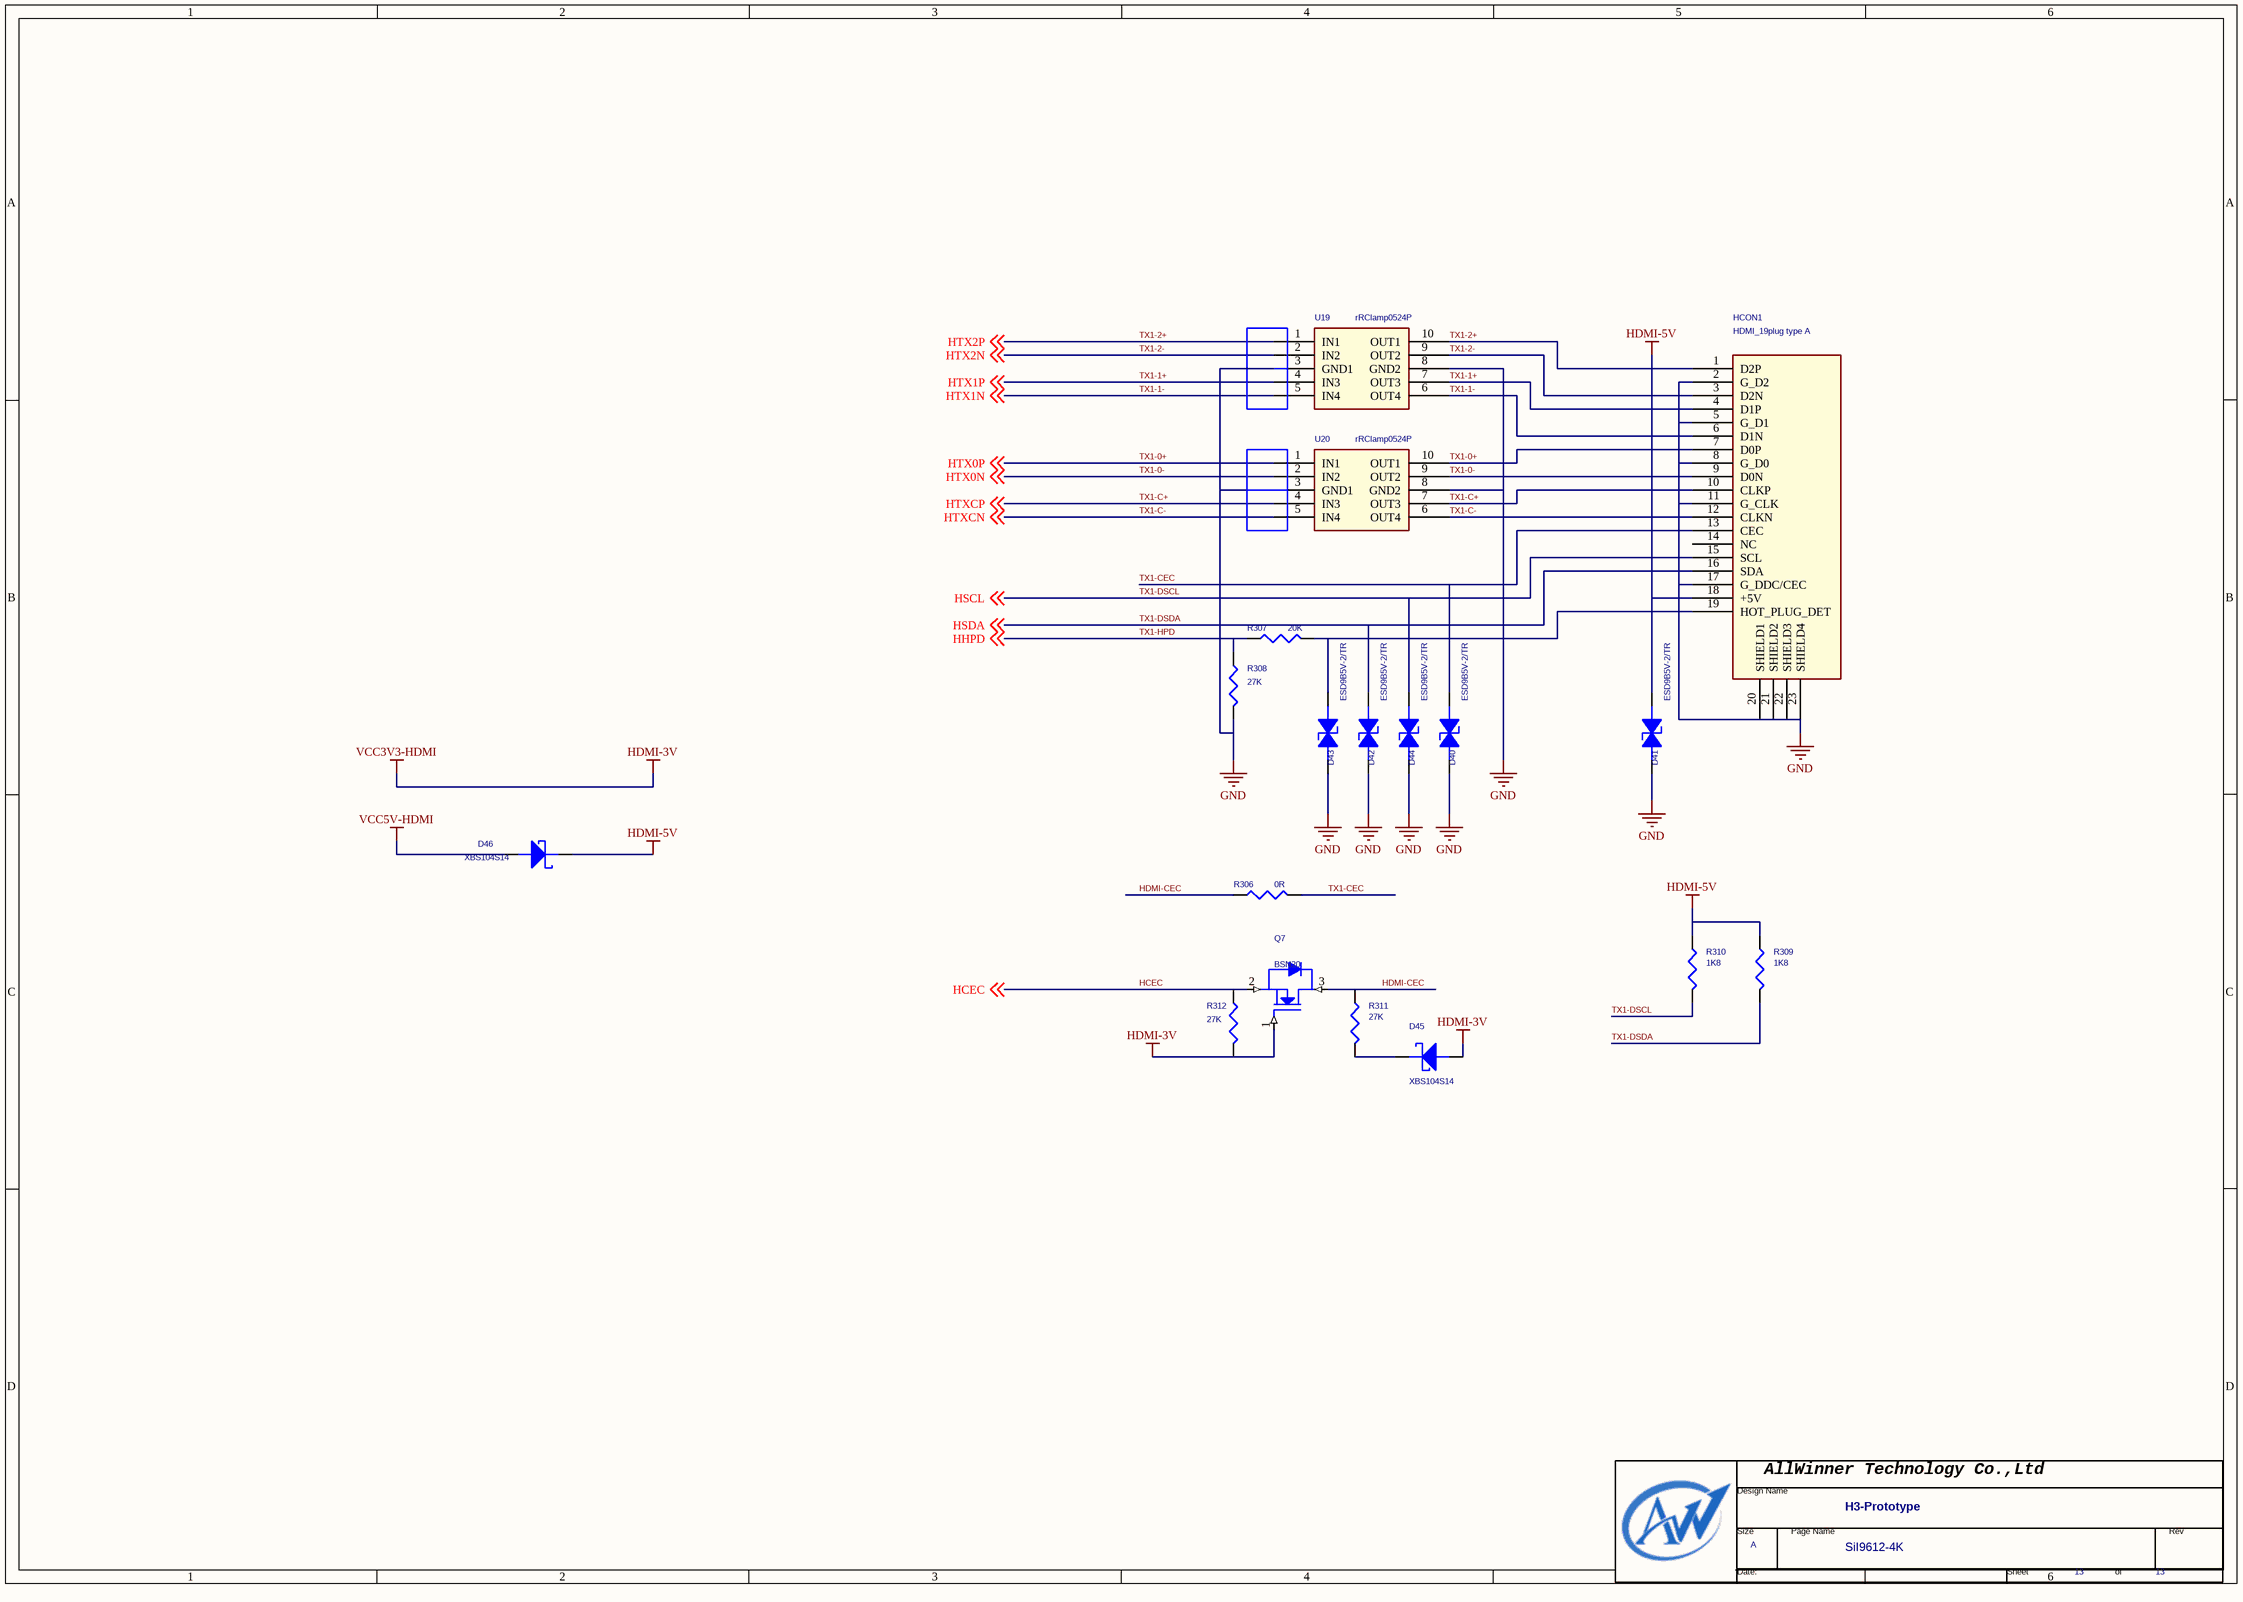
[diagram p14: 13 HDMI.SchDoc]

### Parts
(Parts that share a designator on the sheet are numbered #1, #2 ... from top to bottom, then left to right.)
*#13  Page Count: 13  Page Size: A  Title: H3-Prototype  Doc: SiI9612-4K  (hidden comment: TitleBlock0-AW)  (graphical)
D40  ESD9B5V-2/TR  [C0402]
D41  ESD9B5V-2/TR  [C0402]
D42  ESD9B5V-2/TR  [C0402]
D43  ESD9B5V-2/TR  [C0402]
D44  ESD9B5V-2/TR  [C0402]
D45  XBS104S14  [SOD123]
D46  XBS104S14  [SOD123]
HCON1  HDMI_19plug type A  [HDMI]
Q7  BSN20  [sot-23]
R306  0R  [R0402]
R307  20K  [R0402]
R308  27K  [R0402]
R309  1K8  [R0402]
R310  1K8  [R0402]
R311  27K  [R0402]
R312  27K  [R0402]
U19  rRClamp0524P  [RCLAMP0524P]
U20  rRClamp0524P  [RCLAMP0524P]

### Nets
GND: D40.2(CATHODE) D41.2(CATHODE) D42.2(CATHODE) D43.2(CATHODE) D44.2(CATHODE) HCON1.2(G_D2) HCON1.5(G_D1) HCON1.8(G_D0) HCON1.11(G_CLK) HCON1.17(G_DDC/CEC) HCON1.20(SHIELD1) HCON1.21(SHIELD2) HCON1.22(SHIELD3) HCON1.23(SHIELD4) R308.2 U19.3(GND1) U19.8(GND2) U20.3(GND1) U20.8(GND2)
HDMI-3V: D45.A Q7.1(GATE) R312.2  [also labelled VCC3V3-HDMI]
HDMI-5V: D41.1(ANODE) D46.C HCON1.18(+5V) R309.2 R310.2
VCC5V-HDMI: D46.A  [project net SPDIF-5V]
HCEC: Q7.2(SOURCE) R312.1 ; off-sheet HCEC
HDMI-CEC: Q7.3(DRAIN) R306.2 R311.2
TX1-0+: HCON1.7(D0P) U20.1(IN1) U20.10(OUT1) ; off-sheet HTX0P  [also labelled HTX0P]
TX1-0-: HCON1.9(D0N) U20.2(IN2) U20.9(OUT2) ; off-sheet HTX0N  [also labelled HTX0N]
TX1-1+: HCON1.4(D1P) U19.4(IN3) U19.7(OUT3) ; off-sheet HTX1P  [also labelled HTX1P]
TX1-1-: HCON1.6(D1N) U19.5(IN4) U19.6(OUT4) ; off-sheet HTX1N  [also labelled HTX1N]
TX1-2+: HCON1.1(D2P) U19.1(IN1) U19.10(OUT1) ; off-sheet HTX2P  [also labelled HTX2P]
TX1-2-: HCON1.3(D2N) U19.2(IN2) U19.9(OUT2) ; off-sheet HTX2N  [also labelled HTX2N]
TX1-C+: HCON1.10(CLKP) U20.4(IN3) U20.7(OUT3) ; off-sheet HTXCP  [also labelled HTXCP]
TX1-C-: HCON1.12(CLKN) U20.5(IN4) U20.6(OUT4) ; off-sheet HTXCN  [also labelled HTXCN]
TX1-CEC: D40.1(ANODE) HCON1.13(CEC) R306.1
TX1-DSCL: D44.1(ANODE) HCON1.15(SCL) R310.1 ; off-sheet HSCL  [also labelled HSCL]
TX1-DSDA: D42.1(ANODE) HCON1.16(SDA) R309.1 ; off-sheet HSDA  [also labelled HSDA]
TX1-HPD: R307.1 R308.1 ; off-sheet HHPD  [also labelled HHPD]
NetD43_1: D43.1(ANODE) HCON1.19(HOT_PLUG_DET) R307.2
NetD45_C: D45.C R311.1

Not connected (* = marked no-connect by the designer): HCON1 14(NC)

### Notes on the sheet
- (in symbol TitleBlock0-AW) AllWinner Technology Co.,Ltd; Design Name; Size; Page Name; Rev; Date:; Sheet; of

### Library data of the parts
D40-D44 = 1_1.5KE100A_Dup1: as D47 on sheet 06 CPU
D45 = DIODE_SCHOTTKY_1
D46 = DIODE_SCHOTTKY_2
HCON1 = HDMI19_PLUG
Q7 = NMOS_0
R306 R309-R312 = RESISTOR
R307 = R_Dup1
R308 = RESISTOR_Dup2
*#13 = TitleBlock0-AW: Page Number: 13; Page Create Date: March  8, 1995